# EAGLE design Tractive System Board Rev7 (EAGLE 9.6.2)

## Sheet 1 of 3
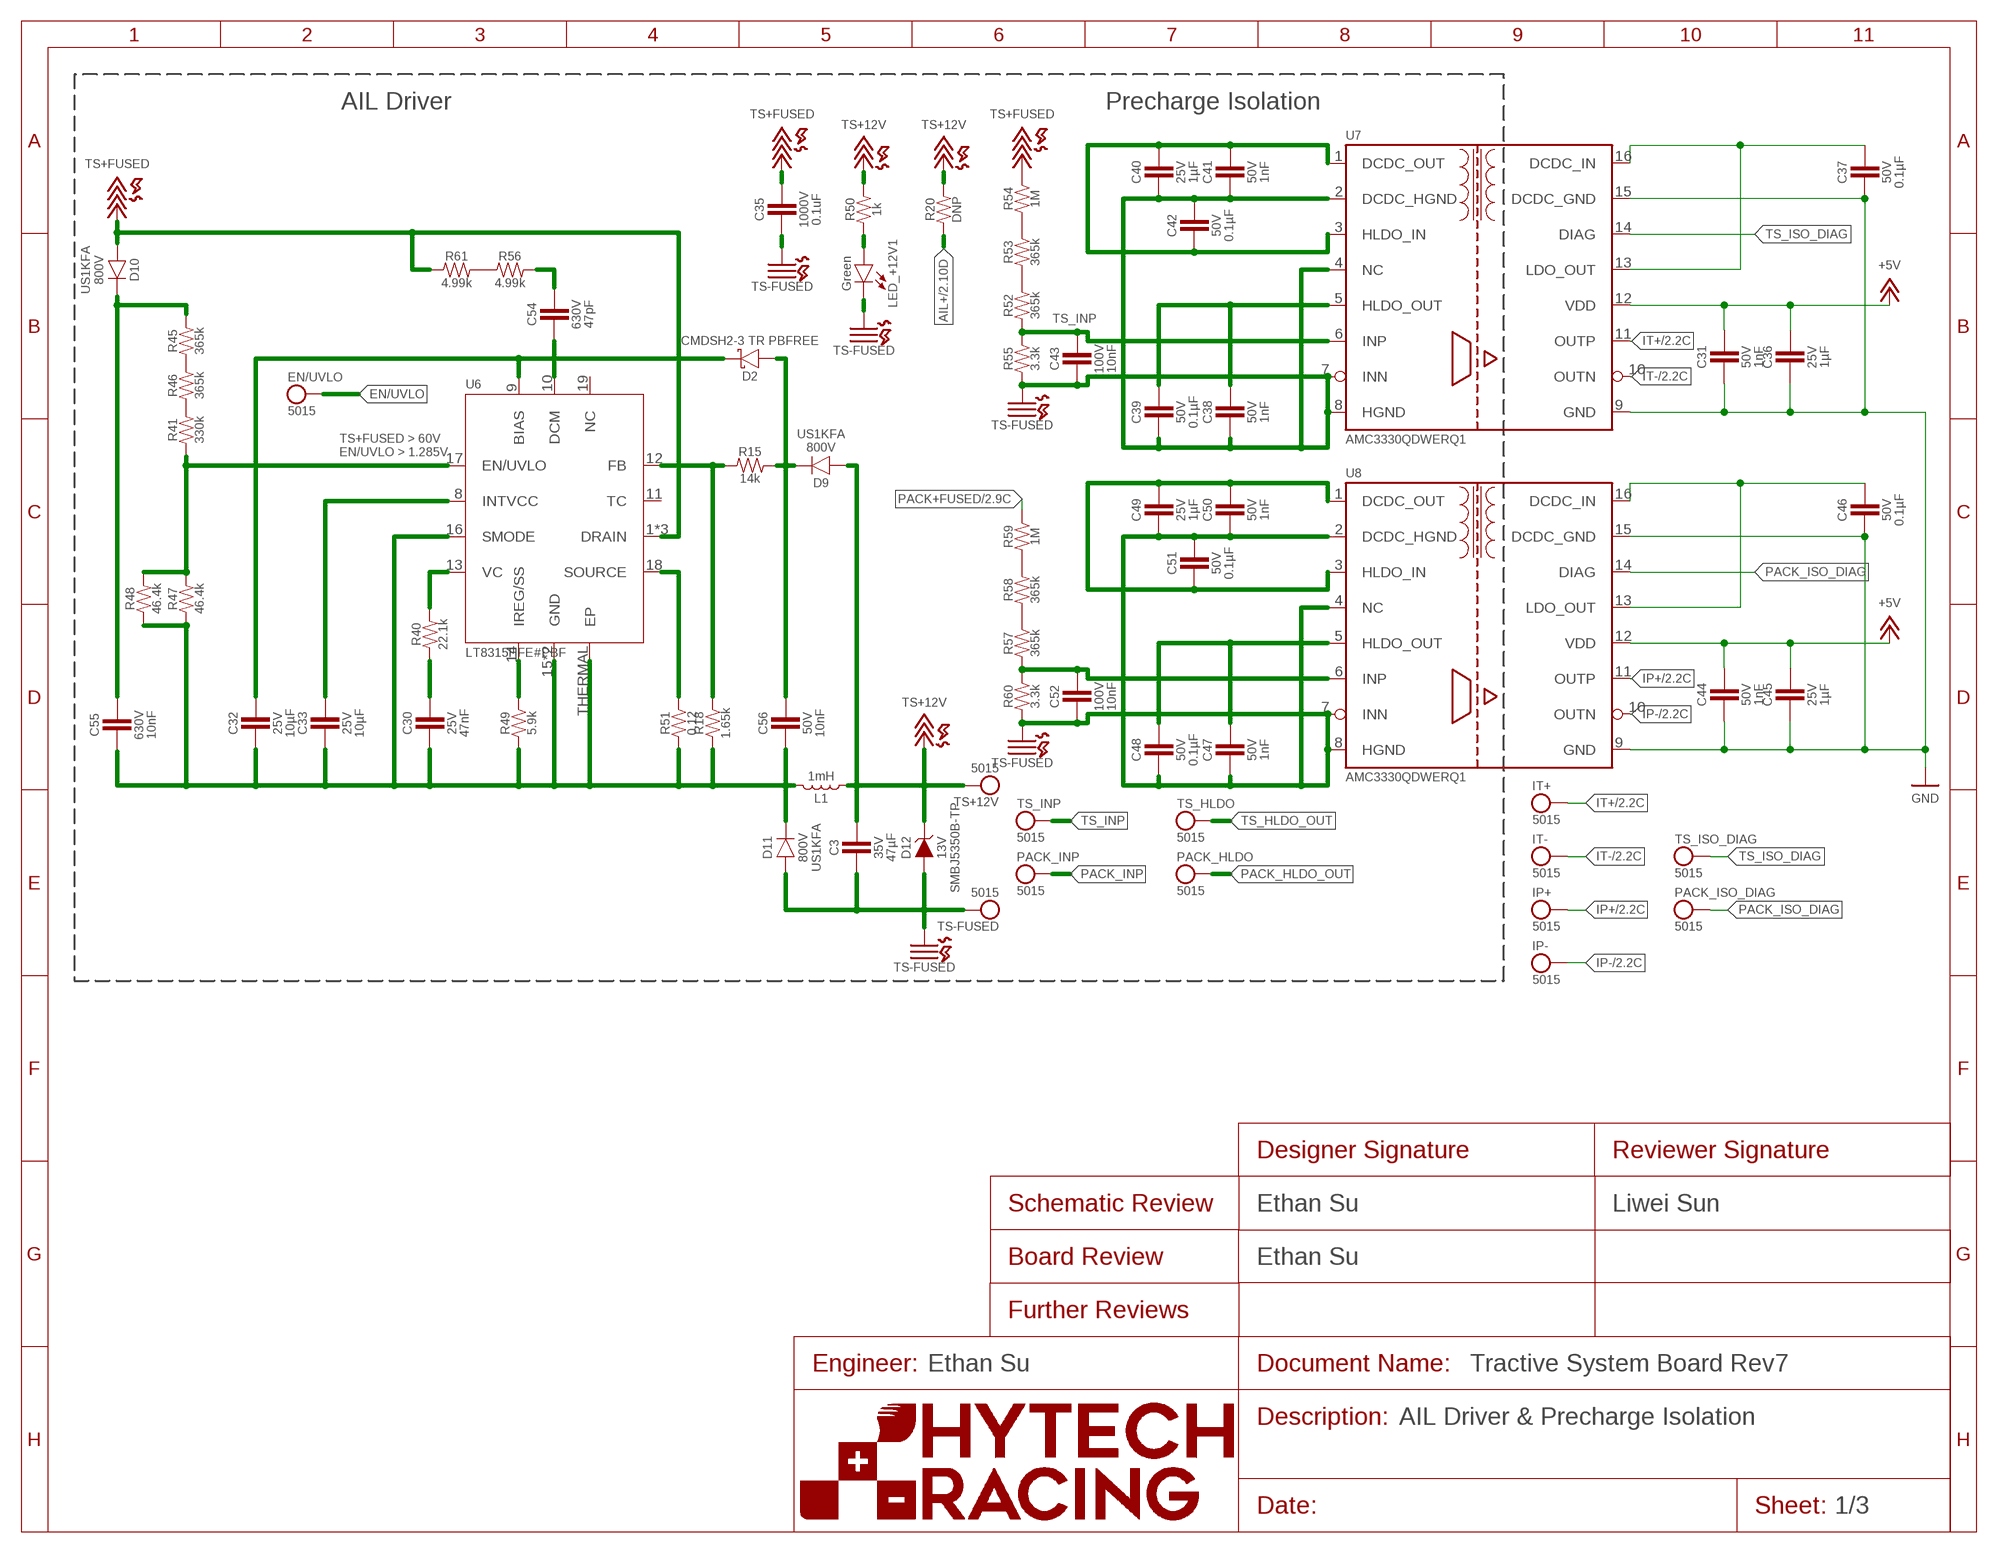
[diagram p0: schematic, sheet 1]
FRAME1 (FRAME): DESCRIPTION_1: AIL Driver & Precharge Isolation; DESIGNER_BOARD: Ethan Su; DESIGNER_SCHEMATIC: Ethan Su; ENGINEER: Ethan Su; REVIEWER_SCHEMATIC: Liwei Sun

### Parts
C3  CAPACITOR_2220_35V_47UF  [2220-CAP]
C30  CAPACITOR_0603_25V_47NF  [0603-CAP]
C31  CAPACITOR_1206_50V_1NF  [1206-CAP]
C32  CAPACITOR_0603_25V_10UF  [0603-CAP]
C33  CAPACITOR_0603_25V_10UF  [0603-CAP]
C35  CAPACITOR_1812_1000V_0.1UF  [1812-CAP]
C36  CAPACITOR_1206_25V_1UF  [1206-CAP]
C37  CAPACITOR_0603_50V_0.1UF  [0603-CAP]
C38  CAPACITOR_1206_50V_1NF  [1206-CAP]
C39  CAPACITOR_1206_50V_0.1UF  [1206-CAP]
C40  CAPACITOR_0603_25V_1UF  [0603-CAP]
C41  CAPACITOR_0603_50V_1NF  [0603-CAP]
C42  CAPACITOR_0603_50V_0.1UF  [0603-CAP]
C43  CAPACITOR_0603_100V_10NF  [0603-CAP]
C44  CAPACITOR_1206_50V_1NF  [1206-CAP]
C45  CAPACITOR_1206_25V_1UF  [1206-CAP]
C46  CAPACITOR_0603_50V_0.1UF  [0603-CAP]
C47  CAPACITOR_1206_50V_1NF  [1206-CAP]
C48  CAPACITOR_1206_50V_0.1UF  [1206-CAP]
C49  CAPACITOR_0603_25V_1UF  [0603-CAP]
C50  CAPACITOR_0603_50V_1NF  [0603-CAP]
C51  CAPACITOR_0603_50V_0.1UF  [0603-CAP]
C52  CAPACITOR_0603_100V_10NF  [0603-CAP]
C54  CAPACITOR_1206_630V_47PF  [1206-CAP]
C55  CAPACITOR_1206_630V_10NF  [1206-CAP]
C56  CAPACITOR_0603_50V_10NF  [0603-CAP]
D2  SCHOTTKY_SOD323_30VV  [SOD-323]
D9  RECTIFIER_800V_SOD-123FA  [SOD-123FA]
D10  RECTIFIER_800V_SOD-123FA  [SOD-123FA]
D11  RECTIFIER_800V_SOD-123FA  [SOD-123FA]
D12  ZENER_SMB(DO-214AA)_13V  [SMB(DO-214AA)]
EN/UVLO  TEST_POINT  [5015]
IP+  TEST_POINT  [5015]
IP-  TEST_POINT  [5015]
IT+  TEST_POINT  [5015]
IT-  TEST_POINT  [5015]
L1  INDUCTOR_SRR0745A_1MH  [SRR0745A-102M]
LED_+12V1  LED_0603_GREEN  [0603-LED]
PACK_HLDO  TEST_POINT  [5015]
PACK_INP  TEST_POINT  [5015]
PACK_ISO_DIAG  TEST_POINT  [5015]
R15  RESISTOR_0603_14K  [0603-RES]
R18  RESISTOR_0603_1.65K  [0603-RES]
R20  RESISTOR_0603_DNP  [0603-RES]
R40  RESISTOR_0603_22.1K  [0603-RES]
R41  RESISTOR_0805_HV330K  [0805-RES]
R45  RESISTOR_0805_HV365K  [0805-RES]
R46  RESISTOR_0805_HV365K  [0805-RES]
R47  RESISTOR_1206_HV46.4K  [1206-RES]
R48  RESISTOR_1206_HV46.4K  [1206-RES]
R49  RESISTOR_0603_5.9K  [0603-RES]
R50  RESISTOR_0603_1K  [0603-RES]
R51  RESISTOR_0603_0.12  [0603-RES]
R52  RESISTOR_0805_HV365K  [0805-RES]
R53  RESISTOR_0805_HV365K  [0805-RES]
R54  RESISTOR_0805_HV1M  [0805-RES]
R55  RESISTOR_0603_HV3.3K  [0603-RES]
R56  RESISTOR_1206_HV4.99K  [1206-RES]
R57  RESISTOR_0805_HV365K  [0805-RES]
R58  RESISTOR_0805_HV365K  [0805-RES]
R59  RESISTOR_0805_HV1M  [0805-RES]
R60  RESISTOR_0603_HV3.3K  [0603-RES]
R61  RESISTOR_1206_HV4.99K  [1206-RES]
TS+12V  TEST_POINT  [5015]
TS-FUSED  TEST_POINT  [5015]
TS_HLDO  TEST_POINT  [5015]
TS_INP  TEST_POINT  [5015]
TS_ISO_DIAG  TEST_POINT  [5015]
U6  LT8315  [TSSOP-20(16)]
U7  AMC3330_AIRGAP  [SOIC-16W-AIRGAP]
U8  AMC3330_AIRGAP  [SOIC-16W-AIRGAP]

### Nets
+5V: C31.1 C36.1 C44.1 C45.1 U7.12(VDD) U8.12(VDD) ; also sheet 2
AIL+: R20.1 ; also sheet 2
EN/UVLO: EN/UVLO.1 R41.1 R47.2 R48.2 U6.17(EN/UVLO)
GND: C31.2 C36.2 C37.2 C44.2 C45.2 C46.2 U7.9(GND) U7.15(DCDC_GND) U8.9(GND) U8.15(DCDC_GND) ; also sheet 2
IP+: IP+.1 U8.11(OUTP) ; also sheet 2
IP-: IP-.1 U8.10(OUTN) ; also sheet 2
IT+: IT+.1 U7.11(OUTP) ; also sheet 2
IT-: IT-.1 U7.10(OUTN) ; also sheet 2
N$33: C37.1 U7.13(LDO_OUT) U7.16(DCDC_IN)
N$34: R56.1 R61.2
N$35: C54.1 R56.2
N$36: R49.2 U6.14(IREG/SS)
N$37: R47.1 R48.1
N$38: C54.2 U6.10(DCM)
N$41: R40.2 U6.13(VC)
N$43: C30.1 R40.1
N$44: LED_+12V1.2(A) R50.1
N$45: C33.1 U6.8(INTVCC)
N$46: D10.C R45.2
N$47: R51.2 U6.18(SOURCE)
N$49: C32.1 D2.C U6.9(BIAS)
N$51: C40.1 C41.1 C42.2 U7.1(DCDC_OUT) U7.3(HLDO_IN)
N$52: C46.1 U8.13(LDO_OUT) U8.16(DCDC_IN)
N$54: R15.1 R18.2 U6.12(FB)
N$55: C56.1 D2.A D9.C R15.2
N$59: R52.2 R53.1
N$60: R53.2 R54.1
N$64: C49.1 C50.1 C51.2 U8.1(DCDC_OUT) U8.3(HLDO_IN)
N$65: R57.2 R58.1
N$66: R58.2 R59.1
PACK+FUSED: R59.2 ; also sheet 2
PACK_HLDO_OUT: C47.1 C48.1 PACK_HLDO.1 U8.5(HLDO_OUT)
PACK_INP: C52.1 PACK_INP.1 R57.1 R60.2 U8.6(INP)
PACK_ISO_DIAG: PACK_ISO_DIAG.1 U8.14(DIAG)
TS+12V: C3.1 D9.A D12.C L1.1 R20.2 R50.2 TS+12V.1
TS+FUSED: C35.1 D10.A R54.2 R61.1 U6.1(DRAIN) U6.2(DRAIN) U6.3(DRAIN) ; also sheet 2
TS-FUSED: C3.2 C35.2 C38.2 C39.2 C40.2 C41.2 C42.1 C43.2 C47.2 C48.2 C49.2 C50.2 C51.1 C52.2 D11.A D12.A LED_+12V1.1(C) R55.1 R60.1 TS-FUSED.1 U7.2(DCDC_HGND) U7.4(NC) U7.7(INN) U7.8(HGND) U8.2(DCDC_HGND) U8.4(NC) U8.7(INN) U8.8(HGND) ; also sheet 2
TS-FUSED1: C30.2 C32.2 C33.2 C55.2 C56.2 D11.C L1.2 R18.1 R49.1 R51.1 U6.15(GND) U6.16(SMODE) U6.20(GND) U6.THERMAL(EP)
TS_HLDO_OUT: C38.1 C39.1 TS_HLDO.1 U7.5(HLDO_OUT)
TS_INP: C43.1 R52.1 R55.2 TS_INP.1 U7.6(INP)
TS_ISO_DIAG: TS_ISO_DIAG.1 U7.14(DIAG)
Unconnected: C55.1 R41.2 R45.1 R46.1 R46.2 U6.11(TC) U6.19(NC)

### Notes on the sheet
- AIL Driver | Precharge Isolation
- TS+FUSED > 60V
  EN/UVLO > 1.285V

## Sheet 2 of 3
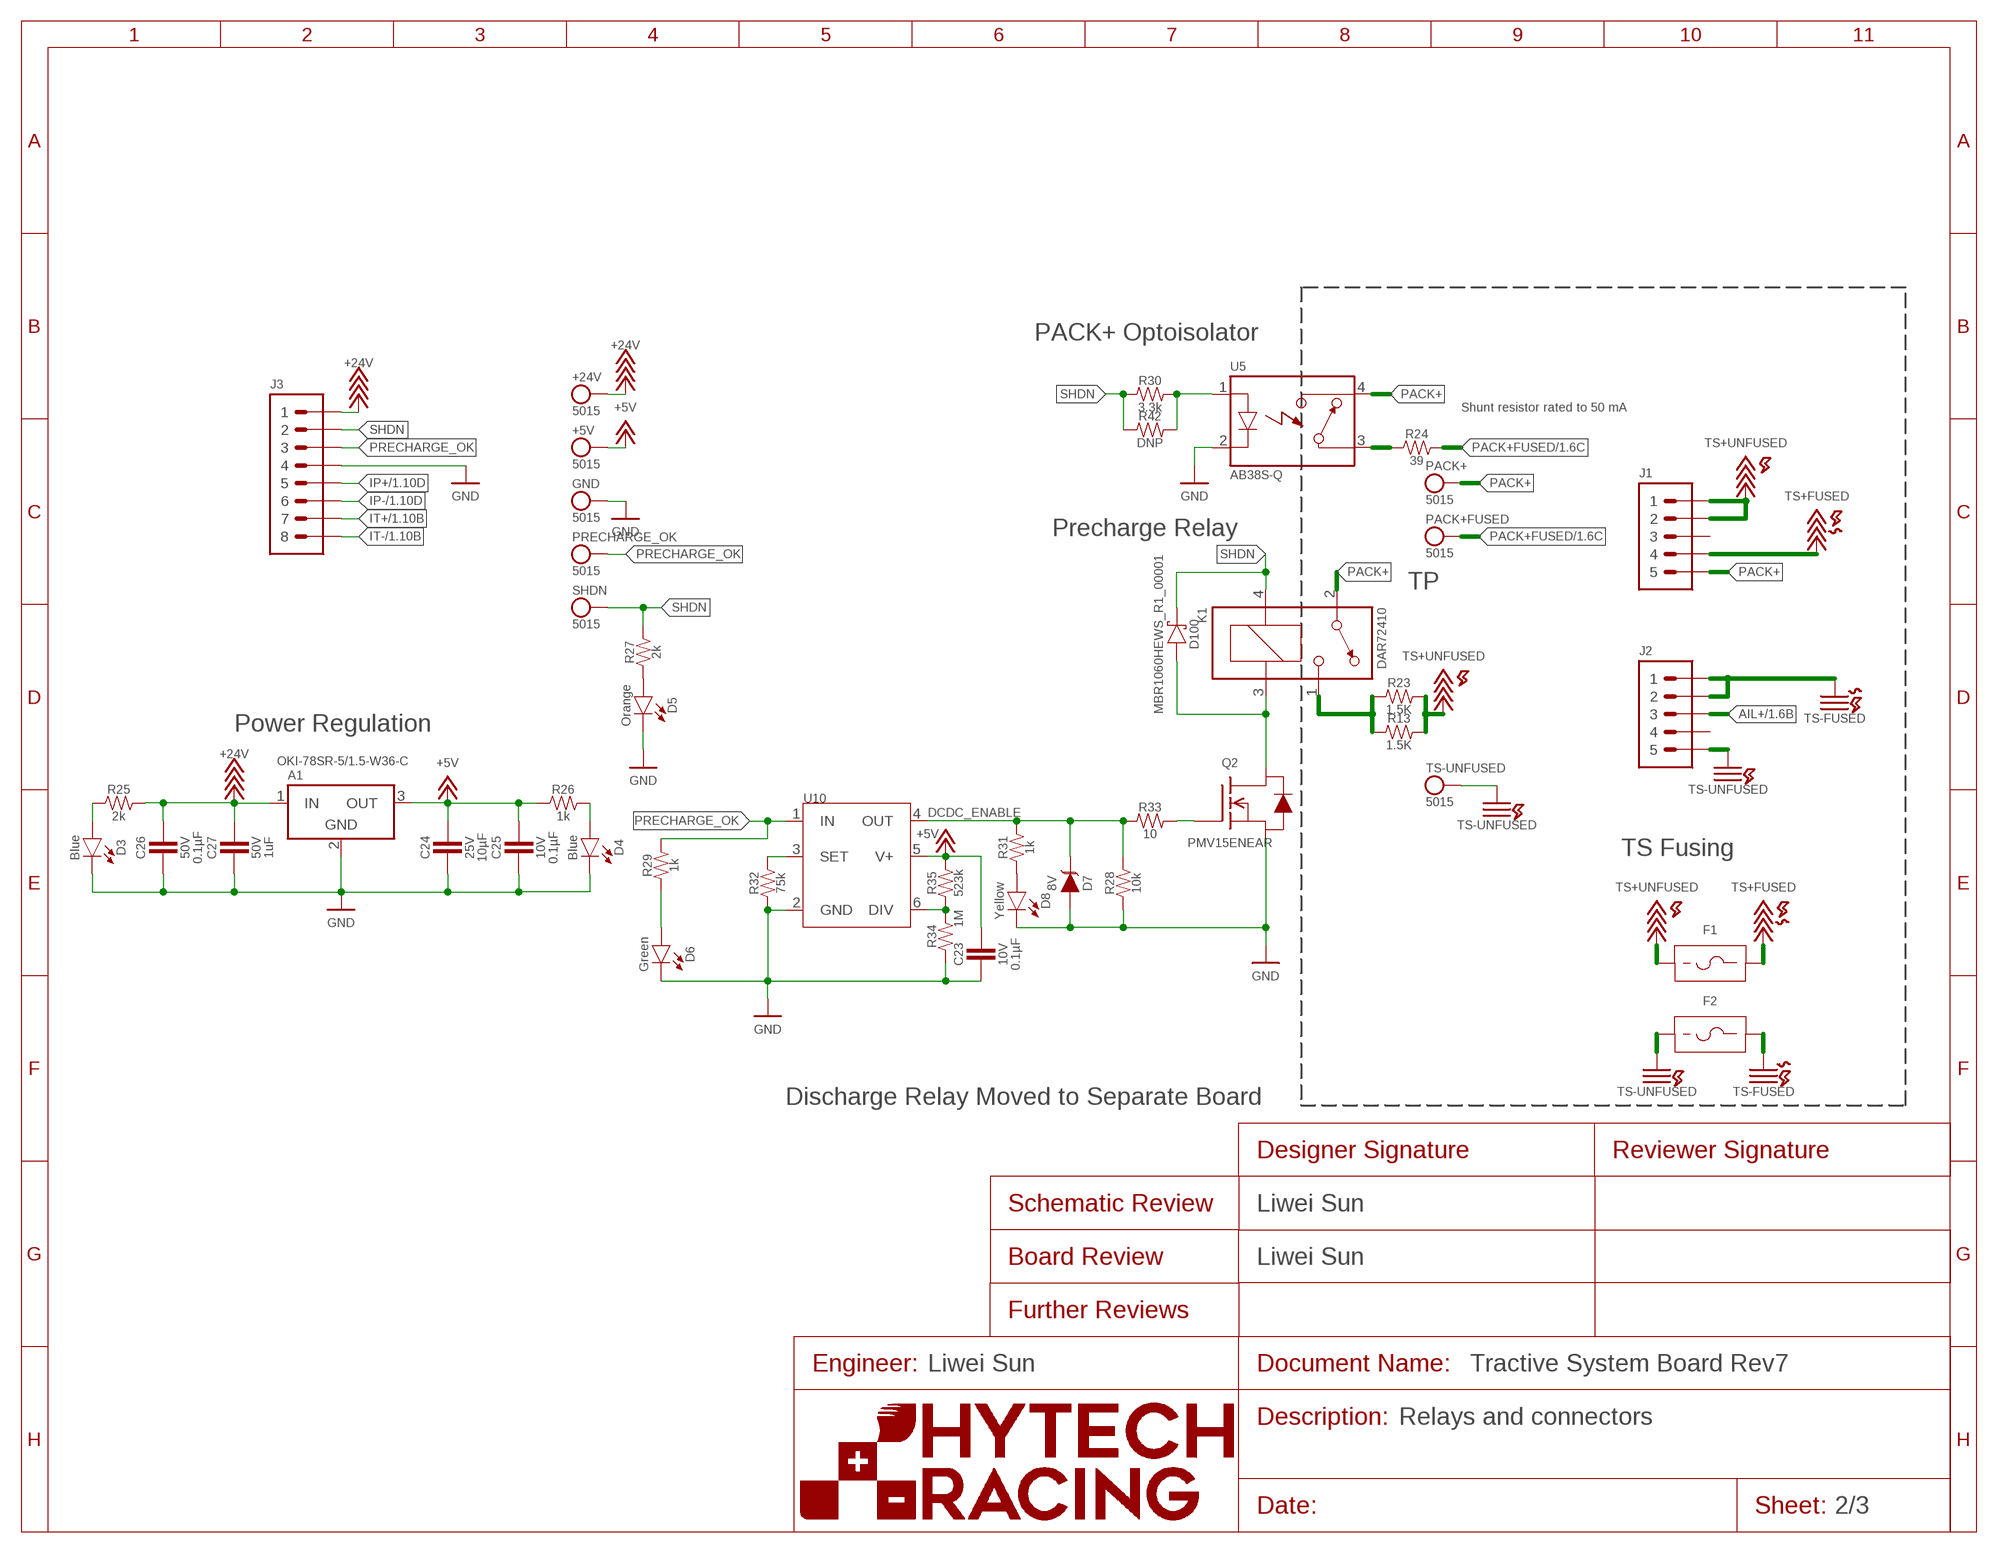
[diagram p1: schematic, sheet 2]
FRAME4 (FRAME): DESCRIPTION_1: Relays and connectors; DESIGNER_BOARD: Liwei Sun; DESIGNER_SCHEMATIC: Liwei Sun; ENGINEER: Liwei Sun

### Parts
+5V  TEST_POINT  [5015]
+24V  TEST_POINT  [5015]
A1  VOLTAGE_REGULATOR_MODULE_OKI-78SR_5V  [OKI-78SR]
C23  CAPACITOR_0603_10V_0.1UF  [0603-CAP]
C24  CAPACITOR_0603_25V_10UF  [0603-CAP]
C25  CAPACITOR_0603_10V_0.1UF  [0603-CAP]
C26  CAPACITOR_0603_50V_0.1UF  [0603-CAP]
C27  CAPACITOR_0603_50V_1UF  [0603-CAP]
D3  LED_0603_BLUE  [0603-LED]
D4  LED_0603_BLUE  [0603-LED]
D5  LED_0603_ORANGE  [0603-LED]
D6  LED_0603_GREEN  [0603-LED]
D7  TVS__8V  [SOT-23]
D8  LED_0603_YELLOW  [0603-LED]
D100  SCHOTTKY_SOD323_60V  [SOD-323]
F1  FUSE_HOLDER_122  [122]
F2  FUSE_HOLDER_122  [122]
GND  TEST_POINT  [5015]
J1  CONNECTOR-5_MICRO_V7S_  [MOLEX_MICROFIT_PTH_VERTICAL_07_SINGLE_SPACED]
J2  CONNECTOR-5_MICRO_V6S_  [MOLEX_MICROFIT_PTH_VERTICAL_06_SINGLE_SPACED]
J3  CONNECTOR-8_μF_T_V_BLACK  [MOLEX_MICROFIT_PTH_VERTICAL_08_DUAL]
K1  RELAY_SPST_NO_D_24  [D]
PACK+  TEST_POINT  [5015]
PACK+FUSED  TEST_POINT  [5015]
PRECHARGE_OK  TEST_POINT  [5015]
Q2  TRANSISTOR_N_MOS__PMV15ENEA  [SOT-23]
R13  RESISTOR_B20-SHORTENED_1.5K  [B20-SHORTENED]
R23  RESISTOR_B20-SHORTENED_1.5K  [B20-SHORTENED]
R24  RESISTOR_0603_39  [0603-RES]
R25  RESISTOR_0603_2K  [0603-RES]
R26  RESISTOR_0603_1K  [0603-RES]
R27  RESISTOR_0603_2K  [0603-RES]
R28  RESISTOR_0603_10K  [0603-RES]
R29  RESISTOR_0603_1K  [0603-RES]
R30  RESISTOR_0603_3.3K  [0603-RES]
R31  RESISTOR_0603_1K  [0603-RES]
R32  RESISTOR_0603_75K  [0603-RES]
R33  RESISTOR_0603_10  [0603-RES]
R34  RESISTOR_0805_1M  [0805-RES]
R35  RESISTOR_0805_523K  [0805-RES]
R42  RESISTOR_0603_DNP  [0603-RES]
SHDN  TEST_POINT  [5015]
TS-UNFUSED  TEST_POINT  [5015]
U5  RELAY_SOLIDSTATE_NO_AB38S-Q-AIRGAP  [SOP-04-AIRGAP]
U10  LTC6994-2  [SOT-23-6]

### Nets
+5V: +5V.1 A1.3(OUT) C23.1 C24.1 C25.1 R26.1 R35.2 U10.5(V+) ; also sheet 1
+24V: +24V.1 A1.1(IN) C26.1 C27.1 J3.1 R25.2
AIL+: J2.3 ; also sheet 1
DCDC_ENABLE: D7.3(C) R28.2 R31.2 R33.1 U10.4(OUT)
GND: A1.2(GND) C23.2 C24.2 C25.2 C26.2 C27.2 D3.1(C) D4.1(C) D5.1(C) D6.1(C) D7.1(A) D8.1(C) GND.1 J3.4 Q2.2(S) R28.1 R32.1 R34.1 U5.2(CONTROL-) U10.2(GND) ; also sheet 1
IP+: J3.5 ; also sheet 1
IP-: J3.6 ; also sheet 1
IT+: J3.7 ; also sheet 1
IT-: J3.8 ; also sheet 1
N$2: D5.2(A) R27.1
N$3: Q2.1(G) R33.2
N$10: R32.2 U10.3(SET)
N$11: R34.2 R35.1 U10.6(DIV)
N$22: D6.2(A) R29.1
N$24: D8.2(A) R31.1
N$25: D3.2(A) R25.1
N$30: D4.2(A) R26.2
N$40: D100.A K1.3(COIL-) Q2.3(D)
N$50: K1.1(CONTACT2) R13.1 R23.1
N$53: R30.2 R42.2 U5.1(CONTROL+)
N$57: R24.1 U5.3(CONTACT1)
PACK+: J1.5 K1.2(CONTACT1) PACK+.1 U5.4(CONTACT2)
PACK+FUSED: PACK+FUSED.1 R24.2 ; also sheet 1
PRECHARGE_OK: J3.3 PRECHARGE_OK.1 R29.2 U10.1(IN)
SHDN: D100.C J3.2 K1.4(COIL+) R27.2 R30.1 R42.1 SHDN.1
TS+FUSED: F1.3 F1.4 J1.4 ; also sheet 1
TS+UNFUSED: F1.1 F1.2 J1.1 J1.2 R13.2 R23.2
TS-FUSED: F2.3 F2.4 J2.1 J2.2 ; also sheet 1
TS-UNFUSED: F2.1 F2.2 J2.5 TS-UNFUSED.1
Unconnected: J1.3 J2.4

### Notes on the sheet
- PACK+ Optoisolator
- Shunt resistor rated to 50 mA
- Precharge Relay
- TP
- Power Regulation
- TS Fusing
- Discharge Relay Moved to Separate Board

## Sheet 3 of 3
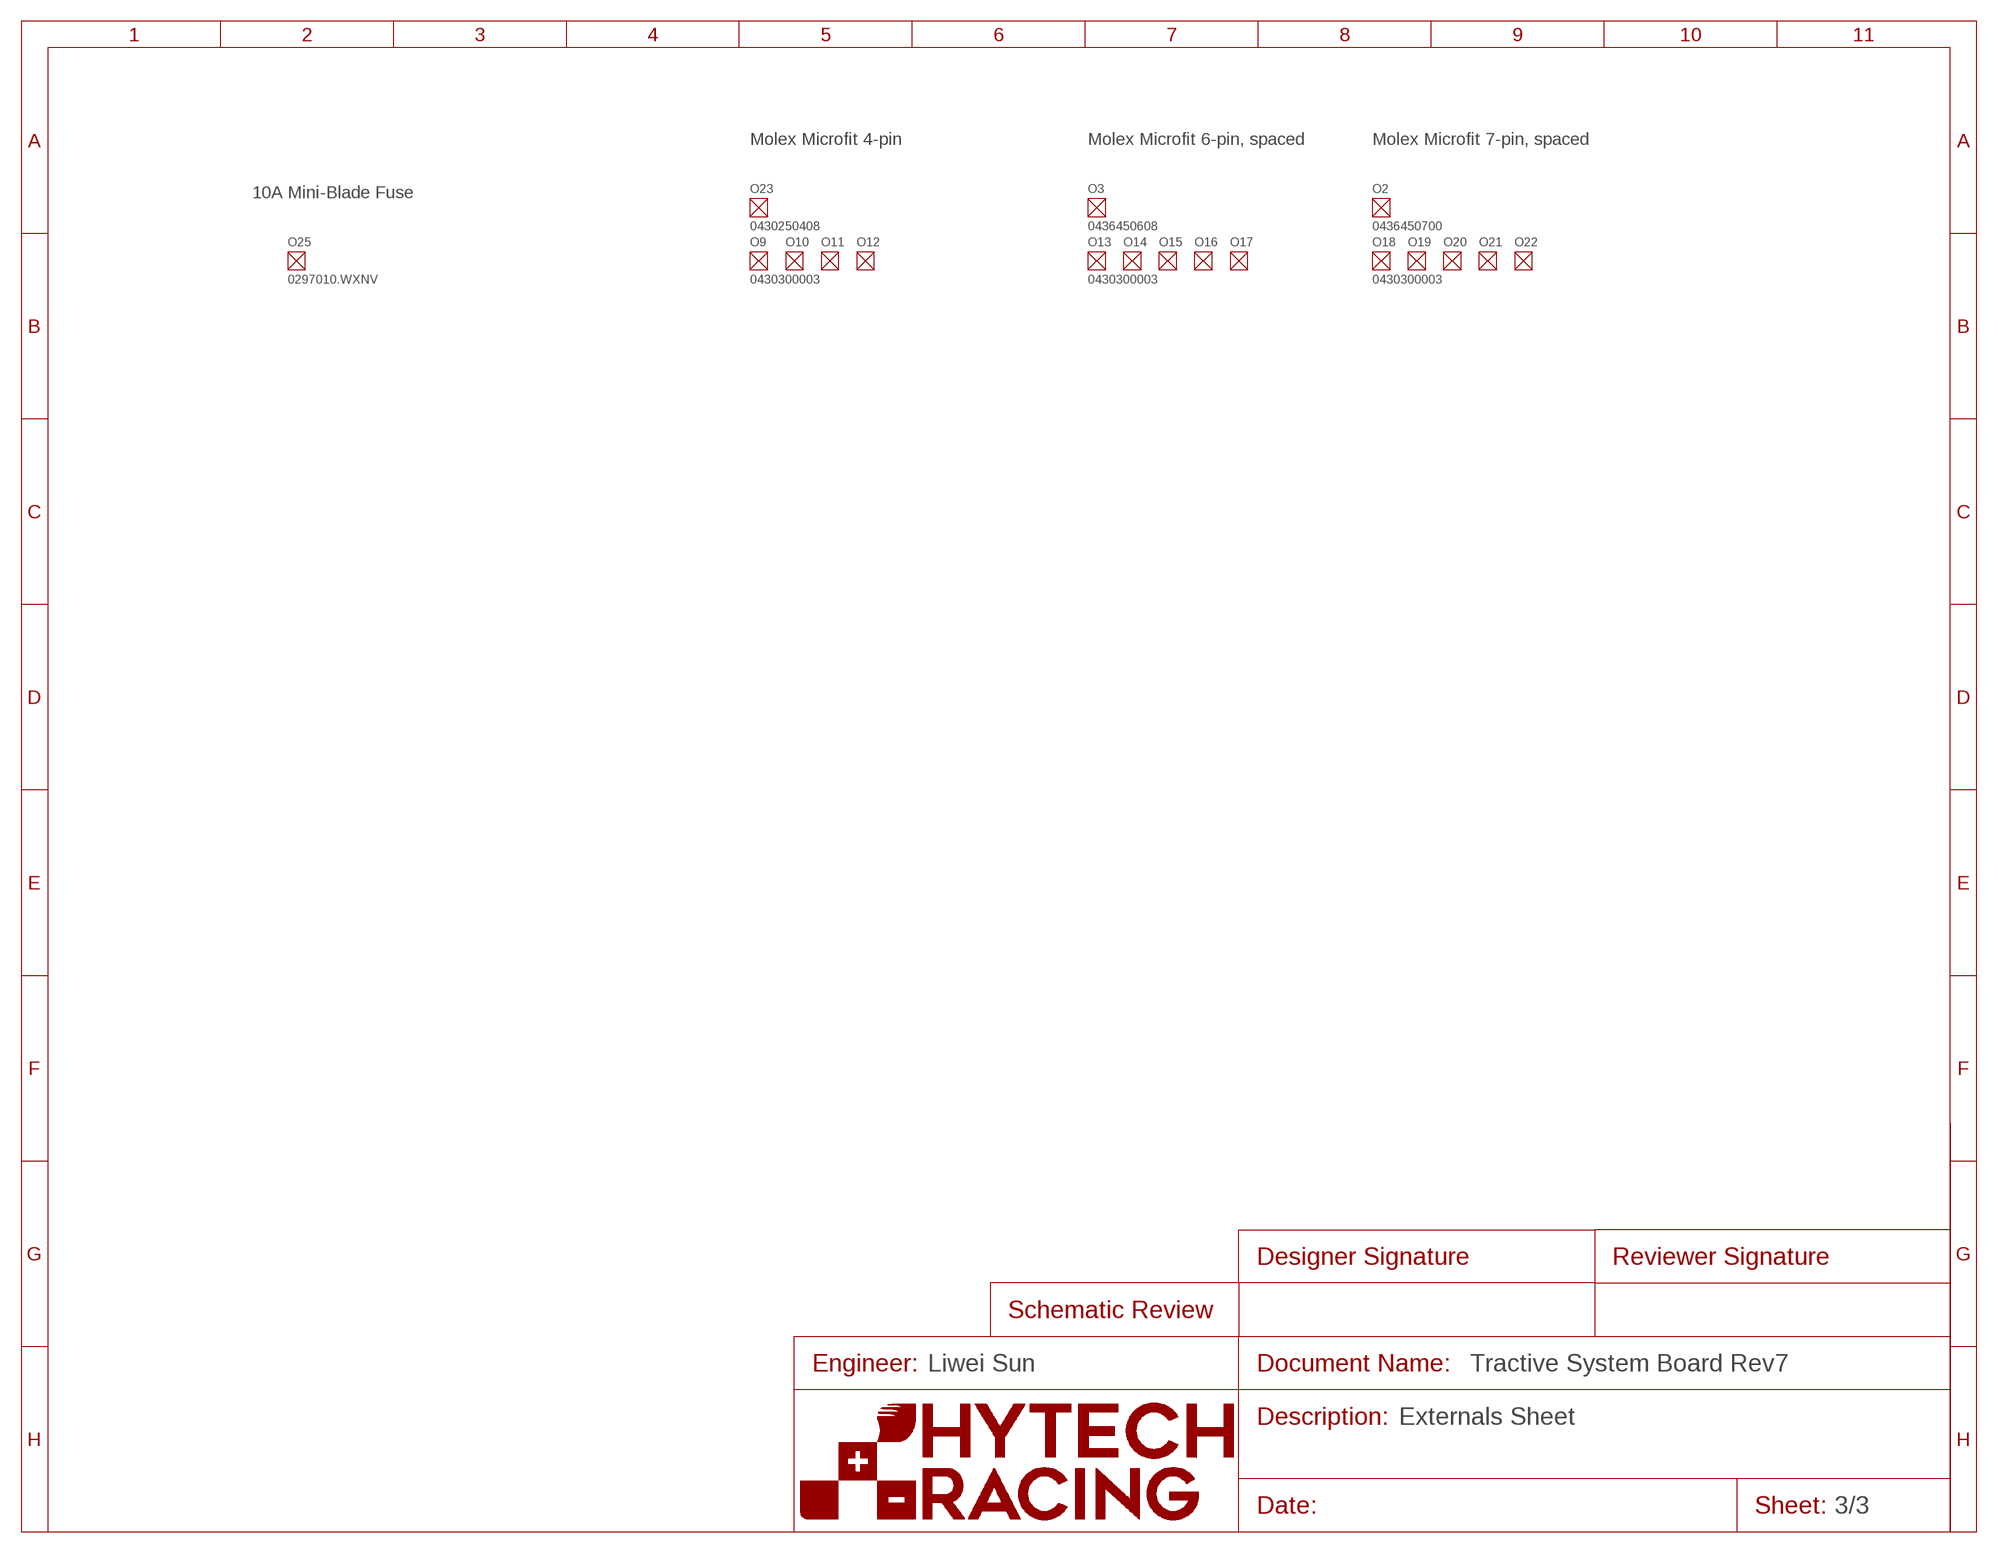
[diagram p2: schematic, sheet 3]
O2 (RECEPTACLE-7_MICROFIT): DKPN: WM2405-ND; MANUFACTURER: Molex; MOPN: 538-43645-0700; MPN: 0436450700
O3 (RECEPTACLE-6_SINGLE_MICROFIT): DKPN: WM13217-ND; MANUFACTURER: Molex; MOPN: 538-43645-0608; MPN: 0436450608
O9 (CRIMP_MICROFIT_20-24): DKPN: WM2776CT-ND; GAUGE: 20-24; MANUFACTURER: Molex; MOPN: 538-43030-0003; MPN: 0430300003
O10 (CRIMP_MICROFIT_20-24): DKPN: WM2776CT-ND; GAUGE: 20-24; MANUFACTURER: Molex; MOPN: 538-43030-0003; MPN: 0430300003
O11 (CRIMP_MICROFIT_20-24): DKPN: WM2776CT-ND; GAUGE: 20-24; MANUFACTURER: Molex; MOPN: 538-43030-0003; MPN: 0430300003
O12 (CRIMP_MICROFIT_20-24): DKPN: WM2776CT-ND; GAUGE: 20-24; MANUFACTURER: Molex; MOPN: 538-43030-0003; MPN: 0430300003
O13 (CRIMP_MICROFIT_20-24): DKPN: WM2776CT-ND; GAUGE: 20-24; MANUFACTURER: Molex; MOPN: 538-43030-0003; MPN: 0430300003
O14 (CRIMP_MICROFIT_20-24): DKPN: WM2776CT-ND; GAUGE: 20-24; MANUFACTURER: Molex; MOPN: 538-43030-0003; MPN: 0430300003
O15 (CRIMP_MICROFIT_20-24): DKPN: WM2776CT-ND; GAUGE: 20-24; MANUFACTURER: Molex; MOPN: 538-43030-0003; MPN: 0430300003
O16 (CRIMP_MICROFIT_20-24): DKPN: WM2776CT-ND; GAUGE: 20-24; MANUFACTURER: Molex; MOPN: 538-43030-0003; MPN: 0430300003
O17 (CRIMP_MICROFIT_20-24): DKPN: WM2776CT-ND; GAUGE: 20-24; MANUFACTURER: Molex; MOPN: 538-43030-0003; MPN: 0430300003
O18 (CRIMP_MICROFIT_20-24): DKPN: WM2776CT-ND; GAUGE: 20-24; MANUFACTURER: Molex; MOPN: 538-43030-0003; MPN: 0430300003
O19 (CRIMP_MICROFIT_20-24): DKPN: WM2776CT-ND; GAUGE: 20-24; MANUFACTURER: Molex; MOPN: 538-43030-0003; MPN: 0430300003
O20 (CRIMP_MICROFIT_20-24): DKPN: WM2776CT-ND; GAUGE: 20-24; MANUFACTURER: Molex; MOPN: 538-43030-0003; MPN: 0430300003
O21 (CRIMP_MICROFIT_20-24): DKPN: WM2776CT-ND; GAUGE: 20-24; MANUFACTURER: Molex; MOPN: 538-43030-0003; MPN: 0430300003
O22 (CRIMP_MICROFIT_20-24): DKPN: WM2776CT-ND; GAUGE: 20-24; MANUFACTURER: Molex; MOPN: 538-43030-0003; MPN: 0430300003
O23 (RECEPTACLE-4_MICROFIT): DKPN: WM11225-ND; MANUFACTURER: Molex; MOPN: 538-43025-0408; MPN: 0430250408
O25 (FUSE_MINI_BLADE_10): DKPN: F991-ND; MANUFACTURER: Littelfuse; MOPN: 576-0297010.WXNV; MPN: 0297010.WXNV
U$49 (FRAME_SCHEMATIC_ONLY): DESCRIPTION_1: Externals Sheet; ENGINEER: Liwei Sun

### Notes on the sheet
- Molex Microfit 4-pin | Molex Microfit 6-pin, spaced | Molex Microfit 7-pin, spaced
- 10A Mini-Blade Fuse

## Library data of the parts
+5V +24V EN/UVLO GND IP+ IP- IT+ IT- PACK+ PACK+FUSED PACK_HLDO PACK_INP PACK_ISO_DIAG PRECHARGE_OK SHDN TS+12V TS-FUSED TS-UNFUSED TS_HLDO TS_INP TS_ISO_DIAG = HyTechDevices:TEST_POINT: Test Point for Probing; DKPN: 36-5015CT-ND; MANUFACTURER: Keystone Electronics; MOPN: 534-5015; MPN: 5015
A1 = HyTechDevices:VOLTAGE_REGULATOR_MODULE_?_*: Voltage Regulator Modules OKI-78SR Datasheet <https://www.mouser.com/datasheet/2/281/oki-78sr-56393.pdf>; DKPN: 811-2196-5-ND; MANUFACTURER: Murata Power Solutions Inc.; MOPN: 580-OKI78SR5/1.5W36C; MPN: OKI-78SR-5/1.5-W36-C
C3 = HyTechDevices:CAPACITOR_?_*: Capacitor, Non-Polarized VJ...1BC Series Datasheet <https://www.mouser.com/datasheet/2/427/vjw1bcbascomseries-1762447.pdf> Samsung Datasheet <https://www.mouser.com/datasheet/2/585/MLCC-1837944.pdf> Samsung Automotive MLCC Datasheet <https://www.mouser.com/datasheet/2/585/MLCC_Automotive-1837966.pdf> Walsin Datasheet <https://www.mouser.com/datasheet/2/210/WTC_MLCC_General_Purpose-1534899.pdf> GRM188R61A226ME15D <https://www.mouser.com/datasheet/2/281/1/GRM188R61A226ME15_02A-1985787.pdf> GRM188R61E106MA73D <https://www.mouser.com/datasheet/2/281/1/GRM188R61E106MA73_01A-1985806.pdf> 885012006013 <https://www.mouser.com/datasheet/2/445/885012006013-1726946.pdf> 2220Y6300105KXTWS2 <https://www.mouser.com/datasheet/2/218/SMD_High_and_Std_StackiCap_P62-1825512.pdf> Yageo Class 2, X5R <https://www.mouser.com/datasheet/2/447/UPY_GPHC_X5R_4V_to_50V_26-1827097.pdf> TDK C Series <https://www.mouser.com/ProductDetail/TDK/C3216X5R1V226M160AC?qs=%2Fha2pyFadujbcx9jh7lYl%2F4NeMoXFhdc8AqVWNq4wW6M2y7zl6GzBuhgtI0ngznN> AVX Automotive MLCC <https://www.mouser.com/datasheet/2/40/AutoMLCC-777028.pdf> KEMET X7R Series <https://www.mouser.com/datasheet/2/212/KEM_C1002_X7R_SMD-1102033.pdf> Kyocera AVX <https://www.mouser.com/datasheet/2/40/C0GNP0_Dielectric-951274.pdf> GRM21BR61H <https://www.mouser.com/datasheet/2/281/1/GRM21BR61H106KE43_01A-1986884.pdf> C1812W104KDRACTU <https://www.mouser.com/datasheet/2/212/KEM_C1034_X7R_HV_ARC_SMD-1101730.pdf> CGA series - MLCC Automotive grade <https://product.tdk.com/system/files/dam/doc/product/capacitor/ceramic/mlcc/catalog/mlcc_automotive_general_en.pdf>; CAPACITANCE: 47µF; DKPN: 445-CGA9N1X7R1V476M230KCCT-ND; MANUFACTURER: TDK Corporation; MOPN: 810-CGA9N1X7R1V476M2; MPN: CGA9N1X7R1V476M230KC; TOLERANCE: 20%; VOLTAGE: 35V
C23 C25 = HyTechDevices:CAPACITOR_?_*: Capacitor, Non-Polarized VJ...1BC Series Datasheet <https://www.mouser.com/datasheet/2/427/vjw1bcbascomseries-1762447.pdf> Samsung Datasheet <https://www.mouser.com/datasheet/2/585/MLCC-1837944.pdf> Samsung Automotive MLCC Datasheet <https://www.mouser.com/datasheet/2/585/MLCC_Automotive-1837966.pdf> Walsin Datasheet <https://www.mouser.com/datasheet/2/210/WTC_MLCC_General_Purpose-1534899.pdf> GRM188R61A226ME15D <https://www.mouser.com/datasheet/2/281/1/GRM188R61A226ME15_02A-1985787.pdf> GRM188R61E106MA73D <https://www.mouser.com/datasheet/2/281/1/GRM188R61E106MA73_01A-1985806.pdf> 885012006013 <https://www.mouser.com/datasheet/2/445/885012006013-1726946.pdf> 2220Y6300105KXTWS2 <https://www.mouser.com/datasheet/2/218/SMD_High_and_Std_StackiCap_P62-1825512.pdf> Yageo Class 2, X5R <https://www.mouser.com/datasheet/2/447/UPY_GPHC_X5R_4V_to_50V_26-1827097.pdf> TDK C Series <https://www.mouser.com/ProductDetail/TDK/C3216X5R1V226M160AC?qs=%2Fha2pyFadujbcx9jh7lYl%2F4NeMoXFhdc8AqVWNq4wW6M2y7zl6GzBuhgtI0ngznN> AVX Automotive MLCC <https://www.mouser.com/datasheet/2/40/AutoMLCC-777028.pdf> KEMET X7R Series <https://www.mouser.com/datasheet/2/212/KEM_C1002_X7R_SMD-1102033.pdf> Kyocera AVX <https://www.mouser.com/datasheet/2/40/C0GNP0_Dielectric-951274.pdf> GRM21BR61H <https://www.mouser.com/datasheet/2/281/1/GRM21BR61H106KE43_01A-1986884.pdf> C1812W104KDRACTU <https://www.mouser.com/datasheet/2/212/KEM_C1034_X7R_HV_ARC_SMD-1101730.pdf> CGA series - MLCC Automotive grade <https://product.tdk.com/system/files/dam/doc/product/capacitor/ceramic/mlcc/catalog/mlcc_automotive_general_en.pdf>; CAPACITANCE: 0.1µF; DKPN: 720-1688-1-ND; MANUFACTURER: Vishay Vitramon; MOPN: 77-VJ0603Y104JXQPBC; MPN: VJ0603Y104JXQPW1BC; TOLERANCE: 5%; VOLTAGE: 10V
C24 C32 C33 = HyTechDevices:CAPACITOR_?_*: Capacitor, Non-Polarized VJ...1BC Series Datasheet <https://www.mouser.com/datasheet/2/427/vjw1bcbascomseries-1762447.pdf> Samsung Datasheet <https://www.mouser.com/datasheet/2/585/MLCC-1837944.pdf> Samsung Automotive MLCC Datasheet <https://www.mouser.com/datasheet/2/585/MLCC_Automotive-1837966.pdf> Walsin Datasheet <https://www.mouser.com/datasheet/2/210/WTC_MLCC_General_Purpose-1534899.pdf> GRM188R61A226ME15D <https://www.mouser.com/datasheet/2/281/1/GRM188R61A226ME15_02A-1985787.pdf> GRM188R61E106MA73D <https://www.mouser.com/datasheet/2/281/1/GRM188R61E106MA73_01A-1985806.pdf> 885012006013 <https://www.mouser.com/datasheet/2/445/885012006013-1726946.pdf> 2220Y6300105KXTWS2 <https://www.mouser.com/datasheet/2/218/SMD_High_and_Std_StackiCap_P62-1825512.pdf> Yageo Class 2, X5R <https://www.mouser.com/datasheet/2/447/UPY_GPHC_X5R_4V_to_50V_26-1827097.pdf> TDK C Series <https://www.mouser.com/ProductDetail/TDK/C3216X5R1V226M160AC?qs=%2Fha2pyFadujbcx9jh7lYl%2F4NeMoXFhdc8AqVWNq4wW6M2y7zl6GzBuhgtI0ngznN> AVX Automotive MLCC <https://www.mouser.com/datasheet/2/40/AutoMLCC-777028.pdf> KEMET X7R Series <https://www.mouser.com/datasheet/2/212/KEM_C1002_X7R_SMD-1102033.pdf> Kyocera AVX <https://www.mouser.com/datasheet/2/40/C0GNP0_Dielectric-951274.pdf> GRM21BR61H <https://www.mouser.com/datasheet/2/281/1/GRM21BR61H106KE43_01A-1986884.pdf> C1812W104KDRACTU <https://www.mouser.com/datasheet/2/212/KEM_C1034_X7R_HV_ARC_SMD-1101730.pdf> CGA series - MLCC Automotive grade <https://product.tdk.com/system/files/dam/doc/product/capacitor/ceramic/mlcc/catalog/mlcc_automotive_general_en.pdf>; CAPACITANCE: 10µF; DKPN: 490-7202-1-ND; MANUFACTURER: Murata Electronics; MOPN: 81-GRM188R61E106MA3D; MPN: GRM188R61E106MA73D; TOLERANCE: 20%; VOLTAGE: 25V
C26 C37 C42 C46 C51 = HyTechDevices:CAPACITOR_?_*: Capacitor, Non-Polarized VJ...1BC Series Datasheet <https://www.mouser.com/datasheet/2/427/vjw1bcbascomseries-1762447.pdf> Samsung Datasheet <https://www.mouser.com/datasheet/2/585/MLCC-1837944.pdf> Samsung Automotive MLCC Datasheet <https://www.mouser.com/datasheet/2/585/MLCC_Automotive-1837966.pdf> Walsin Datasheet <https://www.mouser.com/datasheet/2/210/WTC_MLCC_General_Purpose-1534899.pdf> GRM188R61A226ME15D <https://www.mouser.com/datasheet/2/281/1/GRM188R61A226ME15_02A-1985787.pdf> GRM188R61E106MA73D <https://www.mouser.com/datasheet/2/281/1/GRM188R61E106MA73_01A-1985806.pdf> 885012006013 <https://www.mouser.com/datasheet/2/445/885012006013-1726946.pdf> 2220Y6300105KXTWS2 <https://www.mouser.com/datasheet/2/218/SMD_High_and_Std_StackiCap_P62-1825512.pdf> Yageo Class 2, X5R <https://www.mouser.com/datasheet/2/447/UPY_GPHC_X5R_4V_to_50V_26-1827097.pdf> TDK C Series <https://www.mouser.com/ProductDetail/TDK/C3216X5R1V226M160AC?qs=%2Fha2pyFadujbcx9jh7lYl%2F4NeMoXFhdc8AqVWNq4wW6M2y7zl6GzBuhgtI0ngznN> AVX Automotive MLCC <https://www.mouser.com/datasheet/2/40/AutoMLCC-777028.pdf> KEMET X7R Series <https://www.mouser.com/datasheet/2/212/KEM_C1002_X7R_SMD-1102033.pdf> Kyocera AVX <https://www.mouser.com/datasheet/2/40/C0GNP0_Dielectric-951274.pdf> GRM21BR61H <https://www.mouser.com/datasheet/2/281/1/GRM21BR61H106KE43_01A-1986884.pdf> C1812W104KDRACTU <https://www.mouser.com/datasheet/2/212/KEM_C1034_X7R_HV_ARC_SMD-1101730.pdf> CGA series - MLCC Automotive grade <https://product.tdk.com/system/files/dam/doc/product/capacitor/ceramic/mlcc/catalog/mlcc_automotive_general_en.pdf>; CAPACITANCE: 0.1µF; DKPN: 311-1344-1-ND; MANUFACTURER: Yageo; MOPN: 603-CC603KRX7R9BB104; MPN: CC0603KRX7R9BB104; TOLERANCE: 10%; VOLTAGE: 50V
C27 = HyTechDevices:CAPACITOR_?_*: Capacitor, Non-Polarized VJ...1BC Series Datasheet <https://www.mouser.com/datasheet/2/427/vjw1bcbascomseries-1762447.pdf> Samsung Datasheet <https://www.mouser.com/datasheet/2/585/MLCC-1837944.pdf> Samsung Automotive MLCC Datasheet <https://www.mouser.com/datasheet/2/585/MLCC_Automotive-1837966.pdf> Walsin Datasheet <https://www.mouser.com/datasheet/2/210/WTC_MLCC_General_Purpose-1534899.pdf> GRM188R61A226ME15D <https://www.mouser.com/datasheet/2/281/1/GRM188R61A226ME15_02A-1985787.pdf> GRM188R61E106MA73D <https://www.mouser.com/datasheet/2/281/1/GRM188R61E106MA73_01A-1985806.pdf> 885012006013 <https://www.mouser.com/datasheet/2/445/885012006013-1726946.pdf> 2220Y6300105KXTWS2 <https://www.mouser.com/datasheet/2/218/SMD_High_and_Std_StackiCap_P62-1825512.pdf> Yageo Class 2, X5R <https://www.mouser.com/datasheet/2/447/UPY_GPHC_X5R_4V_to_50V_26-1827097.pdf> TDK C Series <https://www.mouser.com/ProductDetail/TDK/C3216X5R1V226M160AC?qs=%2Fha2pyFadujbcx9jh7lYl%2F4NeMoXFhdc8AqVWNq4wW6M2y7zl6GzBuhgtI0ngznN> AVX Automotive MLCC <https://www.mouser.com/datasheet/2/40/AutoMLCC-777028.pdf> KEMET X7R Series <https://www.mouser.com/datasheet/2/212/KEM_C1002_X7R_SMD-1102033.pdf> Kyocera AVX <https://www.mouser.com/datasheet/2/40/C0GNP0_Dielectric-951274.pdf> GRM21BR61H <https://www.mouser.com/datasheet/2/281/1/GRM21BR61H106KE43_01A-1986884.pdf> C1812W104KDRACTU <https://www.mouser.com/datasheet/2/212/KEM_C1034_X7R_HV_ARC_SMD-1101730.pdf> CGA series - MLCC Automotive grade <https://product.tdk.com/system/files/dam/doc/product/capacitor/ceramic/mlcc/catalog/mlcc_automotive_general_en.pdf>; CAPACITANCE: 1uF; DKPN: 587-2400-2-ND; MANUFACTURER: Taiyo Yuden; MOPN: 963-UMK107BJ105KA-T; MPN: UMK107BJ105KA-T; TOLERANCE: 10%; VOLTAGE: 50V
C30 = HyTechDevices:CAPACITOR_?_*: Capacitor, Non-Polarized VJ...1BC Series Datasheet <https://www.mouser.com/datasheet/2/427/vjw1bcbascomseries-1762447.pdf> Samsung Datasheet <https://www.mouser.com/datasheet/2/585/MLCC-1837944.pdf> Samsung Automotive MLCC Datasheet <https://www.mouser.com/datasheet/2/585/MLCC_Automotive-1837966.pdf> Walsin Datasheet <https://www.mouser.com/datasheet/2/210/WTC_MLCC_General_Purpose-1534899.pdf> GRM188R61A226ME15D <https://www.mouser.com/datasheet/2/281/1/GRM188R61A226ME15_02A-1985787.pdf> GRM188R61E106MA73D <https://www.mouser.com/datasheet/2/281/1/GRM188R61E106MA73_01A-1985806.pdf> 885012006013 <https://www.mouser.com/datasheet/2/445/885012006013-1726946.pdf> 2220Y6300105KXTWS2 <https://www.mouser.com/datasheet/2/218/SMD_High_and_Std_StackiCap_P62-1825512.pdf> Yageo Class 2, X5R <https://www.mouser.com/datasheet/2/447/UPY_GPHC_X5R_4V_to_50V_26-1827097.pdf> TDK C Series <https://www.mouser.com/ProductDetail/TDK/C3216X5R1V226M160AC?qs=%2Fha2pyFadujbcx9jh7lYl%2F4NeMoXFhdc8AqVWNq4wW6M2y7zl6GzBuhgtI0ngznN> AVX Automotive MLCC <https://www.mouser.com/datasheet/2/40/AutoMLCC-777028.pdf> KEMET X7R Series <https://www.mouser.com/datasheet/2/212/KEM_C1002_X7R_SMD-1102033.pdf> Kyocera AVX <https://www.mouser.com/datasheet/2/40/C0GNP0_Dielectric-951274.pdf> GRM21BR61H <https://www.mouser.com/datasheet/2/281/1/GRM21BR61H106KE43_01A-1986884.pdf> C1812W104KDRACTU <https://www.mouser.com/datasheet/2/212/KEM_C1034_X7R_HV_ARC_SMD-1101730.pdf> CGA series - MLCC Automotive grade <https://product.tdk.com/system/files/dam/doc/product/capacitor/ceramic/mlcc/catalog/mlcc_automotive_general_en.pdf>; CAPACITANCE: 47nF; DKPN: 478-6340-1-ND; MANUFACTURER: Kyocera AVX; MOPN: 581-06033C473K42ZA; MPN: 06033C473K4Z2A; TOLERANCE: 10%; VOLTAGE: 25V
C31 C38 C44 C47 = HyTechDevices:CAPACITOR_?_*: Capacitor, Non-Polarized VJ...1BC Series Datasheet <https://www.mouser.com/datasheet/2/427/vjw1bcbascomseries-1762447.pdf> Samsung Datasheet <https://www.mouser.com/datasheet/2/585/MLCC-1837944.pdf> Samsung Automotive MLCC Datasheet <https://www.mouser.com/datasheet/2/585/MLCC_Automotive-1837966.pdf> Walsin Datasheet <https://www.mouser.com/datasheet/2/210/WTC_MLCC_General_Purpose-1534899.pdf> GRM188R61A226ME15D <https://www.mouser.com/datasheet/2/281/1/GRM188R61A226ME15_02A-1985787.pdf> GRM188R61E106MA73D <https://www.mouser.com/datasheet/2/281/1/GRM188R61E106MA73_01A-1985806.pdf> 885012006013 <https://www.mouser.com/datasheet/2/445/885012006013-1726946.pdf> 2220Y6300105KXTWS2 <https://www.mouser.com/datasheet/2/218/SMD_High_and_Std_StackiCap_P62-1825512.pdf> Yageo Class 2, X5R <https://www.mouser.com/datasheet/2/447/UPY_GPHC_X5R_4V_to_50V_26-1827097.pdf> TDK C Series <https://www.mouser.com/ProductDetail/TDK/C3216X5R1V226M160AC?qs=%2Fha2pyFadujbcx9jh7lYl%2F4NeMoXFhdc8AqVWNq4wW6M2y7zl6GzBuhgtI0ngznN> AVX Automotive MLCC <https://www.mouser.com/datasheet/2/40/AutoMLCC-777028.pdf> KEMET X7R Series <https://www.mouser.com/datasheet/2/212/KEM_C1002_X7R_SMD-1102033.pdf> Kyocera AVX <https://www.mouser.com/datasheet/2/40/C0GNP0_Dielectric-951274.pdf> GRM21BR61H <https://www.mouser.com/datasheet/2/281/1/GRM21BR61H106KE43_01A-1986884.pdf> C1812W104KDRACTU <https://www.mouser.com/datasheet/2/212/KEM_C1034_X7R_HV_ARC_SMD-1101730.pdf> CGA series - MLCC Automotive grade <https://product.tdk.com/system/files/dam/doc/product/capacitor/ceramic/mlcc/catalog/mlcc_automotive_general_en.pdf>; CAPACITANCE: 1nF; DKPN: 478-KGM31BR71H102KTCT-ND; MANUFACTURER: KYOCERA AVX; MOPN: 581-12065C102K; MPN: KGM31BR71H102KT; TOLERANCE: 10%; VOLTAGE: 50V
C35 = HyTechDevices:CAPACITOR_?_*: Capacitor, Non-Polarized VJ...1BC Series Datasheet <https://www.mouser.com/datasheet/2/427/vjw1bcbascomseries-1762447.pdf> Samsung Datasheet <https://www.mouser.com/datasheet/2/585/MLCC-1837944.pdf> Samsung Automotive MLCC Datasheet <https://www.mouser.com/datasheet/2/585/MLCC_Automotive-1837966.pdf> Walsin Datasheet <https://www.mouser.com/datasheet/2/210/WTC_MLCC_General_Purpose-1534899.pdf> GRM188R61A226ME15D <https://www.mouser.com/datasheet/2/281/1/GRM188R61A226ME15_02A-1985787.pdf> GRM188R61E106MA73D <https://www.mouser.com/datasheet/2/281/1/GRM188R61E106MA73_01A-1985806.pdf> 885012006013 <https://www.mouser.com/datasheet/2/445/885012006013-1726946.pdf> 2220Y6300105KXTWS2 <https://www.mouser.com/datasheet/2/218/SMD_High_and_Std_StackiCap_P62-1825512.pdf> Yageo Class 2, X5R <https://www.mouser.com/datasheet/2/447/UPY_GPHC_X5R_4V_to_50V_26-1827097.pdf> TDK C Series <https://www.mouser.com/ProductDetail/TDK/C3216X5R1V226M160AC?qs=%2Fha2pyFadujbcx9jh7lYl%2F4NeMoXFhdc8AqVWNq4wW6M2y7zl6GzBuhgtI0ngznN> AVX Automotive MLCC <https://www.mouser.com/datasheet/2/40/AutoMLCC-777028.pdf> KEMET X7R Series <https://www.mouser.com/datasheet/2/212/KEM_C1002_X7R_SMD-1102033.pdf> Kyocera AVX <https://www.mouser.com/datasheet/2/40/C0GNP0_Dielectric-951274.pdf> GRM21BR61H <https://www.mouser.com/datasheet/2/281/1/GRM21BR61H106KE43_01A-1986884.pdf> C1812W104KDRACTU <https://www.mouser.com/datasheet/2/212/KEM_C1034_X7R_HV_ARC_SMD-1101730.pdf> CGA series - MLCC Automotive grade <https://product.tdk.com/system/files/dam/doc/product/capacitor/ceramic/mlcc/catalog/mlcc_automotive_general_en.pdf>; CAPACITANCE: 0.1uF; DKPN: 399-C1812W104KDRAC7800CT-ND; MANUFACTURER: KEMET; MOPN: 80-C1812W104KDR; MPN: C1812W104KDRAC7800; TOLERANCE: 10%; VOLTAGE: 1000V
C36 C45 = HyTechDevices:CAPACITOR_?_*: Capacitor, Non-Polarized VJ...1BC Series Datasheet <https://www.mouser.com/datasheet/2/427/vjw1bcbascomseries-1762447.pdf> Samsung Datasheet <https://www.mouser.com/datasheet/2/585/MLCC-1837944.pdf> Samsung Automotive MLCC Datasheet <https://www.mouser.com/datasheet/2/585/MLCC_Automotive-1837966.pdf> Walsin Datasheet <https://www.mouser.com/datasheet/2/210/WTC_MLCC_General_Purpose-1534899.pdf> GRM188R61A226ME15D <https://www.mouser.com/datasheet/2/281/1/GRM188R61A226ME15_02A-1985787.pdf> GRM188R61E106MA73D <https://www.mouser.com/datasheet/2/281/1/GRM188R61E106MA73_01A-1985806.pdf> 885012006013 <https://www.mouser.com/datasheet/2/445/885012006013-1726946.pdf> 2220Y6300105KXTWS2 <https://www.mouser.com/datasheet/2/218/SMD_High_and_Std_StackiCap_P62-1825512.pdf> Yageo Class 2, X5R <https://www.mouser.com/datasheet/2/447/UPY_GPHC_X5R_4V_to_50V_26-1827097.pdf> TDK C Series <https://www.mouser.com/ProductDetail/TDK/C3216X5R1V226M160AC?qs=%2Fha2pyFadujbcx9jh7lYl%2F4NeMoXFhdc8AqVWNq4wW6M2y7zl6GzBuhgtI0ngznN> AVX Automotive MLCC <https://www.mouser.com/datasheet/2/40/AutoMLCC-777028.pdf> KEMET X7R Series <https://www.mouser.com/datasheet/2/212/KEM_C1002_X7R_SMD-1102033.pdf> Kyocera AVX <https://www.mouser.com/datasheet/2/40/C0GNP0_Dielectric-951274.pdf> GRM21BR61H <https://www.mouser.com/datasheet/2/281/1/GRM21BR61H106KE43_01A-1986884.pdf> C1812W104KDRACTU <https://www.mouser.com/datasheet/2/212/KEM_C1034_X7R_HV_ARC_SMD-1101730.pdf> CGA series - MLCC Automotive grade <https://product.tdk.com/system/files/dam/doc/product/capacitor/ceramic/mlcc/catalog/mlcc_automotive_general_en.pdf>; CAPACITANCE: 1µF; DKPN: 478-KGM31HR71E105KUCT-ND; MANUFACTURER: KYOCERA AVX; MOPN: 581-12063C105K; MPN: KGM31HR71E105KU; TOLERANCE: 10%; VOLTAGE: 25V
C39 C48 = HyTechDevices:CAPACITOR_?_*: Capacitor, Non-Polarized VJ...1BC Series Datasheet <https://www.mouser.com/datasheet/2/427/vjw1bcbascomseries-1762447.pdf> Samsung Datasheet <https://www.mouser.com/datasheet/2/585/MLCC-1837944.pdf> Samsung Automotive MLCC Datasheet <https://www.mouser.com/datasheet/2/585/MLCC_Automotive-1837966.pdf> Walsin Datasheet <https://www.mouser.com/datasheet/2/210/WTC_MLCC_General_Purpose-1534899.pdf> GRM188R61A226ME15D <https://www.mouser.com/datasheet/2/281/1/GRM188R61A226ME15_02A-1985787.pdf> GRM188R61E106MA73D <https://www.mouser.com/datasheet/2/281/1/GRM188R61E106MA73_01A-1985806.pdf> 885012006013 <https://www.mouser.com/datasheet/2/445/885012006013-1726946.pdf> 2220Y6300105KXTWS2 <https://www.mouser.com/datasheet/2/218/SMD_High_and_Std_StackiCap_P62-1825512.pdf> Yageo Class 2, X5R <https://www.mouser.com/datasheet/2/447/UPY_GPHC_X5R_4V_to_50V_26-1827097.pdf> TDK C Series <https://www.mouser.com/ProductDetail/TDK/C3216X5R1V226M160AC?qs=%2Fha2pyFadujbcx9jh7lYl%2F4NeMoXFhdc8AqVWNq4wW6M2y7zl6GzBuhgtI0ngznN> AVX Automotive MLCC <https://www.mouser.com/datasheet/2/40/AutoMLCC-777028.pdf> KEMET X7R Series <https://www.mouser.com/datasheet/2/212/KEM_C1002_X7R_SMD-1102033.pdf> Kyocera AVX <https://www.mouser.com/datasheet/2/40/C0GNP0_Dielectric-951274.pdf> GRM21BR61H <https://www.mouser.com/datasheet/2/281/1/GRM21BR61H106KE43_01A-1986884.pdf> C1812W104KDRACTU <https://www.mouser.com/datasheet/2/212/KEM_C1034_X7R_HV_ARC_SMD-1101730.pdf> CGA series - MLCC Automotive grade <https://product.tdk.com/system/files/dam/doc/product/capacitor/ceramic/mlcc/catalog/mlcc_automotive_general_en.pdf>; CAPACITANCE: 0.1µF; DKPN: 445-14655-1-ND; MANUFACTURER: TDK Corporation; MOPN: 810-C3216NP01H104J1A; MPN: C3216NP01H104J160AA; TOLERANCE: 5%; VOLTAGE: 50V
C40 C49 = HyTechDevices:CAPACITOR_?_*: Capacitor, Non-Polarized VJ...1BC Series Datasheet <https://www.mouser.com/datasheet/2/427/vjw1bcbascomseries-1762447.pdf> Samsung Datasheet <https://www.mouser.com/datasheet/2/585/MLCC-1837944.pdf> Samsung Automotive MLCC Datasheet <https://www.mouser.com/datasheet/2/585/MLCC_Automotive-1837966.pdf> Walsin Datasheet <https://www.mouser.com/datasheet/2/210/WTC_MLCC_General_Purpose-1534899.pdf> GRM188R61A226ME15D <https://www.mouser.com/datasheet/2/281/1/GRM188R61A226ME15_02A-1985787.pdf> GRM188R61E106MA73D <https://www.mouser.com/datasheet/2/281/1/GRM188R61E106MA73_01A-1985806.pdf> 885012006013 <https://www.mouser.com/datasheet/2/445/885012006013-1726946.pdf> 2220Y6300105KXTWS2 <https://www.mouser.com/datasheet/2/218/SMD_High_and_Std_StackiCap_P62-1825512.pdf> Yageo Class 2, X5R <https://www.mouser.com/datasheet/2/447/UPY_GPHC_X5R_4V_to_50V_26-1827097.pdf> TDK C Series <https://www.mouser.com/ProductDetail/TDK/C3216X5R1V226M160AC?qs=%2Fha2pyFadujbcx9jh7lYl%2F4NeMoXFhdc8AqVWNq4wW6M2y7zl6GzBuhgtI0ngznN> AVX Automotive MLCC <https://www.mouser.com/datasheet/2/40/AutoMLCC-777028.pdf> KEMET X7R Series <https://www.mouser.com/datasheet/2/212/KEM_C1002_X7R_SMD-1102033.pdf> Kyocera AVX <https://www.mouser.com/datasheet/2/40/C0GNP0_Dielectric-951274.pdf> GRM21BR61H <https://www.mouser.com/datasheet/2/281/1/GRM21BR61H106KE43_01A-1986884.pdf> C1812W104KDRACTU <https://www.mouser.com/datasheet/2/212/KEM_C1034_X7R_HV_ARC_SMD-1101730.pdf> CGA series - MLCC Automotive grade <https://product.tdk.com/system/files/dam/doc/product/capacitor/ceramic/mlcc/catalog/mlcc_automotive_general_en.pdf>; CAPACITANCE: 1µF; DKPN: 1276-1184-1-ND; MANUFACTURER: Samsung Electro-Mechanics; MOPN: 187-CL10B105KA8NNNC; MPN: CL10B105KA8NNNC; TOLERANCE: 10%; VOLTAGE: 25V
C41 C50 = HyTechDevices:CAPACITOR_?_*: Capacitor, Non-Polarized VJ...1BC Series Datasheet <https://www.mouser.com/datasheet/2/427/vjw1bcbascomseries-1762447.pdf> Samsung Datasheet <https://www.mouser.com/datasheet/2/585/MLCC-1837944.pdf> Samsung Automotive MLCC Datasheet <https://www.mouser.com/datasheet/2/585/MLCC_Automotive-1837966.pdf> Walsin Datasheet <https://www.mouser.com/datasheet/2/210/WTC_MLCC_General_Purpose-1534899.pdf> GRM188R61A226ME15D <https://www.mouser.com/datasheet/2/281/1/GRM188R61A226ME15_02A-1985787.pdf> GRM188R61E106MA73D <https://www.mouser.com/datasheet/2/281/1/GRM188R61E106MA73_01A-1985806.pdf> 885012006013 <https://www.mouser.com/datasheet/2/445/885012006013-1726946.pdf> 2220Y6300105KXTWS2 <https://www.mouser.com/datasheet/2/218/SMD_High_and_Std_StackiCap_P62-1825512.pdf> Yageo Class 2, X5R <https://www.mouser.com/datasheet/2/447/UPY_GPHC_X5R_4V_to_50V_26-1827097.pdf> TDK C Series <https://www.mouser.com/ProductDetail/TDK/C3216X5R1V226M160AC?qs=%2Fha2pyFadujbcx9jh7lYl%2F4NeMoXFhdc8AqVWNq4wW6M2y7zl6GzBuhgtI0ngznN> AVX Automotive MLCC <https://www.mouser.com/datasheet/2/40/AutoMLCC-777028.pdf> KEMET X7R Series <https://www.mouser.com/datasheet/2/212/KEM_C1002_X7R_SMD-1102033.pdf> Kyocera AVX <https://www.mouser.com/datasheet/2/40/C0GNP0_Dielectric-951274.pdf> GRM21BR61H <https://www.mouser.com/datasheet/2/281/1/GRM21BR61H106KE43_01A-1986884.pdf> C1812W104KDRACTU <https://www.mouser.com/datasheet/2/212/KEM_C1034_X7R_HV_ARC_SMD-1101730.pdf> CGA series - MLCC Automotive grade <https://product.tdk.com/system/files/dam/doc/product/capacitor/ceramic/mlcc/catalog/mlcc_automotive_general_en.pdf>; CAPACITANCE: 1nF; DKPN: 399-C0603C102K5RAC7867CT-ND; MANUFACTURER: KEMET; MOPN: 80-C0603C102K5R; MPN: C0603C102K5RACTU; TOLERANCE: 10%; VOLTAGE: 50V
C43 C52 = HyTechDevices:CAPACITOR_?_*: Capacitor, Non-Polarized VJ...1BC Series Datasheet <https://www.mouser.com/datasheet/2/427/vjw1bcbascomseries-1762447.pdf> Samsung Datasheet <https://www.mouser.com/datasheet/2/585/MLCC-1837944.pdf> Samsung Automotive MLCC Datasheet <https://www.mouser.com/datasheet/2/585/MLCC_Automotive-1837966.pdf> Walsin Datasheet <https://www.mouser.com/datasheet/2/210/WTC_MLCC_General_Purpose-1534899.pdf> GRM188R61A226ME15D <https://www.mouser.com/datasheet/2/281/1/GRM188R61A226ME15_02A-1985787.pdf> GRM188R61E106MA73D <https://www.mouser.com/datasheet/2/281/1/GRM188R61E106MA73_01A-1985806.pdf> 885012006013 <https://www.mouser.com/datasheet/2/445/885012006013-1726946.pdf> 2220Y6300105KXTWS2 <https://www.mouser.com/datasheet/2/218/SMD_High_and_Std_StackiCap_P62-1825512.pdf> Yageo Class 2, X5R <https://www.mouser.com/datasheet/2/447/UPY_GPHC_X5R_4V_to_50V_26-1827097.pdf> TDK C Series <https://www.mouser.com/ProductDetail/TDK/C3216X5R1V226M160AC?qs=%2Fha2pyFadujbcx9jh7lYl%2F4NeMoXFhdc8AqVWNq4wW6M2y7zl6GzBuhgtI0ngznN> AVX Automotive MLCC <https://www.mouser.com/datasheet/2/40/AutoMLCC-777028.pdf> KEMET X7R Series <https://www.mouser.com/datasheet/2/212/KEM_C1002_X7R_SMD-1102033.pdf> Kyocera AVX <https://www.mouser.com/datasheet/2/40/C0GNP0_Dielectric-951274.pdf> GRM21BR61H <https://www.mouser.com/datasheet/2/281/1/GRM21BR61H106KE43_01A-1986884.pdf> C1812W104KDRACTU <https://www.mouser.com/datasheet/2/212/KEM_C1034_X7R_HV_ARC_SMD-1101730.pdf> CGA series - MLCC Automotive grade <https://product.tdk.com/system/files/dam/doc/product/capacitor/ceramic/mlcc/catalog/mlcc_automotive_general_en.pdf>; CAPACITANCE: 10nF; DKPN: 311-1788-1-ND; MANUFACTURER: Yageo; MOPN: 603-CC603KRX7R0BB103; MPN: CC0603KRX7R0BB103; TOLERANCE: 10%; VOLTAGE: 100V
C54 = HyTechDevices:CAPACITOR_?_*: Capacitor, Non-Polarized VJ...1BC Series Datasheet <https://www.mouser.com/datasheet/2/427/vjw1bcbascomseries-1762447.pdf> Samsung Datasheet <https://www.mouser.com/datasheet/2/585/MLCC-1837944.pdf> Samsung Automotive MLCC Datasheet <https://www.mouser.com/datasheet/2/585/MLCC_Automotive-1837966.pdf> Walsin Datasheet <https://www.mouser.com/datasheet/2/210/WTC_MLCC_General_Purpose-1534899.pdf> GRM188R61A226ME15D <https://www.mouser.com/datasheet/2/281/1/GRM188R61A226ME15_02A-1985787.pdf> GRM188R61E106MA73D <https://www.mouser.com/datasheet/2/281/1/GRM188R61E106MA73_01A-1985806.pdf> 885012006013 <https://www.mouser.com/datasheet/2/445/885012006013-1726946.pdf> 2220Y6300105KXTWS2 <https://www.mouser.com/datasheet/2/218/SMD_High_and_Std_StackiCap_P62-1825512.pdf> Yageo Class 2, X5R <https://www.mouser.com/datasheet/2/447/UPY_GPHC_X5R_4V_to_50V_26-1827097.pdf> TDK C Series <https://www.mouser.com/ProductDetail/TDK/C3216X5R1V226M160AC?qs=%2Fha2pyFadujbcx9jh7lYl%2F4NeMoXFhdc8AqVWNq4wW6M2y7zl6GzBuhgtI0ngznN> AVX Automotive MLCC <https://www.mouser.com/datasheet/2/40/AutoMLCC-777028.pdf> KEMET X7R Series <https://www.mouser.com/datasheet/2/212/KEM_C1002_X7R_SMD-1102033.pdf> Kyocera AVX <https://www.mouser.com/datasheet/2/40/C0GNP0_Dielectric-951274.pdf> GRM21BR61H <https://www.mouser.com/datasheet/2/281/1/GRM21BR61H106KE43_01A-1986884.pdf> C1812W104KDRACTU <https://www.mouser.com/datasheet/2/212/KEM_C1034_X7R_HV_ARC_SMD-1101730.pdf> CGA series - MLCC Automotive grade <https://product.tdk.com/system/files/dam/doc/product/capacitor/ceramic/mlcc/catalog/mlcc_automotive_general_en.pdf>; CAPACITANCE: 47pF; DKPN: 490-5041-1-ND; MANUFACTURER: Murata Electronics; MOPN: 81-GCM31A7U2J470JX1D; MPN: GCM31A7U2J470JX01D; TOLERANCE: 5%; VOLTAGE: 630V
C55 = HyTechDevices:CAPACITOR_?_*: Capacitor, Non-Polarized VJ...1BC Series Datasheet <https://www.mouser.com/datasheet/2/427/vjw1bcbascomseries-1762447.pdf> Samsung Datasheet <https://www.mouser.com/datasheet/2/585/MLCC-1837944.pdf> Samsung Automotive MLCC Datasheet <https://www.mouser.com/datasheet/2/585/MLCC_Automotive-1837966.pdf> Walsin Datasheet <https://www.mouser.com/datasheet/2/210/WTC_MLCC_General_Purpose-1534899.pdf> GRM188R61A226ME15D <https://www.mouser.com/datasheet/2/281/1/GRM188R61A226ME15_02A-1985787.pdf> GRM188R61E106MA73D <https://www.mouser.com/datasheet/2/281/1/GRM188R61E106MA73_01A-1985806.pdf> 885012006013 <https://www.mouser.com/datasheet/2/445/885012006013-1726946.pdf> 2220Y6300105KXTWS2 <https://www.mouser.com/datasheet/2/218/SMD_High_and_Std_StackiCap_P62-1825512.pdf> Yageo Class 2, X5R <https://www.mouser.com/datasheet/2/447/UPY_GPHC_X5R_4V_to_50V_26-1827097.pdf> TDK C Series <https://www.mouser.com/ProductDetail/TDK/C3216X5R1V226M160AC?qs=%2Fha2pyFadujbcx9jh7lYl%2F4NeMoXFhdc8AqVWNq4wW6M2y7zl6GzBuhgtI0ngznN> AVX Automotive MLCC <https://www.mouser.com/datasheet/2/40/AutoMLCC-777028.pdf> KEMET X7R Series <https://www.mouser.com/datasheet/2/212/KEM_C1002_X7R_SMD-1102033.pdf> Kyocera AVX <https://www.mouser.com/datasheet/2/40/C0GNP0_Dielectric-951274.pdf> GRM21BR61H <https://www.mouser.com/datasheet/2/281/1/GRM21BR61H106KE43_01A-1986884.pdf> C1812W104KDRACTU <https://www.mouser.com/datasheet/2/212/KEM_C1034_X7R_HV_ARC_SMD-1101730.pdf> CGA series - MLCC Automotive grade <https://product.tdk.com/system/files/dam/doc/product/capacitor/ceramic/mlcc/catalog/mlcc_automotive_general_en.pdf>; CAPACITANCE: 10nF; DKPN: 445-9083-1-ND; MANUFACTURER: TDK Corporation; MOPN: 810-CGA5L4C0G2J103J; MPN: CGA5L4C0G2J103J160AA; TOLERANCE: 5%; VOLTAGE: 630V
C56 = HyTechDevices:CAPACITOR_?_*: Capacitor, Non-Polarized VJ...1BC Series Datasheet <https://www.mouser.com/datasheet/2/427/vjw1bcbascomseries-1762447.pdf> Samsung Datasheet <https://www.mouser.com/datasheet/2/585/MLCC-1837944.pdf> Samsung Automotive MLCC Datasheet <https://www.mouser.com/datasheet/2/585/MLCC_Automotive-1837966.pdf> Walsin Datasheet <https://www.mouser.com/datasheet/2/210/WTC_MLCC_General_Purpose-1534899.pdf> GRM188R61A226ME15D <https://www.mouser.com/datasheet/2/281/1/GRM188R61A226ME15_02A-1985787.pdf> GRM188R61E106MA73D <https://www.mouser.com/datasheet/2/281/1/GRM188R61E106MA73_01A-1985806.pdf> 885012006013 <https://www.mouser.com/datasheet/2/445/885012006013-1726946.pdf> 2220Y6300105KXTWS2 <https://www.mouser.com/datasheet/2/218/SMD_High_and_Std_StackiCap_P62-1825512.pdf> Yageo Class 2, X5R <https://www.mouser.com/datasheet/2/447/UPY_GPHC_X5R_4V_to_50V_26-1827097.pdf> TDK C Series <https://www.mouser.com/ProductDetail/TDK/C3216X5R1V226M160AC?qs=%2Fha2pyFadujbcx9jh7lYl%2F4NeMoXFhdc8AqVWNq4wW6M2y7zl6GzBuhgtI0ngznN> AVX Automotive MLCC <https://www.mouser.com/datasheet/2/40/AutoMLCC-777028.pdf> KEMET X7R Series <https://www.mouser.com/datasheet/2/212/KEM_C1002_X7R_SMD-1102033.pdf> Kyocera AVX <https://www.mouser.com/datasheet/2/40/C0GNP0_Dielectric-951274.pdf> GRM21BR61H <https://www.mouser.com/datasheet/2/281/1/GRM21BR61H106KE43_01A-1986884.pdf> C1812W104KDRACTU <https://www.mouser.com/datasheet/2/212/KEM_C1034_X7R_HV_ARC_SMD-1101730.pdf> CGA series - MLCC Automotive grade <https://product.tdk.com/system/files/dam/doc/product/capacitor/ceramic/mlcc/catalog/mlcc_automotive_general_en.pdf>; CAPACITANCE: 10nF; DKPN: 445-7404-1-ND; MANUFACTURER: TDK Corporation; MOPN: 810-C1608C0G1H103J; MPN: C1608C0G1H103J080AA; TOLERANCE: 5%; VOLTAGE: 50V
D2 = HyTechDevices:SCHOTTKY_?_*: CUS08F30 Shottky Diode Datasheet <https://www.mouser.com/datasheet/2/408/CUS08F30_datasheet_en_20140414-1916097.pdf> CMDSH2-3 Shottky Diode Datasheet <https://www.mouser.com/datasheet/2/68/cmdsh2-3-39086.pdf>; CURRENT: 0.2A; DKPN: 1514-CMDSH2-3TRPBFREECT-ND; MANUFACTURER: Central Semiconductor Corp; MOPN: 610-CMDSH2-3; MPN: CMDSH2-3 TR PBFREE; VOLTAGE: 30V
D3 D4 = HyTechDevices:LED_?_*: LED 0603 Blue <https://www.mouser.com/datasheet/2/216/APT1608VBC_D-246010.pdf> Green <https://www.mouser.com/datasheet/2/216/APT1608ZGCK-1173388.pdf> Orange <https://www.mouser.com/datasheet/2/216/APT1608SECK-6197.pdf> Red <https://www.mouser.com/datasheet/2/216/APT1608SECK-J3-PRV-1173336.pdf> White <https://www.mouser.com/datasheet/2/50/SM0603UWC-880813.pdf> Yellow <https://www.mouser.com/datasheet/2/216/APT1608SYCK-J3-PRV-1173311.pdf> 2835 (Series not on Digikey) Lumiled LUXEON 2835 Color Line <https://www.mouser.com/datasheet/2/602/DS236_luxeon_2835_color_line_datasheet-1596094.pdf>; COLOR: Blue; DKPN: 754-1789-1-ND; MANUFACTURER: Kingbright; MOPN: 604-APT1608VBC/D; MPN: APT1608VBC/D
D5 = HyTechDevices:LED_?_*: LED 0603 Blue <https://www.mouser.com/datasheet/2/216/APT1608VBC_D-246010.pdf> Green <https://www.mouser.com/datasheet/2/216/APT1608ZGCK-1173388.pdf> Orange <https://www.mouser.com/datasheet/2/216/APT1608SECK-6197.pdf> Red <https://www.mouser.com/datasheet/2/216/APT1608SECK-J3-PRV-1173336.pdf> White <https://www.mouser.com/datasheet/2/50/SM0603UWC-880813.pdf> Yellow <https://www.mouser.com/datasheet/2/216/APT1608SYCK-J3-PRV-1173311.pdf> 2835 (Series not on Digikey) Lumiled LUXEON 2835 Color Line <https://www.mouser.com/datasheet/2/602/DS236_luxeon_2835_color_line_datasheet-1596094.pdf>; COLOR: Orange; DKPN: 754-1120-1-ND; MANUFACTURER: Kingbright; MOPN: 604-APT1608SECK; MPN: APT1608SECK
D6 LED_+12V1 = HyTechDevices:LED_?_*: LED 0603 Blue <https://www.mouser.com/datasheet/2/216/APT1608VBC_D-246010.pdf> Green <https://www.mouser.com/datasheet/2/216/APT1608ZGCK-1173388.pdf> Orange <https://www.mouser.com/datasheet/2/216/APT1608SECK-6197.pdf> Red <https://www.mouser.com/datasheet/2/216/APT1608SECK-J3-PRV-1173336.pdf> White <https://www.mouser.com/datasheet/2/50/SM0603UWC-880813.pdf> Yellow <https://www.mouser.com/datasheet/2/216/APT1608SYCK-J3-PRV-1173311.pdf> 2835 (Series not on Digikey) Lumiled LUXEON 2835 Color Line <https://www.mouser.com/datasheet/2/602/DS236_luxeon_2835_color_line_datasheet-1596094.pdf>; COLOR: Green; DKPN: 754-1790-1-ND; MANUFACTURER: Kingbright; MOPN: 604-APT1608ZGCK; MPN: APT1608ZGCK
D7 = HyTechDevices:TVS_?_*: TVS Diode GSOT Datasheet <https://www.mouser.com/datasheet/2/427/gsot03-1767593.pdf>; DKPN: GSOT08-E3-08TR-ND; MANUFACTURER: Vishay General Semiconductor - Diodes Division; MOPN: 78-GSOT08-E3-08; MPN: GSOT08-E3-08; VOLTAGE: 8V
D8 = HyTechDevices:LED_?_*: LED 0603 Blue <https://www.mouser.com/datasheet/2/216/APT1608VBC_D-246010.pdf> Green <https://www.mouser.com/datasheet/2/216/APT1608ZGCK-1173388.pdf> Orange <https://www.mouser.com/datasheet/2/216/APT1608SECK-6197.pdf> Red <https://www.mouser.com/datasheet/2/216/APT1608SECK-J3-PRV-1173336.pdf> White <https://www.mouser.com/datasheet/2/50/SM0603UWC-880813.pdf> Yellow <https://www.mouser.com/datasheet/2/216/APT1608SYCK-J3-PRV-1173311.pdf> 2835 (Series not on Digikey) Lumiled LUXEON 2835 Color Line <https://www.mouser.com/datasheet/2/602/DS236_luxeon_2835_color_line_datasheet-1596094.pdf>; COLOR: Yellow; DKPN: 754-1788-1-ND; MANUFACTURER: Kingbright; MOPN: 604-APT1608SYCK/J3-PRV; MPN: APT1608SYCK/J3-PRV
D9-D11 = HyTechDevices:RECTIFIER_*_?: Diodes Incorporated US1GWF Datasheet <https://www.mouser.com/datasheet/2/115/DIOD_S_A0003383552_1-2542294.pdf> Diodes Incorporated US1M Datasheet <https://www.diodes.com/assets/Datasheets/ds16008.pdf> onsemi US1KFA Datasheet <https://www.onsemi.com/pdf/datasheet/us1mfa-d.pdf>; CURRENT: 1A; DKPN: US1KFACT-ND; MANUFACTURER: onsemi; MOPN: 512-US1KFA; MPN: US1KFA; VOLTAGE: 800V
D12 = HyTechDevices:ZENER_?_*: Zener Diode 1SMB5949B-13 <https://www.diodes.com/assets/Datasheets/ds32125.pdf> SMBJ5350B-TP <https://www.mccsemi.com/pdf/Products/SMBJ5338B-SMBJ5388B(SMB).pdf>; CURRENT: 0.385A; DKPN: SMBJ5350B-TPMSCT-ND; MANUFACTURER: Micro Commercial Co; MOPN: 833-SMBJ5350B-TP; MPN: SMBJ5350B-TP; VOLTAGE: 13V
D100 = HyTechDevices:SCHOTTKY_?_*: CUS08F30 Shottky Diode Datasheet <https://www.mouser.com/datasheet/2/408/CUS08F30_datasheet_en_20140414-1916097.pdf> CMDSH2-3 Shottky Diode Datasheet <https://www.mouser.com/datasheet/2/68/cmdsh2-3-39086.pdf>; CURRENT: 1A; DKPN: 3757-MBR1060HEWS_R1_00001TR-ND; MANUFACTURER: Panjit International Inc.; MOPN: 241-MBR1060HEWSR1000; MPN: MBR1060HEWS_R1_00001; VOLTAGE: 60V
F1 F2 = HyTechDevices:FUSE_HOLDER_*: Fuse Holder All PNs for the holder; if Miniblade Fuses <https://www.littelfuse.com/media?resourcetype=datasheets&itemid=0f5f58cb-559e-494b-8d53-723f30445ae5&filename=littelfuse-mini-datasheet> needed, order separately. Mini-Blade PTH <https://www.mouser.com/datasheet/2/215/3568-742601.pdf> Mini-Blade SMD <https://www.mouser.com/datasheet/2/215/588-744913.pdf> Littelfuse 122 Fuse Holder and Fuse Fuse <https://www.littelfuse.com/~/media/electronics/datasheets/fuses/littelfuse_fuse_508_datasheet.pdf.pdf> Fuse Holder <https://www.littelfuse.com/~/media/electronics/datasheets/fuse_clips/littelfuse_fuse_clip_102_122_datasheet.pdf.pdf>; DKPN: F3783-ND; FUSE_TYPE: 1 1/4" Cartridge; MANUFACTURER: Littelfuse; MOPN: 576-01220088Z; MPN: 01220088Z
J1 = HyTechDevices:CONNECTOR-5_?_*; MANUFACTURER: Molex; MPN: 43650-0717
J2 = HyTechDevices:CONNECTOR-5_?_*; MANUFACTURER: Molex; MPN: 43650-0617
J3 = HyTechDevices:CONNECTOR-8_?_*: 8 Pin Connector; DKPN: WM1798-ND; MANUFACTURER: Molex; MOPN: 538-43045-0814; MPN: 430450814
K1 = HyTechDevices:RELAY_SPST_NO_?*: Single Pole, Single Throw Relay Normally Open 355x Series <https://www.comus-intl.com/wp-content/uploads/2017/01/High-Voltage-Reed-Relays.pdf> D Series <https://www.mouser.com/datasheet/2/657/cynergy3_d_pcb_v2-1892244.pdf>; DKPN: 725-1048-ND; MANUFACTURER: Sensata-Cynergy3; MOPN: 285-DAR72410; MPN: DAR72410
L1 = HyTechDevices:INDUCTOR_?_*: Inductor LQM18DH100M70 Datasheet <https://search.murata.co.jp/Ceramy/image/img/P02/JELF243B-9127.pdf> 74451133 Datasheet <https://www.we-online.com/catalog/datasheet/74451133.pdf> SRU1408 Datasheet <https://www.mouser.com/datasheet/2/54/SRU1048-1391431.pdf> PA4334 Datasheet <https://www.mouser.com/datasheet/2/336/plei_s_a0002827602_1-2281222.pdf> WE-LMHI Datasheet <https://www.mouser.com/datasheet/2/445/74437349560-1721693.pdf> SRR0745A Datasheet <https://www.bourns.com/docs/Product-Datasheets/SRR0745A.pdf>; CURRENT_RATED: 200mA; CURRENT_SATURATION: 240mA; DCR: 4.1Ω; DKPN: SRR0745A-102MCT-ND; INDUCTANCE: 1mH; MANUFACTURER: Bourns Inc.; MOPN: 652-SRR0745A-102M; MPN: SRR0745A-102M; TOLERANCE: 20%
Q2 = HyTechDevices:TRANSISTOR_N_MOS_?_*: N-MOSFET PMV15ENEA Datasheet <https://www.mouser.com/datasheet/2/916/PMV15ENEA-1604828.pdf> TK6P65W Datasheet <https://www.mouser.com/datasheet/2/408/TK6P65W_datasheet_en_20151225-1916290.pdf> SIR638ADP Datasheet <https://www.mouser.com/datasheet/2/427/sir638adp-1766131.pdf> DMG3406L Datasheet <https://www.diodes.com/assets/Datasheets/DMG3406L.pdf> STL2N80K5 <https://www.mouser.com/datasheet/2/389/dm00092662-1798082.pdf>; DKPN: 1727-8588-1-ND; MANUFACTURER: Nexperia USA Inc.; MOPN: 771-PMV15ENEAR; MPN: PMV15ENEAR
R13 R23 = HyTechDevices:RESISTOR_?_*: Resistor PWR163 Series <https://www.mouser.com/datasheet/2/54/pwr163-777985.pdf> AC Series <https://www.mouser.com/datasheet/2/447/Yageo_PYu_AC_51_RoHS_L_7_1714230-1874691.pdf> PU Series <https://www.mouser.com/datasheet/2/447/PYu-PU_51_RoHS_L_6-1504619.pdf> UCR Series <https://fscdn.rohm.com/en/products/databook/datasheet/passive/resistor/chip_resistor/ucr-e.pdf> ERA Series <https://www.mouser.com/datasheet/2/315/AOA0000C307-1149632.pdf> PWR263 Series <https://www.mouser.com/datasheet/2/54/pwr263s_35-778069.pdf> KTR Series <https://www.mouser.com/datasheet/2/348/ROHM_S_A0011075115_1-2563276.pdf> RC Series <https://www.mouser.com/datasheet/2/447/Yageo_03_18_2021_PYu_RC_Group_51_RoHS_L_11-2199992.pdf> ERJ Low Resistance Series <https://www.mouser.com/datasheet/2/315/AOA0000C313-1141758.pdf> ERJ PB3, PB6 Series <https://www.mouser.com/datasheet/2/315/AOA0000C328-1530132.pdf> ERJ PA2, P03, PA3, P06, P08, P14 Series <https://www.mouser.com/datasheet/2/315/AOA0000C331-1141874.pdf> B20 Series <https://www.ohmite.com/assets/docs/res_200.pdf?r=false> TE Connectivity/Holsworthy RN73 Series <https://www.mouser.com/datasheet/2/418/4/NG_DS_1773270_M-604713.pdf> Vishay Dale D/CRCW e3 <https://www.mouser.com/datasheet/2/427/dcrcwe3-1762152.pdf> Ohmite B20 <https://www.ohmite.com/assets/docs/res_200.pdf?r=false>; DKPN: B20J1K5E-ND; MANUFACTURER: Ohmite; MOPN: 588-B20J1K5E; MPN: B20J1K5E; POWER: 20W; RESISTANCE: 1.5K; TOLERANCE: 5%; VOLTAGE_CONTINUOUS: 173V; VOLTAGE_MAX: 750V
R15 = HyTechDevices:RESISTOR_?_*: Resistor PWR163 Series <https://www.mouser.com/datasheet/2/54/pwr163-777985.pdf> AC Series <https://www.mouser.com/datasheet/2/447/Yageo_PYu_AC_51_RoHS_L_7_1714230-1874691.pdf> PU Series <https://www.mouser.com/datasheet/2/447/PYu-PU_51_RoHS_L_6-1504619.pdf> UCR Series <https://fscdn.rohm.com/en/products/databook/datasheet/passive/resistor/chip_resistor/ucr-e.pdf> ERA Series <https://www.mouser.com/datasheet/2/315/AOA0000C307-1149632.pdf> PWR263 Series <https://www.mouser.com/datasheet/2/54/pwr263s_35-778069.pdf> KTR Series <https://www.mouser.com/datasheet/2/348/ROHM_S_A0011075115_1-2563276.pdf> RC Series <https://www.mouser.com/datasheet/2/447/Yageo_03_18_2021_PYu_RC_Group_51_RoHS_L_11-2199992.pdf> ERJ Low Resistance Series <https://www.mouser.com/datasheet/2/315/AOA0000C313-1141758.pdf> ERJ PB3, PB6 Series <https://www.mouser.com/datasheet/2/315/AOA0000C328-1530132.pdf> ERJ PA2, P03, PA3, P06, P08, P14 Series <https://www.mouser.com/datasheet/2/315/AOA0000C331-1141874.pdf> B20 Series <https://www.ohmite.com/assets/docs/res_200.pdf?r=false> TE Connectivity/Holsworthy RN73 Series <https://www.mouser.com/datasheet/2/418/4/NG_DS_1773270_M-604713.pdf> Vishay Dale D/CRCW e3 <https://www.mouser.com/datasheet/2/427/dcrcwe3-1762152.pdf> Ohmite B20 <https://www.ohmite.com/assets/docs/res_200.pdf?r=false>; DKPN: RT0603BRB0714KL-ND; MANUFACTURER: YAGEO; MOPN: 603-RT0603BRB0714KL; MPN: RT0603BRB0714KL; POWER: 0.1W; RESISTANCE: 14k; TOLERANCE: 0.1%; VOLTAGE_CONTINUOUS: 37.4V; VOLTAGE_MAX: 75V
R18 = HyTechDevices:RESISTOR_?_*: Resistor PWR163 Series <https://www.mouser.com/datasheet/2/54/pwr163-777985.pdf> AC Series <https://www.mouser.com/datasheet/2/447/Yageo_PYu_AC_51_RoHS_L_7_1714230-1874691.pdf> PU Series <https://www.mouser.com/datasheet/2/447/PYu-PU_51_RoHS_L_6-1504619.pdf> UCR Series <https://fscdn.rohm.com/en/products/databook/datasheet/passive/resistor/chip_resistor/ucr-e.pdf> ERA Series <https://www.mouser.com/datasheet/2/315/AOA0000C307-1149632.pdf> PWR263 Series <https://www.mouser.com/datasheet/2/54/pwr263s_35-778069.pdf> KTR Series <https://www.mouser.com/datasheet/2/348/ROHM_S_A0011075115_1-2563276.pdf> RC Series <https://www.mouser.com/datasheet/2/447/Yageo_03_18_2021_PYu_RC_Group_51_RoHS_L_11-2199992.pdf> ERJ Low Resistance Series <https://www.mouser.com/datasheet/2/315/AOA0000C313-1141758.pdf> ERJ PB3, PB6 Series <https://www.mouser.com/datasheet/2/315/AOA0000C328-1530132.pdf> ERJ PA2, P03, PA3, P06, P08, P14 Series <https://www.mouser.com/datasheet/2/315/AOA0000C331-1141874.pdf> B20 Series <https://www.ohmite.com/assets/docs/res_200.pdf?r=false> TE Connectivity/Holsworthy RN73 Series <https://www.mouser.com/datasheet/2/418/4/NG_DS_1773270_M-604713.pdf> Vishay Dale D/CRCW e3 <https://www.mouser.com/datasheet/2/427/dcrcwe3-1762152.pdf> Ohmite B20 <https://www.ohmite.com/assets/docs/res_200.pdf?r=false>; DKPN: 311-1.65KHRCT-ND; MANUFACTURER: Yageo; MOPN: 603-RC0603FR-071K65L; MPN: RC0603FR-071K65L; POWER: 0.1W; RESISTANCE: 1.65k; TOLERANCE: 1%; VOLTAGE_CONTINUOUS: 12.85V; VOLTAGE_MAX: 75V
R20 R42 = HyTechDevices:RESISTOR_?_*: Resistor PWR163 Series <https://www.mouser.com/datasheet/2/54/pwr163-777985.pdf> AC Series <https://www.mouser.com/datasheet/2/447/Yageo_PYu_AC_51_RoHS_L_7_1714230-1874691.pdf> PU Series <https://www.mouser.com/datasheet/2/447/PYu-PU_51_RoHS_L_6-1504619.pdf> UCR Series <https://fscdn.rohm.com/en/products/databook/datasheet/passive/resistor/chip_resistor/ucr-e.pdf> ERA Series <https://www.mouser.com/datasheet/2/315/AOA0000C307-1149632.pdf> PWR263 Series <https://www.mouser.com/datasheet/2/54/pwr263s_35-778069.pdf> KTR Series <https://www.mouser.com/datasheet/2/348/ROHM_S_A0011075115_1-2563276.pdf> RC Series <https://www.mouser.com/datasheet/2/447/Yageo_03_18_2021_PYu_RC_Group_51_RoHS_L_11-2199992.pdf> ERJ Low Resistance Series <https://www.mouser.com/datasheet/2/315/AOA0000C313-1141758.pdf> ERJ PB3, PB6 Series <https://www.mouser.com/datasheet/2/315/AOA0000C328-1530132.pdf> ERJ PA2, P03, PA3, P06, P08, P14 Series <https://www.mouser.com/datasheet/2/315/AOA0000C331-1141874.pdf> B20 Series <https://www.ohmite.com/assets/docs/res_200.pdf?r=false> TE Connectivity/Holsworthy RN73 Series <https://www.mouser.com/datasheet/2/418/4/NG_DS_1773270_M-604713.pdf> Vishay Dale D/CRCW e3 <https://www.mouser.com/datasheet/2/427/dcrcwe3-1762152.pdf> Ohmite B20 <https://www.ohmite.com/assets/docs/res_200.pdf?r=false>; RESISTANCE: DNP
R24 = HyTechDevices:RESISTOR_?_*: Resistor PWR163 Series <https://www.mouser.com/datasheet/2/54/pwr163-777985.pdf> AC Series <https://www.mouser.com/datasheet/2/447/Yageo_PYu_AC_51_RoHS_L_7_1714230-1874691.pdf> PU Series <https://www.mouser.com/datasheet/2/447/PYu-PU_51_RoHS_L_6-1504619.pdf> UCR Series <https://fscdn.rohm.com/en/products/databook/datasheet/passive/resistor/chip_resistor/ucr-e.pdf> ERA Series <https://www.mouser.com/datasheet/2/315/AOA0000C307-1149632.pdf> PWR263 Series <https://www.mouser.com/datasheet/2/54/pwr263s_35-778069.pdf> KTR Series <https://www.mouser.com/datasheet/2/348/ROHM_S_A0011075115_1-2563276.pdf> RC Series <https://www.mouser.com/datasheet/2/447/Yageo_03_18_2021_PYu_RC_Group_51_RoHS_L_11-2199992.pdf> ERJ Low Resistance Series <https://www.mouser.com/datasheet/2/315/AOA0000C313-1141758.pdf> ERJ PB3, PB6 Series <https://www.mouser.com/datasheet/2/315/AOA0000C328-1530132.pdf> ERJ PA2, P03, PA3, P06, P08, P14 Series <https://www.mouser.com/datasheet/2/315/AOA0000C331-1141874.pdf> B20 Series <https://www.ohmite.com/assets/docs/res_200.pdf?r=false> TE Connectivity/Holsworthy RN73 Series <https://www.mouser.com/datasheet/2/418/4/NG_DS_1773270_M-604713.pdf> Vishay Dale D/CRCW e3 <https://www.mouser.com/datasheet/2/427/dcrcwe3-1762152.pdf> Ohmite B20 <https://www.ohmite.com/assets/docs/res_200.pdf?r=false>; DKPN: 13-RT0603BRD0739RLTR-ND; MANUFACTURER: Yageo; MOPN: 603-RT0603BRD0739RL; MPN: RT0603BRD0739RL; POWER: 0.1W; RESISTANCE: 39; TOLERANCE: 1%; VOLTAGE_CONTINUOUS: 1.97V; VOLTAGE_MAX: 75V
R25 R27 = HyTechDevices:RESISTOR_?_*: Resistor PWR163 Series <https://www.mouser.com/datasheet/2/54/pwr163-777985.pdf> AC Series <https://www.mouser.com/datasheet/2/447/Yageo_PYu_AC_51_RoHS_L_7_1714230-1874691.pdf> PU Series <https://www.mouser.com/datasheet/2/447/PYu-PU_51_RoHS_L_6-1504619.pdf> UCR Series <https://fscdn.rohm.com/en/products/databook/datasheet/passive/resistor/chip_resistor/ucr-e.pdf> ERA Series <https://www.mouser.com/datasheet/2/315/AOA0000C307-1149632.pdf> PWR263 Series <https://www.mouser.com/datasheet/2/54/pwr263s_35-778069.pdf> KTR Series <https://www.mouser.com/datasheet/2/348/ROHM_S_A0011075115_1-2563276.pdf> RC Series <https://www.mouser.com/datasheet/2/447/Yageo_03_18_2021_PYu_RC_Group_51_RoHS_L_11-2199992.pdf> ERJ Low Resistance Series <https://www.mouser.com/datasheet/2/315/AOA0000C313-1141758.pdf> ERJ PB3, PB6 Series <https://www.mouser.com/datasheet/2/315/AOA0000C328-1530132.pdf> ERJ PA2, P03, PA3, P06, P08, P14 Series <https://www.mouser.com/datasheet/2/315/AOA0000C331-1141874.pdf> B20 Series <https://www.ohmite.com/assets/docs/res_200.pdf?r=false> TE Connectivity/Holsworthy RN73 Series <https://www.mouser.com/datasheet/2/418/4/NG_DS_1773270_M-604713.pdf> Vishay Dale D/CRCW e3 <https://www.mouser.com/datasheet/2/427/dcrcwe3-1762152.pdf> Ohmite B20 <https://www.ohmite.com/assets/docs/res_200.pdf?r=false>; DKPN: 10-ERJ-UP3F2001VTR-ND; MANUFACTURER: Panasonic Electronic Components; MOPN: 667-ERJ-UP3F2001V; MPN: ERJ-UP3F2001V; POWER: 0.25W; RESISTANCE: 2k; TOLERANCE: 1%; VOLTAGE_CONTINUOUS: 22.36V; VOLTAGE_MAX: 150V
R26 R29 R31 R50 = HyTechDevices:RESISTOR_?_*: Resistor PWR163 Series <https://www.mouser.com/datasheet/2/54/pwr163-777985.pdf> AC Series <https://www.mouser.com/datasheet/2/447/Yageo_PYu_AC_51_RoHS_L_7_1714230-1874691.pdf> PU Series <https://www.mouser.com/datasheet/2/447/PYu-PU_51_RoHS_L_6-1504619.pdf> UCR Series <https://fscdn.rohm.com/en/products/databook/datasheet/passive/resistor/chip_resistor/ucr-e.pdf> ERA Series <https://www.mouser.com/datasheet/2/315/AOA0000C307-1149632.pdf> PWR263 Series <https://www.mouser.com/datasheet/2/54/pwr263s_35-778069.pdf> KTR Series <https://www.mouser.com/datasheet/2/348/ROHM_S_A0011075115_1-2563276.pdf> RC Series <https://www.mouser.com/datasheet/2/447/Yageo_03_18_2021_PYu_RC_Group_51_RoHS_L_11-2199992.pdf> ERJ Low Resistance Series <https://www.mouser.com/datasheet/2/315/AOA0000C313-1141758.pdf> ERJ PB3, PB6 Series <https://www.mouser.com/datasheet/2/315/AOA0000C328-1530132.pdf> ERJ PA2, P03, PA3, P06, P08, P14 Series <https://www.mouser.com/datasheet/2/315/AOA0000C331-1141874.pdf> B20 Series <https://www.ohmite.com/assets/docs/res_200.pdf?r=false> TE Connectivity/Holsworthy RN73 Series <https://www.mouser.com/datasheet/2/418/4/NG_DS_1773270_M-604713.pdf> Vishay Dale D/CRCW e3 <https://www.mouser.com/datasheet/2/427/dcrcwe3-1762152.pdf> Ohmite B20 <https://www.ohmite.com/assets/docs/res_200.pdf?r=false>; DKPN: 1712-CPF-A-0603B1K0ETR-ND; MANUFACTURER: TE Connectivity Passive Product; MOPN: 279-CPF-A-0603B1K0E; MPN: CPF-A-0603B1K0E; POWER: 0.0625W; RESISTANCE: 1k; TOLERANCE: 0.1%; VOLTAGE_CONTINUOUS: 7.9V; VOLTAGE_MAX: 50V
R28 = HyTechDevices:RESISTOR_?_*: Resistor PWR163 Series <https://www.mouser.com/datasheet/2/54/pwr163-777985.pdf> AC Series <https://www.mouser.com/datasheet/2/447/Yageo_PYu_AC_51_RoHS_L_7_1714230-1874691.pdf> PU Series <https://www.mouser.com/datasheet/2/447/PYu-PU_51_RoHS_L_6-1504619.pdf> UCR Series <https://fscdn.rohm.com/en/products/databook/datasheet/passive/resistor/chip_resistor/ucr-e.pdf> ERA Series <https://www.mouser.com/datasheet/2/315/AOA0000C307-1149632.pdf> PWR263 Series <https://www.mouser.com/datasheet/2/54/pwr263s_35-778069.pdf> KTR Series <https://www.mouser.com/datasheet/2/348/ROHM_S_A0011075115_1-2563276.pdf> RC Series <https://www.mouser.com/datasheet/2/447/Yageo_03_18_2021_PYu_RC_Group_51_RoHS_L_11-2199992.pdf> ERJ Low Resistance Series <https://www.mouser.com/datasheet/2/315/AOA0000C313-1141758.pdf> ERJ PB3, PB6 Series <https://www.mouser.com/datasheet/2/315/AOA0000C328-1530132.pdf> ERJ PA2, P03, PA3, P06, P08, P14 Series <https://www.mouser.com/datasheet/2/315/AOA0000C331-1141874.pdf> B20 Series <https://www.ohmite.com/assets/docs/res_200.pdf?r=false> TE Connectivity/Holsworthy RN73 Series <https://www.mouser.com/datasheet/2/418/4/NG_DS_1773270_M-604713.pdf> Vishay Dale D/CRCW e3 <https://www.mouser.com/datasheet/2/427/dcrcwe3-1762152.pdf> Ohmite B20 <https://www.ohmite.com/assets/docs/res_200.pdf?r=false>; DKPN: P10KBDCT-ND; MANUFACTURER: Panasonic Electronic Components; MOPN: 667-ERA-3ARB103V; MPN: ERA-3ARB103V; POWER: 0.1W; RESISTANCE: 10k; TOLERANCE: 0.1%; VOLTAGE_CONTINUOUS: 31.62V; VOLTAGE_MAX: 75V
R30 = HyTechDevices:RESISTOR_?_*: Resistor PWR163 Series <https://www.mouser.com/datasheet/2/54/pwr163-777985.pdf> AC Series <https://www.mouser.com/datasheet/2/447/Yageo_PYu_AC_51_RoHS_L_7_1714230-1874691.pdf> PU Series <https://www.mouser.com/datasheet/2/447/PYu-PU_51_RoHS_L_6-1504619.pdf> UCR Series <https://fscdn.rohm.com/en/products/databook/datasheet/passive/resistor/chip_resistor/ucr-e.pdf> ERA Series <https://www.mouser.com/datasheet/2/315/AOA0000C307-1149632.pdf> PWR263 Series <https://www.mouser.com/datasheet/2/54/pwr263s_35-778069.pdf> KTR Series <https://www.mouser.com/datasheet/2/348/ROHM_S_A0011075115_1-2563276.pdf> RC Series <https://www.mouser.com/datasheet/2/447/Yageo_03_18_2021_PYu_RC_Group_51_RoHS_L_11-2199992.pdf> ERJ Low Resistance Series <https://www.mouser.com/datasheet/2/315/AOA0000C313-1141758.pdf> ERJ PB3, PB6 Series <https://www.mouser.com/datasheet/2/315/AOA0000C328-1530132.pdf> ERJ PA2, P03, PA3, P06, P08, P14 Series <https://www.mouser.com/datasheet/2/315/AOA0000C331-1141874.pdf> B20 Series <https://www.ohmite.com/assets/docs/res_200.pdf?r=false> TE Connectivity/Holsworthy RN73 Series <https://www.mouser.com/datasheet/2/418/4/NG_DS_1773270_M-604713.pdf> Vishay Dale D/CRCW e3 <https://www.mouser.com/datasheet/2/427/dcrcwe3-1762152.pdf> Ohmite B20 <https://www.ohmite.com/assets/docs/res_200.pdf?r=false>; DKPN: P20340TR-ND; MANUFACTURER: Panasonic Electronic Components; MOPN: 667-ERJ-PB3D3301V; MPN: ERJ-PB3D3301V; POWER: 0.3W; RESISTANCE: 3.3k; TOLERANCE: 0.5%; VOLTAGE_CONTINUOUS: 25.69V; VOLTAGE_MAX: 150
R32 = HyTechDevices:RESISTOR_?_*: Resistor PWR163 Series <https://www.mouser.com/datasheet/2/54/pwr163-777985.pdf> AC Series <https://www.mouser.com/datasheet/2/447/Yageo_PYu_AC_51_RoHS_L_7_1714230-1874691.pdf> PU Series <https://www.mouser.com/datasheet/2/447/PYu-PU_51_RoHS_L_6-1504619.pdf> UCR Series <https://fscdn.rohm.com/en/products/databook/datasheet/passive/resistor/chip_resistor/ucr-e.pdf> ERA Series <https://www.mouser.com/datasheet/2/315/AOA0000C307-1149632.pdf> PWR263 Series <https://www.mouser.com/datasheet/2/54/pwr263s_35-778069.pdf> KTR Series <https://www.mouser.com/datasheet/2/348/ROHM_S_A0011075115_1-2563276.pdf> RC Series <https://www.mouser.com/datasheet/2/447/Yageo_03_18_2021_PYu_RC_Group_51_RoHS_L_11-2199992.pdf> ERJ Low Resistance Series <https://www.mouser.com/datasheet/2/315/AOA0000C313-1141758.pdf> ERJ PB3, PB6 Series <https://www.mouser.com/datasheet/2/315/AOA0000C328-1530132.pdf> ERJ PA2, P03, PA3, P06, P08, P14 Series <https://www.mouser.com/datasheet/2/315/AOA0000C331-1141874.pdf> B20 Series <https://www.ohmite.com/assets/docs/res_200.pdf?r=false> TE Connectivity/Holsworthy RN73 Series <https://www.mouser.com/datasheet/2/418/4/NG_DS_1773270_M-604713.pdf> Vishay Dale D/CRCW e3 <https://www.mouser.com/datasheet/2/427/dcrcwe3-1762152.pdf> Ohmite B20 <https://www.ohmite.com/assets/docs/res_200.pdf?r=false>; DKPN: RT0603BRE0775KL-ND; MANUFACTURER: Yageo; MOPN: 603-RT0603BRE0775KL; MPN: RT0603BRE0775KL; POWER: 0.1W; RESISTANCE: 75k; TOLERANCE: 0.1%; VOLTAGE_CONTINUOUS: 75V; VOLTAGE_MAX: 75V
R33 = HyTechDevices:RESISTOR_?_*: Resistor PWR163 Series <https://www.mouser.com/datasheet/2/54/pwr163-777985.pdf> AC Series <https://www.mouser.com/datasheet/2/447/Yageo_PYu_AC_51_RoHS_L_7_1714230-1874691.pdf> PU Series <https://www.mouser.com/datasheet/2/447/PYu-PU_51_RoHS_L_6-1504619.pdf> UCR Series <https://fscdn.rohm.com/en/products/databook/datasheet/passive/resistor/chip_resistor/ucr-e.pdf> ERA Series <https://www.mouser.com/datasheet/2/315/AOA0000C307-1149632.pdf> PWR263 Series <https://www.mouser.com/datasheet/2/54/pwr263s_35-778069.pdf> KTR Series <https://www.mouser.com/datasheet/2/348/ROHM_S_A0011075115_1-2563276.pdf> RC Series <https://www.mouser.com/datasheet/2/447/Yageo_03_18_2021_PYu_RC_Group_51_RoHS_L_11-2199992.pdf> ERJ Low Resistance Series <https://www.mouser.com/datasheet/2/315/AOA0000C313-1141758.pdf> ERJ PB3, PB6 Series <https://www.mouser.com/datasheet/2/315/AOA0000C328-1530132.pdf> ERJ PA2, P03, PA3, P06, P08, P14 Series <https://www.mouser.com/datasheet/2/315/AOA0000C331-1141874.pdf> B20 Series <https://www.ohmite.com/assets/docs/res_200.pdf?r=false> TE Connectivity/Holsworthy RN73 Series <https://www.mouser.com/datasheet/2/418/4/NG_DS_1773270_M-604713.pdf> Vishay Dale D/CRCW e3 <https://www.mouser.com/datasheet/2/427/dcrcwe3-1762152.pdf> Ohmite B20 <https://www.ohmite.com/assets/docs/res_200.pdf?r=false>; DKPN: 311-10.0HRCT-ND; MANUFACTURER: Yageo; MOPN: 603-RC0603FR-0710RL; MPN: RC0603FR-0710RL; POWER: 0.1W; RESISTANCE: 10; TOLERANCE: 1%; VOLTAGE_CONTINUOUS: 1.00V; VOLTAGE_MAX: 75V
R34 = HyTechDevices:RESISTOR_?_*: Resistor PWR163 Series <https://www.mouser.com/datasheet/2/54/pwr163-777985.pdf> AC Series <https://www.mouser.com/datasheet/2/447/Yageo_PYu_AC_51_RoHS_L_7_1714230-1874691.pdf> PU Series <https://www.mouser.com/datasheet/2/447/PYu-PU_51_RoHS_L_6-1504619.pdf> UCR Series <https://fscdn.rohm.com/en/products/databook/datasheet/passive/resistor/chip_resistor/ucr-e.pdf> ERA Series <https://www.mouser.com/datasheet/2/315/AOA0000C307-1149632.pdf> PWR263 Series <https://www.mouser.com/datasheet/2/54/pwr263s_35-778069.pdf> KTR Series <https://www.mouser.com/datasheet/2/348/ROHM_S_A0011075115_1-2563276.pdf> RC Series <https://www.mouser.com/datasheet/2/447/Yageo_03_18_2021_PYu_RC_Group_51_RoHS_L_11-2199992.pdf> ERJ Low Resistance Series <https://www.mouser.com/datasheet/2/315/AOA0000C313-1141758.pdf> ERJ PB3, PB6 Series <https://www.mouser.com/datasheet/2/315/AOA0000C328-1530132.pdf> ERJ PA2, P03, PA3, P06, P08, P14 Series <https://www.mouser.com/datasheet/2/315/AOA0000C331-1141874.pdf> B20 Series <https://www.ohmite.com/assets/docs/res_200.pdf?r=false> TE Connectivity/Holsworthy RN73 Series <https://www.mouser.com/datasheet/2/418/4/NG_DS_1773270_M-604713.pdf> Vishay Dale D/CRCW e3 <https://www.mouser.com/datasheet/2/427/dcrcwe3-1762152.pdf> Ohmite B20 <https://www.ohmite.com/assets/docs/res_200.pdf?r=false>; DKPN: P20936TR-ND; MANUFACTURER: Panasonic Electronic Components; MOPN: 667-ERJ-PB6B1004V; MPN: ERJ-PB6B1004V; POWER: 0.25W; RESISTANCE: 1M; TOLERANCE: 0.1%; VOLTAGE_CONTINUOUS: 150V; VOLTAGE_MAX: 150V
R35 = HyTechDevices:RESISTOR_?_*: Resistor PWR163 Series <https://www.mouser.com/datasheet/2/54/pwr163-777985.pdf> AC Series <https://www.mouser.com/datasheet/2/447/Yageo_PYu_AC_51_RoHS_L_7_1714230-1874691.pdf> PU Series <https://www.mouser.com/datasheet/2/447/PYu-PU_51_RoHS_L_6-1504619.pdf> UCR Series <https://fscdn.rohm.com/en/products/databook/datasheet/passive/resistor/chip_resistor/ucr-e.pdf> ERA Series <https://www.mouser.com/datasheet/2/315/AOA0000C307-1149632.pdf> PWR263 Series <https://www.mouser.com/datasheet/2/54/pwr263s_35-778069.pdf> KTR Series <https://www.mouser.com/datasheet/2/348/ROHM_S_A0011075115_1-2563276.pdf> RC Series <https://www.mouser.com/datasheet/2/447/Yageo_03_18_2021_PYu_RC_Group_51_RoHS_L_11-2199992.pdf> ERJ Low Resistance Series <https://www.mouser.com/datasheet/2/315/AOA0000C313-1141758.pdf> ERJ PB3, PB6 Series <https://www.mouser.com/datasheet/2/315/AOA0000C328-1530132.pdf> ERJ PA2, P03, PA3, P06, P08, P14 Series <https://www.mouser.com/datasheet/2/315/AOA0000C331-1141874.pdf> B20 Series <https://www.ohmite.com/assets/docs/res_200.pdf?r=false> TE Connectivity/Holsworthy RN73 Series <https://www.mouser.com/datasheet/2/418/4/NG_DS_1773270_M-604713.pdf> Vishay Dale D/CRCW e3 <https://www.mouser.com/datasheet/2/427/dcrcwe3-1762152.pdf> Ohmite B20 <https://www.ohmite.com/assets/docs/res_200.pdf?r=false>; DKPN: P20904TR-ND; MANUFACTURER: Panasonic Electronic Components; MOPN: 667-ERJ-PB6B5233V; MPN: ERJ-PB6B5233V; POWER: 0.25W; RESISTANCE: 523k; TOLERANCE: 0.1%; VOLTAGE_CONTINUOUS: 150V; VOLTAGE_MAX: 150V
R40 = HyTechDevices:RESISTOR_?_*: Resistor PWR163 Series <https://www.mouser.com/datasheet/2/54/pwr163-777985.pdf> AC Series <https://www.mouser.com/datasheet/2/447/Yageo_PYu_AC_51_RoHS_L_7_1714230-1874691.pdf> PU Series <https://www.mouser.com/datasheet/2/447/PYu-PU_51_RoHS_L_6-1504619.pdf> UCR Series <https://fscdn.rohm.com/en/products/databook/datasheet/passive/resistor/chip_resistor/ucr-e.pdf> ERA Series <https://www.mouser.com/datasheet/2/315/AOA0000C307-1149632.pdf> PWR263 Series <https://www.mouser.com/datasheet/2/54/pwr263s_35-778069.pdf> KTR Series <https://www.mouser.com/datasheet/2/348/ROHM_S_A0011075115_1-2563276.pdf> RC Series <https://www.mouser.com/datasheet/2/447/Yageo_03_18_2021_PYu_RC_Group_51_RoHS_L_11-2199992.pdf> ERJ Low Resistance Series <https://www.mouser.com/datasheet/2/315/AOA0000C313-1141758.pdf> ERJ PB3, PB6 Series <https://www.mouser.com/datasheet/2/315/AOA0000C328-1530132.pdf> ERJ PA2, P03, PA3, P06, P08, P14 Series <https://www.mouser.com/datasheet/2/315/AOA0000C331-1141874.pdf> B20 Series <https://www.ohmite.com/assets/docs/res_200.pdf?r=false> TE Connectivity/Holsworthy RN73 Series <https://www.mouser.com/datasheet/2/418/4/NG_DS_1773270_M-604713.pdf> Vishay Dale D/CRCW e3 <https://www.mouser.com/datasheet/2/427/dcrcwe3-1762152.pdf> Ohmite B20 <https://www.ohmite.com/assets/docs/res_200.pdf?r=false>; DKPN: P22.1KDBCT-ND; MANUFACTURER: Panasonic Electronic Components; MOPN: 667-ERA-3AEB2212V; MPN: ERA-3AEB2212V; POWER: 0.1W; RESISTANCE: 22.1k; TOLERANCE: 0.1%; VOLTAGE_CONTINUOUS: 47.01V; VOLTAGE_MAX: 75V
R41 = HyTechDevices:RESISTOR_?_*: Resistor PWR163 Series <https://www.mouser.com/datasheet/2/54/pwr163-777985.pdf> AC Series <https://www.mouser.com/datasheet/2/447/Yageo_PYu_AC_51_RoHS_L_7_1714230-1874691.pdf> PU Series <https://www.mouser.com/datasheet/2/447/PYu-PU_51_RoHS_L_6-1504619.pdf> UCR Series <https://fscdn.rohm.com/en/products/databook/datasheet/passive/resistor/chip_resistor/ucr-e.pdf> ERA Series <https://www.mouser.com/datasheet/2/315/AOA0000C307-1149632.pdf> PWR263 Series <https://www.mouser.com/datasheet/2/54/pwr263s_35-778069.pdf> KTR Series <https://www.mouser.com/datasheet/2/348/ROHM_S_A0011075115_1-2563276.pdf> RC Series <https://www.mouser.com/datasheet/2/447/Yageo_03_18_2021_PYu_RC_Group_51_RoHS_L_11-2199992.pdf> ERJ Low Resistance Series <https://www.mouser.com/datasheet/2/315/AOA0000C313-1141758.pdf> ERJ PB3, PB6 Series <https://www.mouser.com/datasheet/2/315/AOA0000C328-1530132.pdf> ERJ PA2, P03, PA3, P06, P08, P14 Series <https://www.mouser.com/datasheet/2/315/AOA0000C331-1141874.pdf> B20 Series <https://www.ohmite.com/assets/docs/res_200.pdf?r=false> TE Connectivity/Holsworthy RN73 Series <https://www.mouser.com/datasheet/2/418/4/NG_DS_1773270_M-604713.pdf> Vishay Dale D/CRCW e3 <https://www.mouser.com/datasheet/2/427/dcrcwe3-1762152.pdf> Ohmite B20 <https://www.ohmite.com/assets/docs/res_200.pdf?r=false>; DKPN: RHM330KAHTR-ND; MANUFACTURER: Rohm Semiconductor; MOPN: 755-KTR10EZPF3303; MPN: KTR10EZPF3303; POWER: 0.125W; RESISTANCE: 330k; TOLERANCE: 1%; VOLTAGE_CONTINUOUS: 203.1V; VOLTAGE_MAX: 400V
R45 R46 R52 R53 R57 R58 = HyTechDevices:RESISTOR_?_*: Resistor PWR163 Series <https://www.mouser.com/datasheet/2/54/pwr163-777985.pdf> AC Series <https://www.mouser.com/datasheet/2/447/Yageo_PYu_AC_51_RoHS_L_7_1714230-1874691.pdf> PU Series <https://www.mouser.com/datasheet/2/447/PYu-PU_51_RoHS_L_6-1504619.pdf> UCR Series <https://fscdn.rohm.com/en/products/databook/datasheet/passive/resistor/chip_resistor/ucr-e.pdf> ERA Series <https://www.mouser.com/datasheet/2/315/AOA0000C307-1149632.pdf> PWR263 Series <https://www.mouser.com/datasheet/2/54/pwr263s_35-778069.pdf> KTR Series <https://www.mouser.com/datasheet/2/348/ROHM_S_A0011075115_1-2563276.pdf> RC Series <https://www.mouser.com/datasheet/2/447/Yageo_03_18_2021_PYu_RC_Group_51_RoHS_L_11-2199992.pdf> ERJ Low Resistance Series <https://www.mouser.com/datasheet/2/315/AOA0000C313-1141758.pdf> ERJ PB3, PB6 Series <https://www.mouser.com/datasheet/2/315/AOA0000C328-1530132.pdf> ERJ PA2, P03, PA3, P06, P08, P14 Series <https://www.mouser.com/datasheet/2/315/AOA0000C331-1141874.pdf> B20 Series <https://www.ohmite.com/assets/docs/res_200.pdf?r=false> TE Connectivity/Holsworthy RN73 Series <https://www.mouser.com/datasheet/2/418/4/NG_DS_1773270_M-604713.pdf> Vishay Dale D/CRCW e3 <https://www.mouser.com/datasheet/2/427/dcrcwe3-1762152.pdf> Ohmite B20 <https://www.ohmite.com/assets/docs/res_200.pdf?r=false>; DKPN: RHM365KAHTR-ND; MANUFACTURER: Rohm; MOPN: 755-KTR10EZPF3653; MPN: KTR10EZPF3653; POWER: 0.125W; RESISTANCE: 365k; TOLERANCE: 1%; VOLTAGE_CONTINUOUS: 213V; VOLTAGE_MAX: 350V
R47 R48 = HyTechDevices:RESISTOR_?_*: Resistor PWR163 Series <https://www.mouser.com/datasheet/2/54/pwr163-777985.pdf> AC Series <https://www.mouser.com/datasheet/2/447/Yageo_PYu_AC_51_RoHS_L_7_1714230-1874691.pdf> PU Series <https://www.mouser.com/datasheet/2/447/PYu-PU_51_RoHS_L_6-1504619.pdf> UCR Series <https://fscdn.rohm.com/en/products/databook/datasheet/passive/resistor/chip_resistor/ucr-e.pdf> ERA Series <https://www.mouser.com/datasheet/2/315/AOA0000C307-1149632.pdf> PWR263 Series <https://www.mouser.com/datasheet/2/54/pwr263s_35-778069.pdf> KTR Series <https://www.mouser.com/datasheet/2/348/ROHM_S_A0011075115_1-2563276.pdf> RC Series <https://www.mouser.com/datasheet/2/447/Yageo_03_18_2021_PYu_RC_Group_51_RoHS_L_11-2199992.pdf> ERJ Low Resistance Series <https://www.mouser.com/datasheet/2/315/AOA0000C313-1141758.pdf> ERJ PB3, PB6 Series <https://www.mouser.com/datasheet/2/315/AOA0000C328-1530132.pdf> ERJ PA2, P03, PA3, P06, P08, P14 Series <https://www.mouser.com/datasheet/2/315/AOA0000C331-1141874.pdf> B20 Series <https://www.ohmite.com/assets/docs/res_200.pdf?r=false> TE Connectivity/Holsworthy RN73 Series <https://www.mouser.com/datasheet/2/418/4/NG_DS_1773270_M-604713.pdf> Vishay Dale D/CRCW e3 <https://www.mouser.com/datasheet/2/427/dcrcwe3-1762152.pdf> Ohmite B20 <https://www.ohmite.com/assets/docs/res_200.pdf?r=false>; DKPN: RHM46.4KAICT-ND; MANUFACTURER: Rohm Semiconductor; MOPN: 755-KTR18EZPF4642; MPN: KTR18EZPF4642; POWER: 0.25W; RESISTANCE: 46.4k; TOLERANCE: 1%; VOLTAGE_CONTINUOUS: 107.7V; VOLTAGE_MAX: 500V
R49 = HyTechDevices:RESISTOR_?_*: Resistor PWR163 Series <https://www.mouser.com/datasheet/2/54/pwr163-777985.pdf> AC Series <https://www.mouser.com/datasheet/2/447/Yageo_PYu_AC_51_RoHS_L_7_1714230-1874691.pdf> PU Series <https://www.mouser.com/datasheet/2/447/PYu-PU_51_RoHS_L_6-1504619.pdf> UCR Series <https://fscdn.rohm.com/en/products/databook/datasheet/passive/resistor/chip_resistor/ucr-e.pdf> ERA Series <https://www.mouser.com/datasheet/2/315/AOA0000C307-1149632.pdf> PWR263 Series <https://www.mouser.com/datasheet/2/54/pwr263s_35-778069.pdf> KTR Series <https://www.mouser.com/datasheet/2/348/ROHM_S_A0011075115_1-2563276.pdf> RC Series <https://www.mouser.com/datasheet/2/447/Yageo_03_18_2021_PYu_RC_Group_51_RoHS_L_11-2199992.pdf> ERJ Low Resistance Series <https://www.mouser.com/datasheet/2/315/AOA0000C313-1141758.pdf> ERJ PB3, PB6 Series <https://www.mouser.com/datasheet/2/315/AOA0000C328-1530132.pdf> ERJ PA2, P03, PA3, P06, P08, P14 Series <https://www.mouser.com/datasheet/2/315/AOA0000C331-1141874.pdf> B20 Series <https://www.ohmite.com/assets/docs/res_200.pdf?r=false> TE Connectivity/Holsworthy RN73 Series <https://www.mouser.com/datasheet/2/418/4/NG_DS_1773270_M-604713.pdf> Vishay Dale D/CRCW e3 <https://www.mouser.com/datasheet/2/427/dcrcwe3-1762152.pdf> Ohmite B20 <https://www.ohmite.com/assets/docs/res_200.pdf?r=false>; DKPN: P5.9KDBCT-ND; MANUFACTURER: Panasonic Electronic Components; MOPN: 667-ERA-3AEB5901V; MPN: ERA-3AEB5901V; POWER: 0.1W; RESISTANCE: 5.9k; TOLERANCE: 0.1%; VOLTAGE_CONTINUOUS: 24.29V; VOLTAGE_MAX: 75V
R51 = HyTechDevices:RESISTOR_?_*: Resistor PWR163 Series <https://www.mouser.com/datasheet/2/54/pwr163-777985.pdf> AC Series <https://www.mouser.com/datasheet/2/447/Yageo_PYu_AC_51_RoHS_L_7_1714230-1874691.pdf> PU Series <https://www.mouser.com/datasheet/2/447/PYu-PU_51_RoHS_L_6-1504619.pdf> UCR Series <https://fscdn.rohm.com/en/products/databook/datasheet/passive/resistor/chip_resistor/ucr-e.pdf> ERA Series <https://www.mouser.com/datasheet/2/315/AOA0000C307-1149632.pdf> PWR263 Series <https://www.mouser.com/datasheet/2/54/pwr263s_35-778069.pdf> KTR Series <https://www.mouser.com/datasheet/2/348/ROHM_S_A0011075115_1-2563276.pdf> RC Series <https://www.mouser.com/datasheet/2/447/Yageo_03_18_2021_PYu_RC_Group_51_RoHS_L_11-2199992.pdf> ERJ Low Resistance Series <https://www.mouser.com/datasheet/2/315/AOA0000C313-1141758.pdf> ERJ PB3, PB6 Series <https://www.mouser.com/datasheet/2/315/AOA0000C328-1530132.pdf> ERJ PA2, P03, PA3, P06, P08, P14 Series <https://www.mouser.com/datasheet/2/315/AOA0000C331-1141874.pdf> B20 Series <https://www.ohmite.com/assets/docs/res_200.pdf?r=false> TE Connectivity/Holsworthy RN73 Series <https://www.mouser.com/datasheet/2/418/4/NG_DS_1773270_M-604713.pdf> Vishay Dale D/CRCW e3 <https://www.mouser.com/datasheet/2/427/dcrcwe3-1762152.pdf> Ohmite B20 <https://www.ohmite.com/assets/docs/res_200.pdf?r=false>; DKPN: RHM1241CT-ND; MANUFACTURER: Rohm Semiconductor; MOPN: 755-UCR03EVPFLR120; MPN: UCR03EVPFLR120; POWER: 0.25W; RESISTANCE: 0.12; TOLERANCE: 1%; VOLTAGE_CONTINUOUS: 0.173V
R54 R59 = HyTechDevices:RESISTOR_?_*: Resistor PWR163 Series <https://www.mouser.com/datasheet/2/54/pwr163-777985.pdf> AC Series <https://www.mouser.com/datasheet/2/447/Yageo_PYu_AC_51_RoHS_L_7_1714230-1874691.pdf> PU Series <https://www.mouser.com/datasheet/2/447/PYu-PU_51_RoHS_L_6-1504619.pdf> UCR Series <https://fscdn.rohm.com/en/products/databook/datasheet/passive/resistor/chip_resistor/ucr-e.pdf> ERA Series <https://www.mouser.com/datasheet/2/315/AOA0000C307-1149632.pdf> PWR263 Series <https://www.mouser.com/datasheet/2/54/pwr263s_35-778069.pdf> KTR Series <https://www.mouser.com/datasheet/2/348/ROHM_S_A0011075115_1-2563276.pdf> RC Series <https://www.mouser.com/datasheet/2/447/Yageo_03_18_2021_PYu_RC_Group_51_RoHS_L_11-2199992.pdf> ERJ Low Resistance Series <https://www.mouser.com/datasheet/2/315/AOA0000C313-1141758.pdf> ERJ PB3, PB6 Series <https://www.mouser.com/datasheet/2/315/AOA0000C328-1530132.pdf> ERJ PA2, P03, PA3, P06, P08, P14 Series <https://www.mouser.com/datasheet/2/315/AOA0000C331-1141874.pdf> B20 Series <https://www.ohmite.com/assets/docs/res_200.pdf?r=false> TE Connectivity/Holsworthy RN73 Series <https://www.mouser.com/datasheet/2/418/4/NG_DS_1773270_M-604713.pdf> Vishay Dale D/CRCW e3 <https://www.mouser.com/datasheet/2/427/dcrcwe3-1762152.pdf> Ohmite B20 <https://www.ohmite.com/assets/docs/res_200.pdf?r=false>; DKPN: RHM1.00MAHTR-ND; MANUFACTURER: Rohm Semiconductor; MOPN: 755-KTR10EZPF1004; MPN: KTR10EZPF1004; POWER: 0.125W; RESISTANCE: 1M; TOLERANCE: 1%; VOLTAGE_CONTINUOUS: 353.5V; VOLTAGE_MAX: 400V
R55 R60 = HyTechDevices:RESISTOR_?_*: Resistor PWR163 Series <https://www.mouser.com/datasheet/2/54/pwr163-777985.pdf> AC Series <https://www.mouser.com/datasheet/2/447/Yageo_PYu_AC_51_RoHS_L_7_1714230-1874691.pdf> PU Series <https://www.mouser.com/datasheet/2/447/PYu-PU_51_RoHS_L_6-1504619.pdf> UCR Series <https://fscdn.rohm.com/en/products/databook/datasheet/passive/resistor/chip_resistor/ucr-e.pdf> ERA Series <https://www.mouser.com/datasheet/2/315/AOA0000C307-1149632.pdf> PWR263 Series <https://www.mouser.com/datasheet/2/54/pwr263s_35-778069.pdf> KTR Series <https://www.mouser.com/datasheet/2/348/ROHM_S_A0011075115_1-2563276.pdf> RC Series <https://www.mouser.com/datasheet/2/447/Yageo_03_18_2021_PYu_RC_Group_51_RoHS_L_11-2199992.pdf> ERJ Low Resistance Series <https://www.mouser.com/datasheet/2/315/AOA0000C313-1141758.pdf> ERJ PB3, PB6 Series <https://www.mouser.com/datasheet/2/315/AOA0000C328-1530132.pdf> ERJ PA2, P03, PA3, P06, P08, P14 Series <https://www.mouser.com/datasheet/2/315/AOA0000C331-1141874.pdf> B20 Series <https://www.ohmite.com/assets/docs/res_200.pdf?r=false> TE Connectivity/Holsworthy RN73 Series <https://www.mouser.com/datasheet/2/418/4/NG_DS_1773270_M-604713.pdf> Vishay Dale D/CRCW e3 <https://www.mouser.com/datasheet/2/427/dcrcwe3-1762152.pdf> Ohmite B20 <https://www.ohmite.com/assets/docs/res_200.pdf?r=false>; DKPN: RHM3.3KAYTR-ND; MANUFACTURER: Rohm; MOPN: 755-KTR03EZPF3301; MPN: KTR03EZPF3301; POWER: 0.1W; RESISTANCE: 3.3k; TOLERANCE: 1%; VOLTAGE_CONTINUOUS: 18.17V; VOLTAGE_MAX: 350V
R56 R61 = HyTechDevices:RESISTOR_?_*: Resistor PWR163 Series <https://www.mouser.com/datasheet/2/54/pwr163-777985.pdf> AC Series <https://www.mouser.com/datasheet/2/447/Yageo_PYu_AC_51_RoHS_L_7_1714230-1874691.pdf> PU Series <https://www.mouser.com/datasheet/2/447/PYu-PU_51_RoHS_L_6-1504619.pdf> UCR Series <https://fscdn.rohm.com/en/products/databook/datasheet/passive/resistor/chip_resistor/ucr-e.pdf> ERA Series <https://www.mouser.com/datasheet/2/315/AOA0000C307-1149632.pdf> PWR263 Series <https://www.mouser.com/datasheet/2/54/pwr263s_35-778069.pdf> KTR Series <https://www.mouser.com/datasheet/2/348/ROHM_S_A0011075115_1-2563276.pdf> RC Series <https://www.mouser.com/datasheet/2/447/Yageo_03_18_2021_PYu_RC_Group_51_RoHS_L_11-2199992.pdf> ERJ Low Resistance Series <https://www.mouser.com/datasheet/2/315/AOA0000C313-1141758.pdf> ERJ PB3, PB6 Series <https://www.mouser.com/datasheet/2/315/AOA0000C328-1530132.pdf> ERJ PA2, P03, PA3, P06, P08, P14 Series <https://www.mouser.com/datasheet/2/315/AOA0000C331-1141874.pdf> B20 Series <https://www.ohmite.com/assets/docs/res_200.pdf?r=false> TE Connectivity/Holsworthy RN73 Series <https://www.mouser.com/datasheet/2/418/4/NG_DS_1773270_M-604713.pdf> Vishay Dale D/CRCW e3 <https://www.mouser.com/datasheet/2/427/dcrcwe3-1762152.pdf> Ohmite B20 <https://www.ohmite.com/assets/docs/res_200.pdf?r=false>; DKPN: RHM4.99KAICT-ND; MANUFACTURER: Rohm Semiconductor; MOPN: 755-KTR18EZPF4991; MPN: KTR18EZPF4991; POWER: 0.25W; RESISTANCE: 4.99k; TOLERANCE: 1%; VOLTAGE_CONTINUOUS: 35.32V; VOLTAGE_MAX: 500V
U5 = HyTechDevices:RELAY_SOLIDSTATE_NO_*: AQY214EHA Normally Open Solid State Relay Datasheet <https://www.datasheetq.com/datasheet-download/287654/1/Panasonic/AQY214EH> Crydom CMX Series Solid State Normally Open Relay Datasheet <https://www.mouser.com/datasheet/2/657/cmx_series_dc_pcb_mount-1370813.pdf> AB38S-Q Datasheet <https://comus-intl.com/wp-content/uploads/2016/09/AB38S-Q.pdf> CPC1020NTR Datasheet <https://www.mouser.com/datasheet/2/240/CPC1020N-1546163.pdf>; DKPN: 1835-1216-ND; MANUFACTURER: Comus International; MPN: AB38S-Q; VOLTAGE: 600V
U6 = HyTechDevices:LT8315: LT8315 560VIN Micropower No-Opto Isolated Flyback Converter with 630V/300mA Switch Datasheet <https://www.analog.com/media/en/technical-documentation/data-sheets/8315fa.pdf>; DKPN: 505-LT8315HFE#PBF-ND; MANUFACTURER: Analog Devices Inc.; MOPN: 584-LT8315HFEPBF; MPN: LT8315HFE#PBF
U7 U8 = HyTechDevices:AMC3330*: AMC3330 ±1-V input, precision voltage sensing reinforced isolated amplifier with integrated DC/DC Datasheet <https://www.ti.com/lit/gpn/amc3330>; DKPN: 296-AMC3330QDWERQ1TR-ND; MANUFACTURER: Texas Instruments; MOPN: 595-AMC3330QDWERQ1; MPN: AMC3330QDWERQ1
U10 = HyTechDevices:LTC6994-*: Analog Devices Inc Delay IC 1us to 33.6s Datasheet <https://www.mouser.com/datasheet/2/609/LTC6994_1_6994_2-1270043.pdf>

## Board
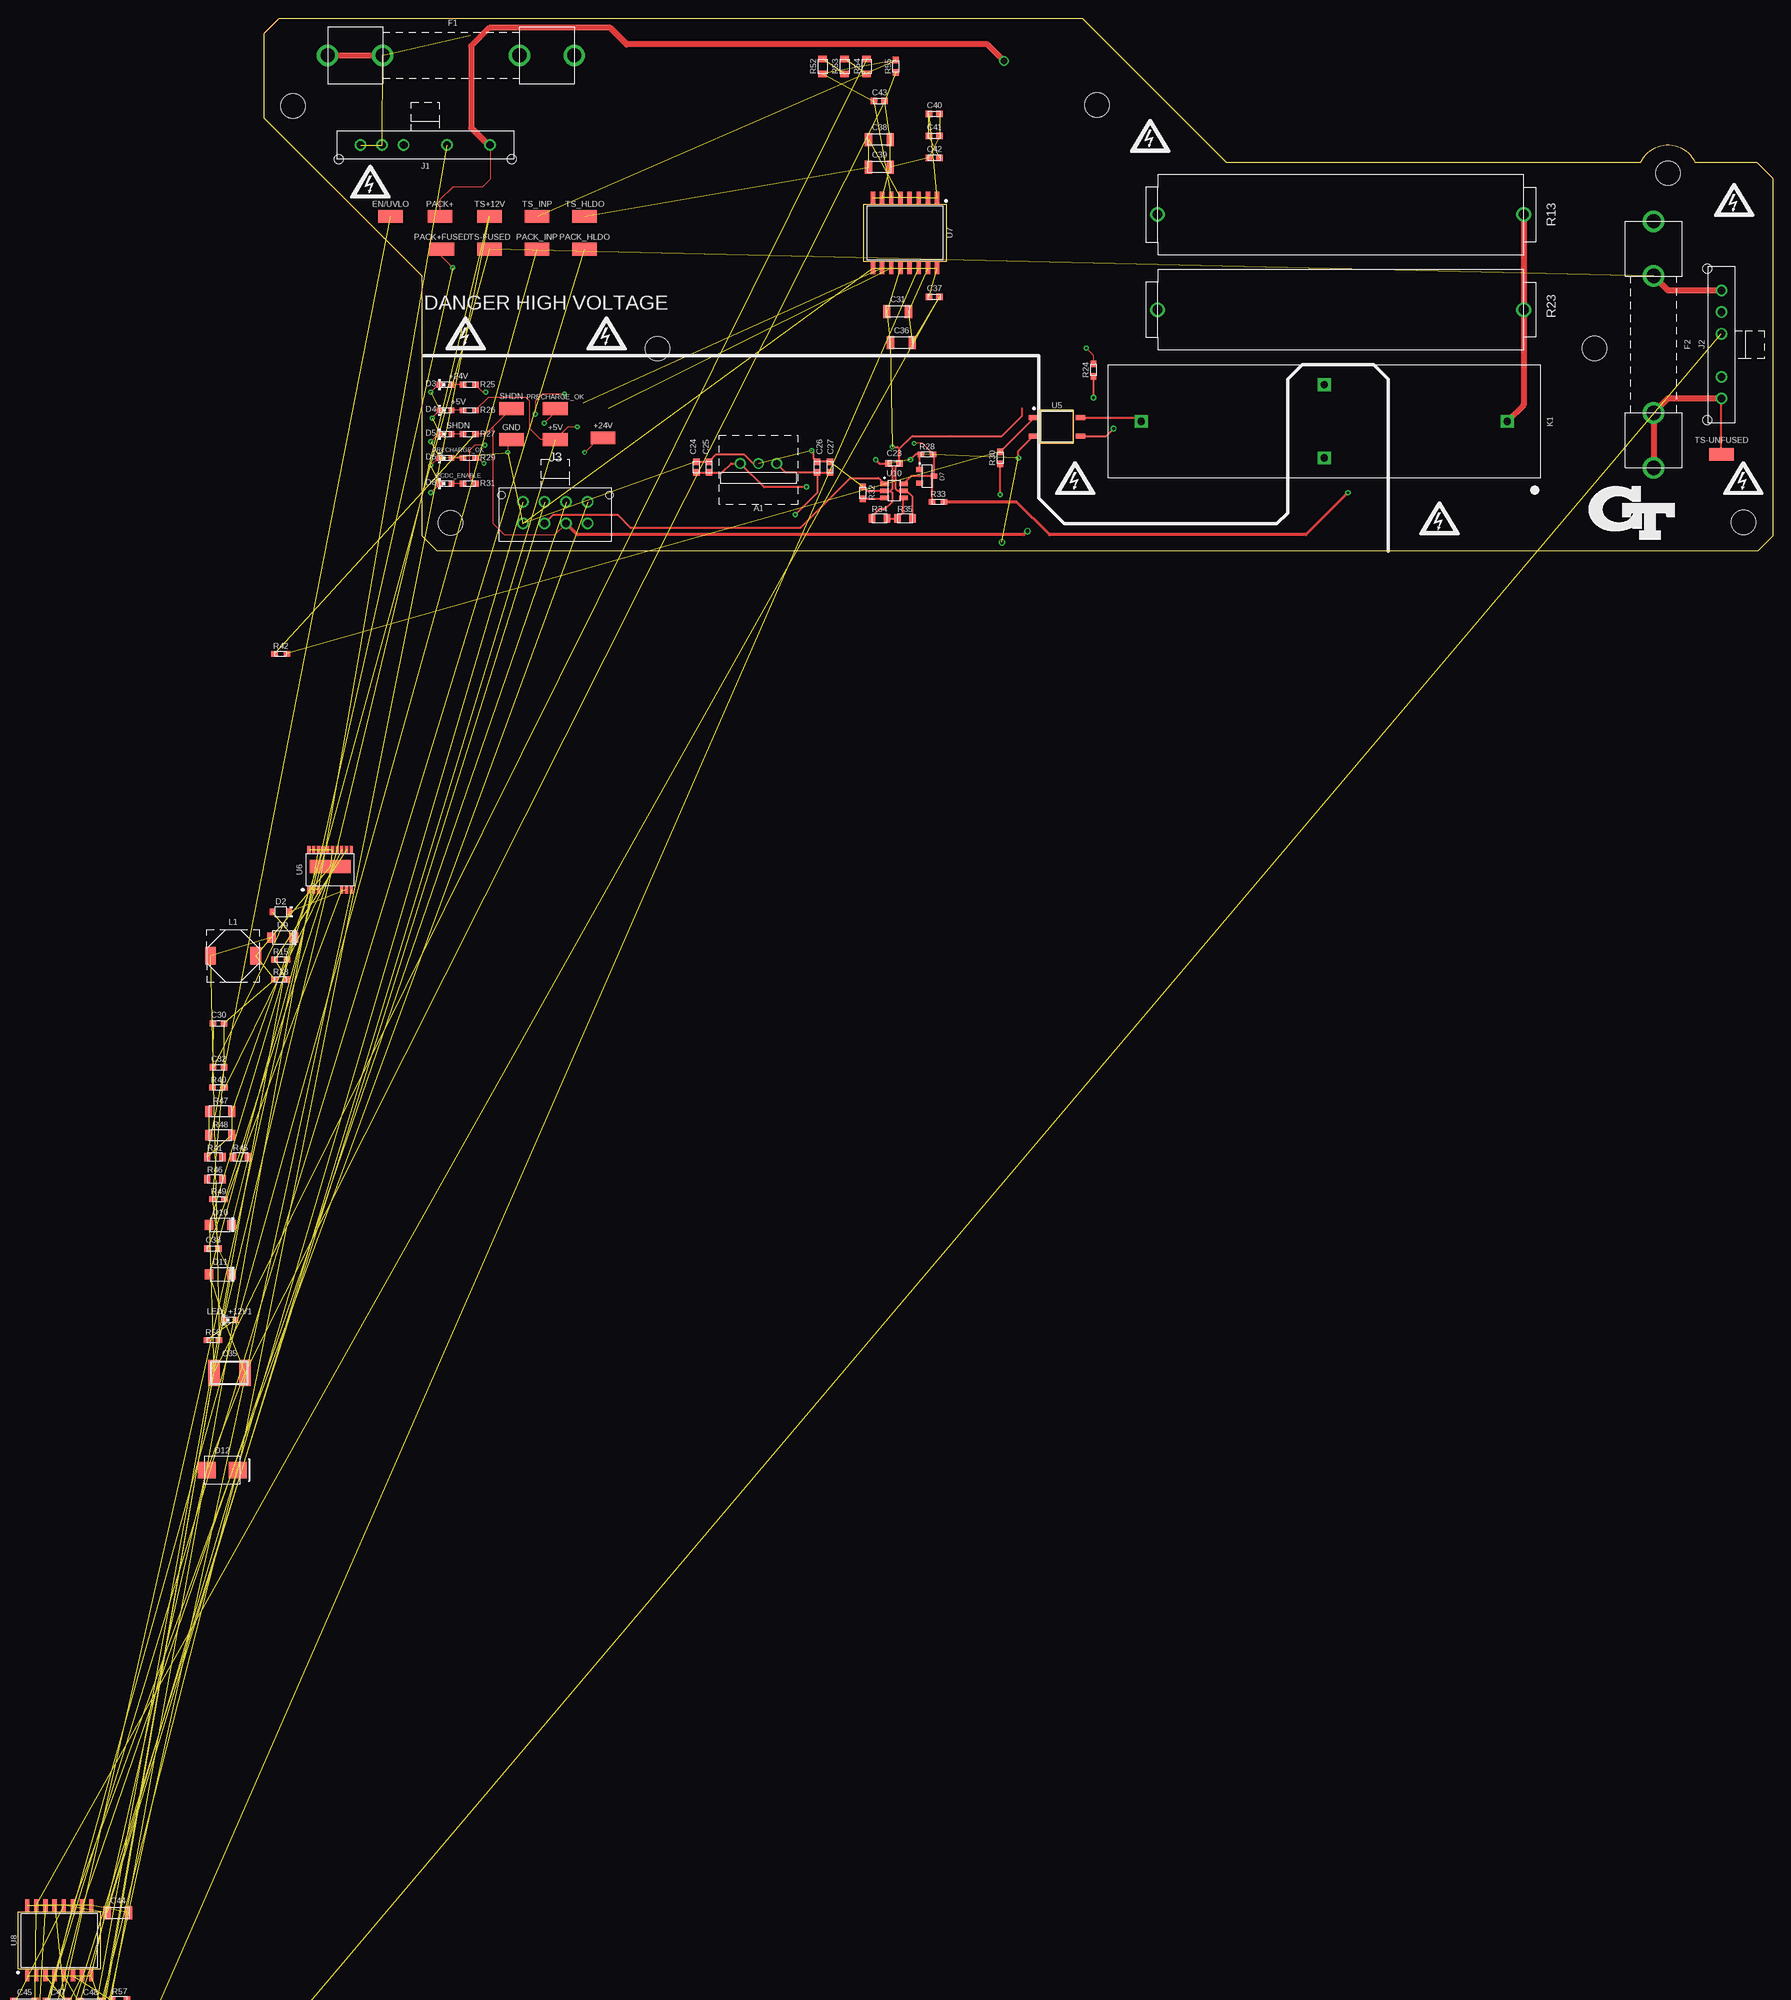
[diagram p3: board, top side]
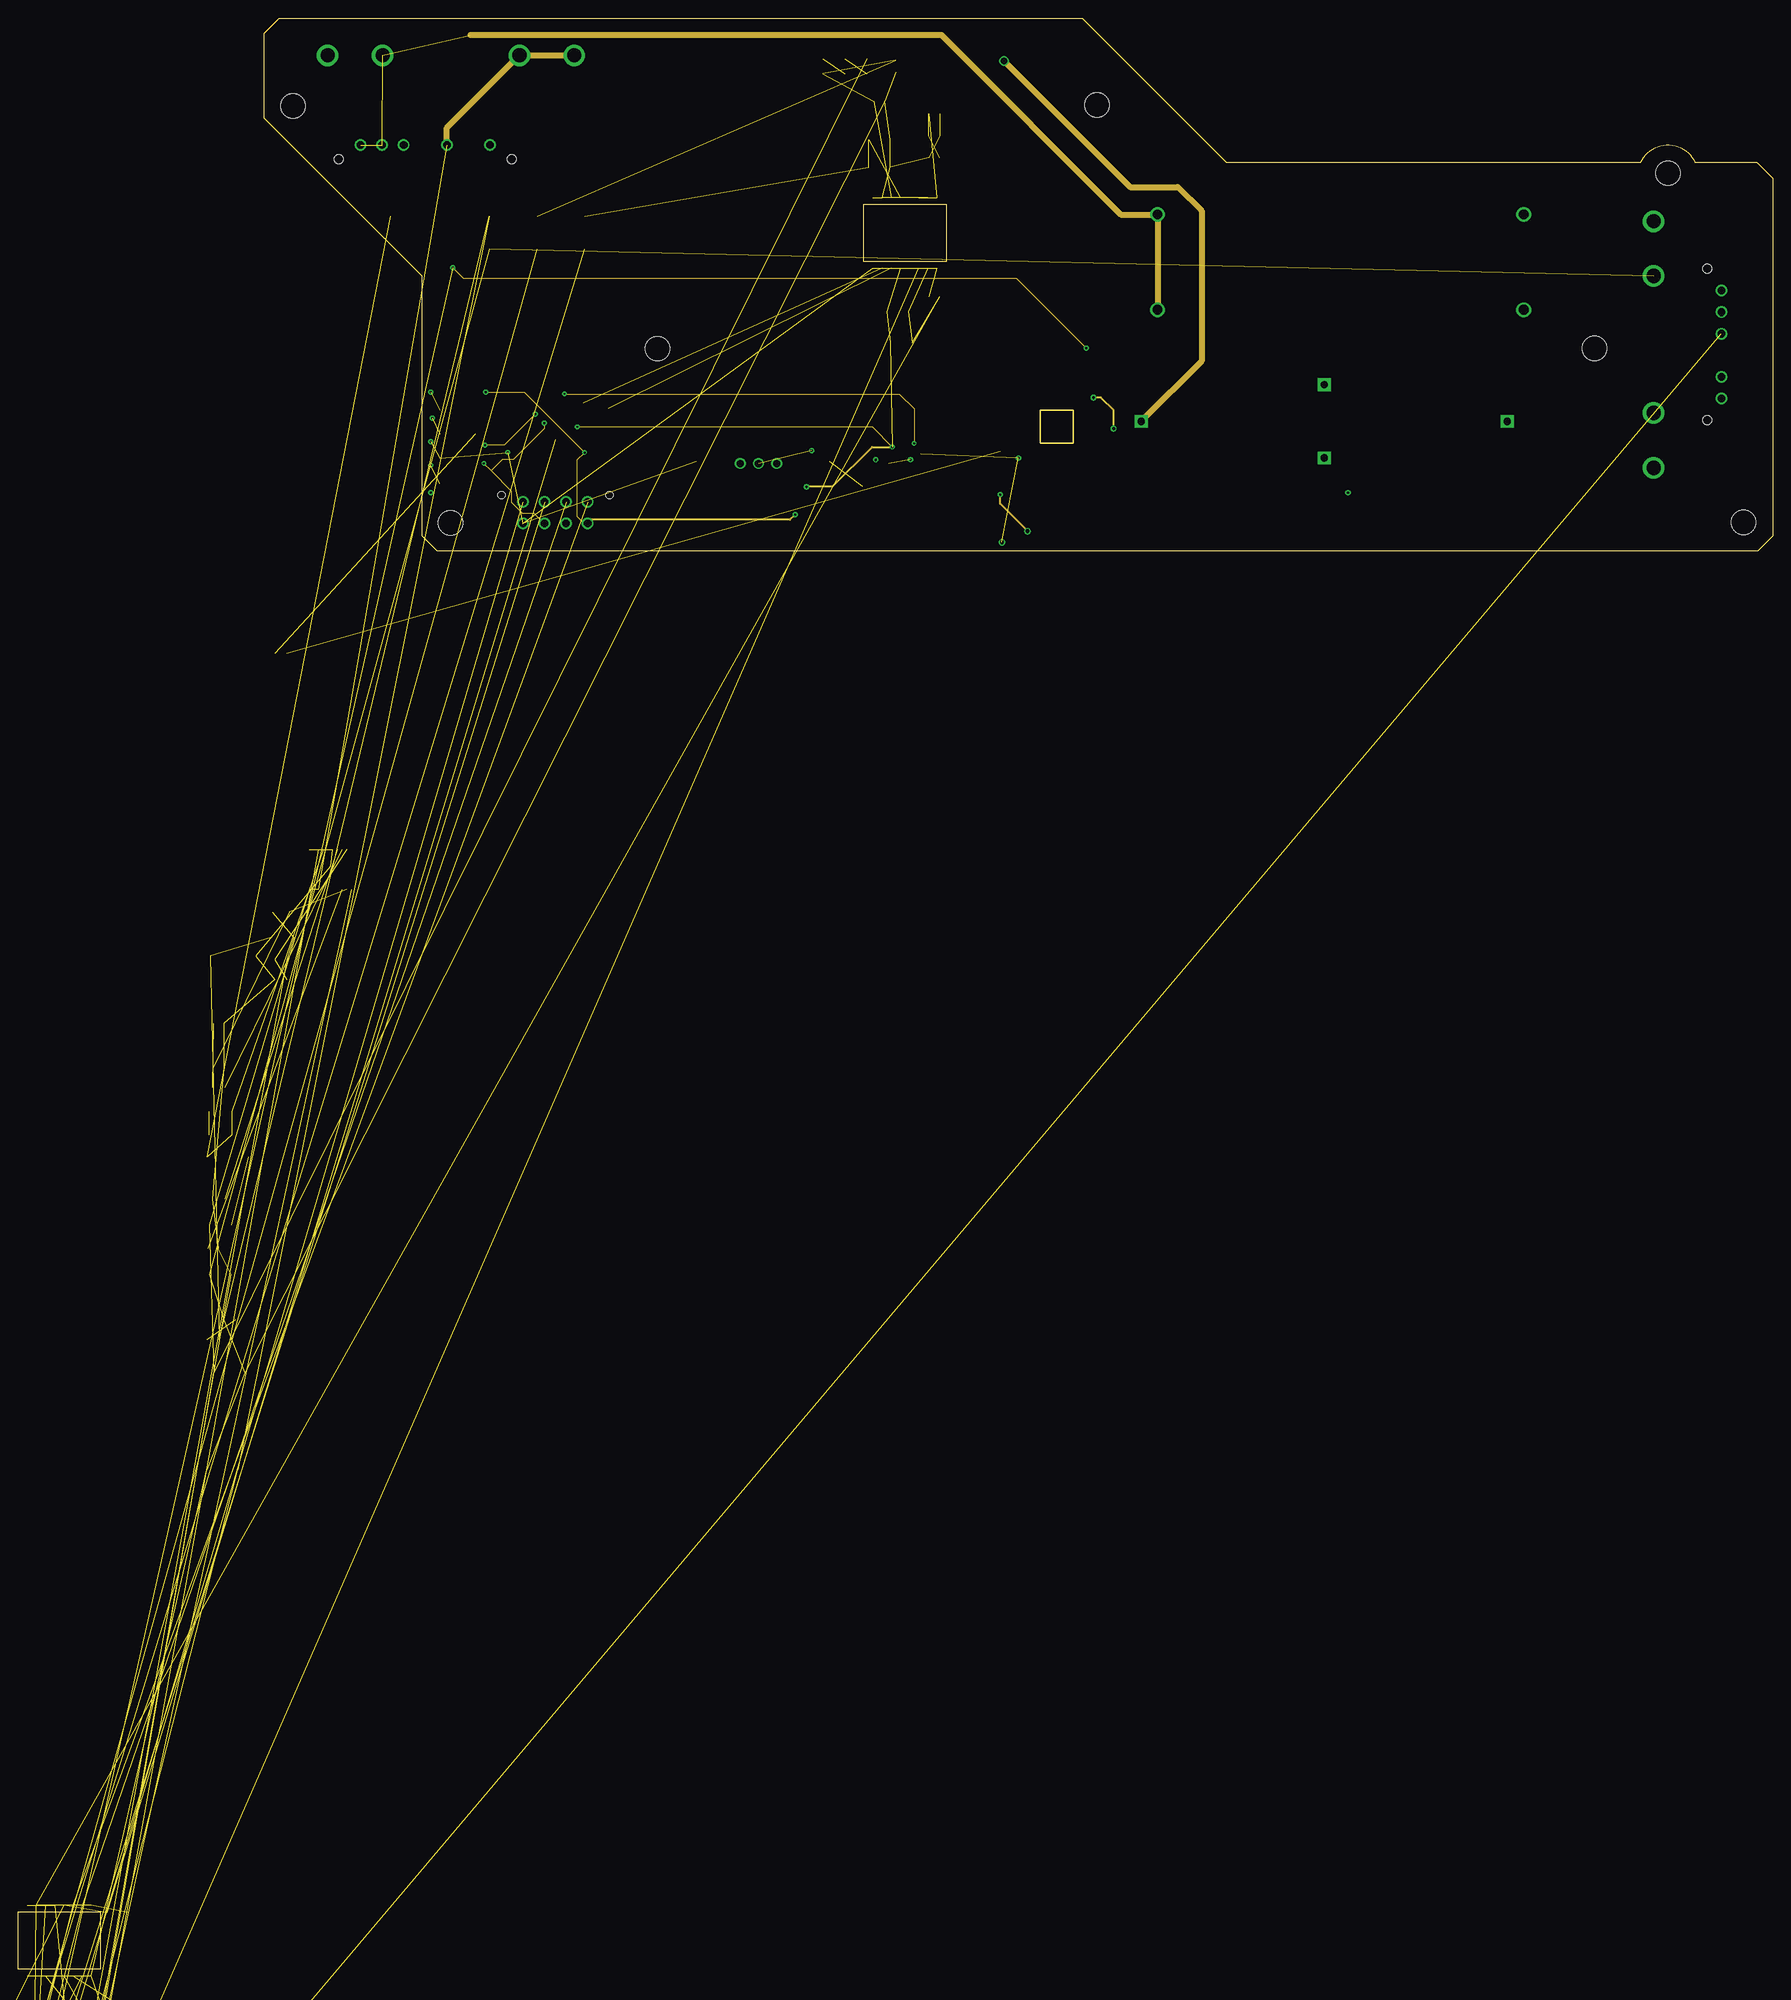
[diagram p4: board, inner layer Route2]
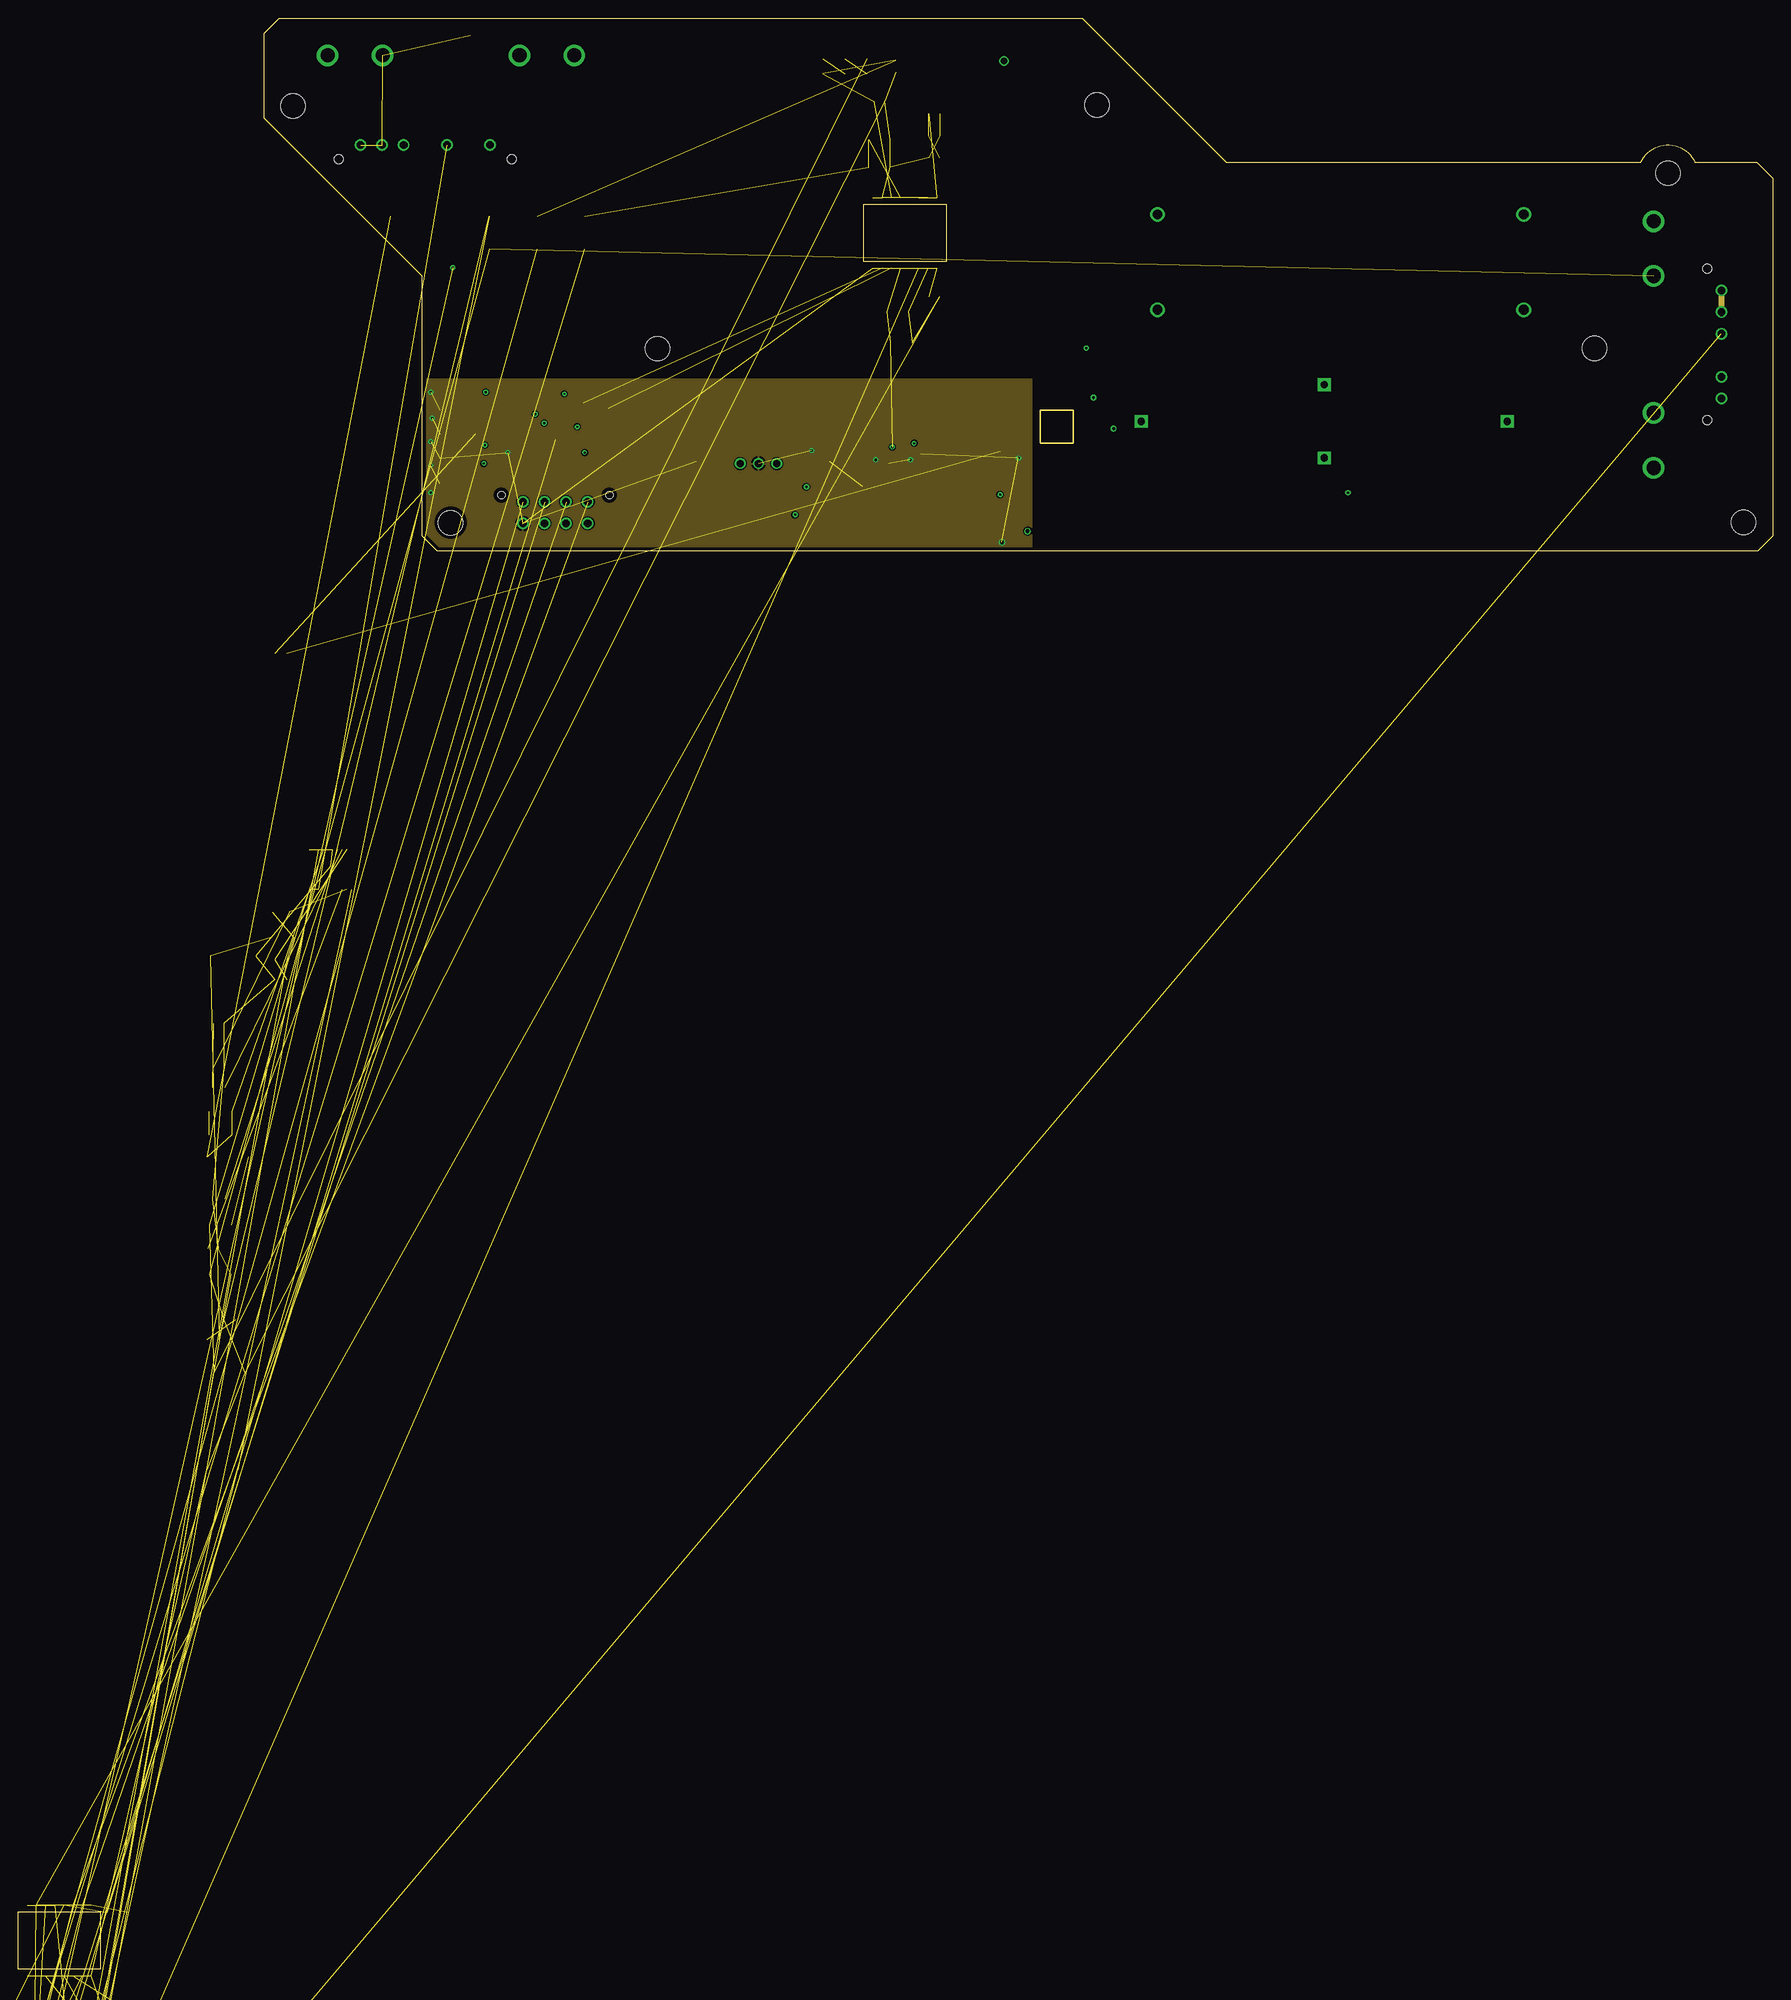
[diagram p5: board, inner layer Route15]
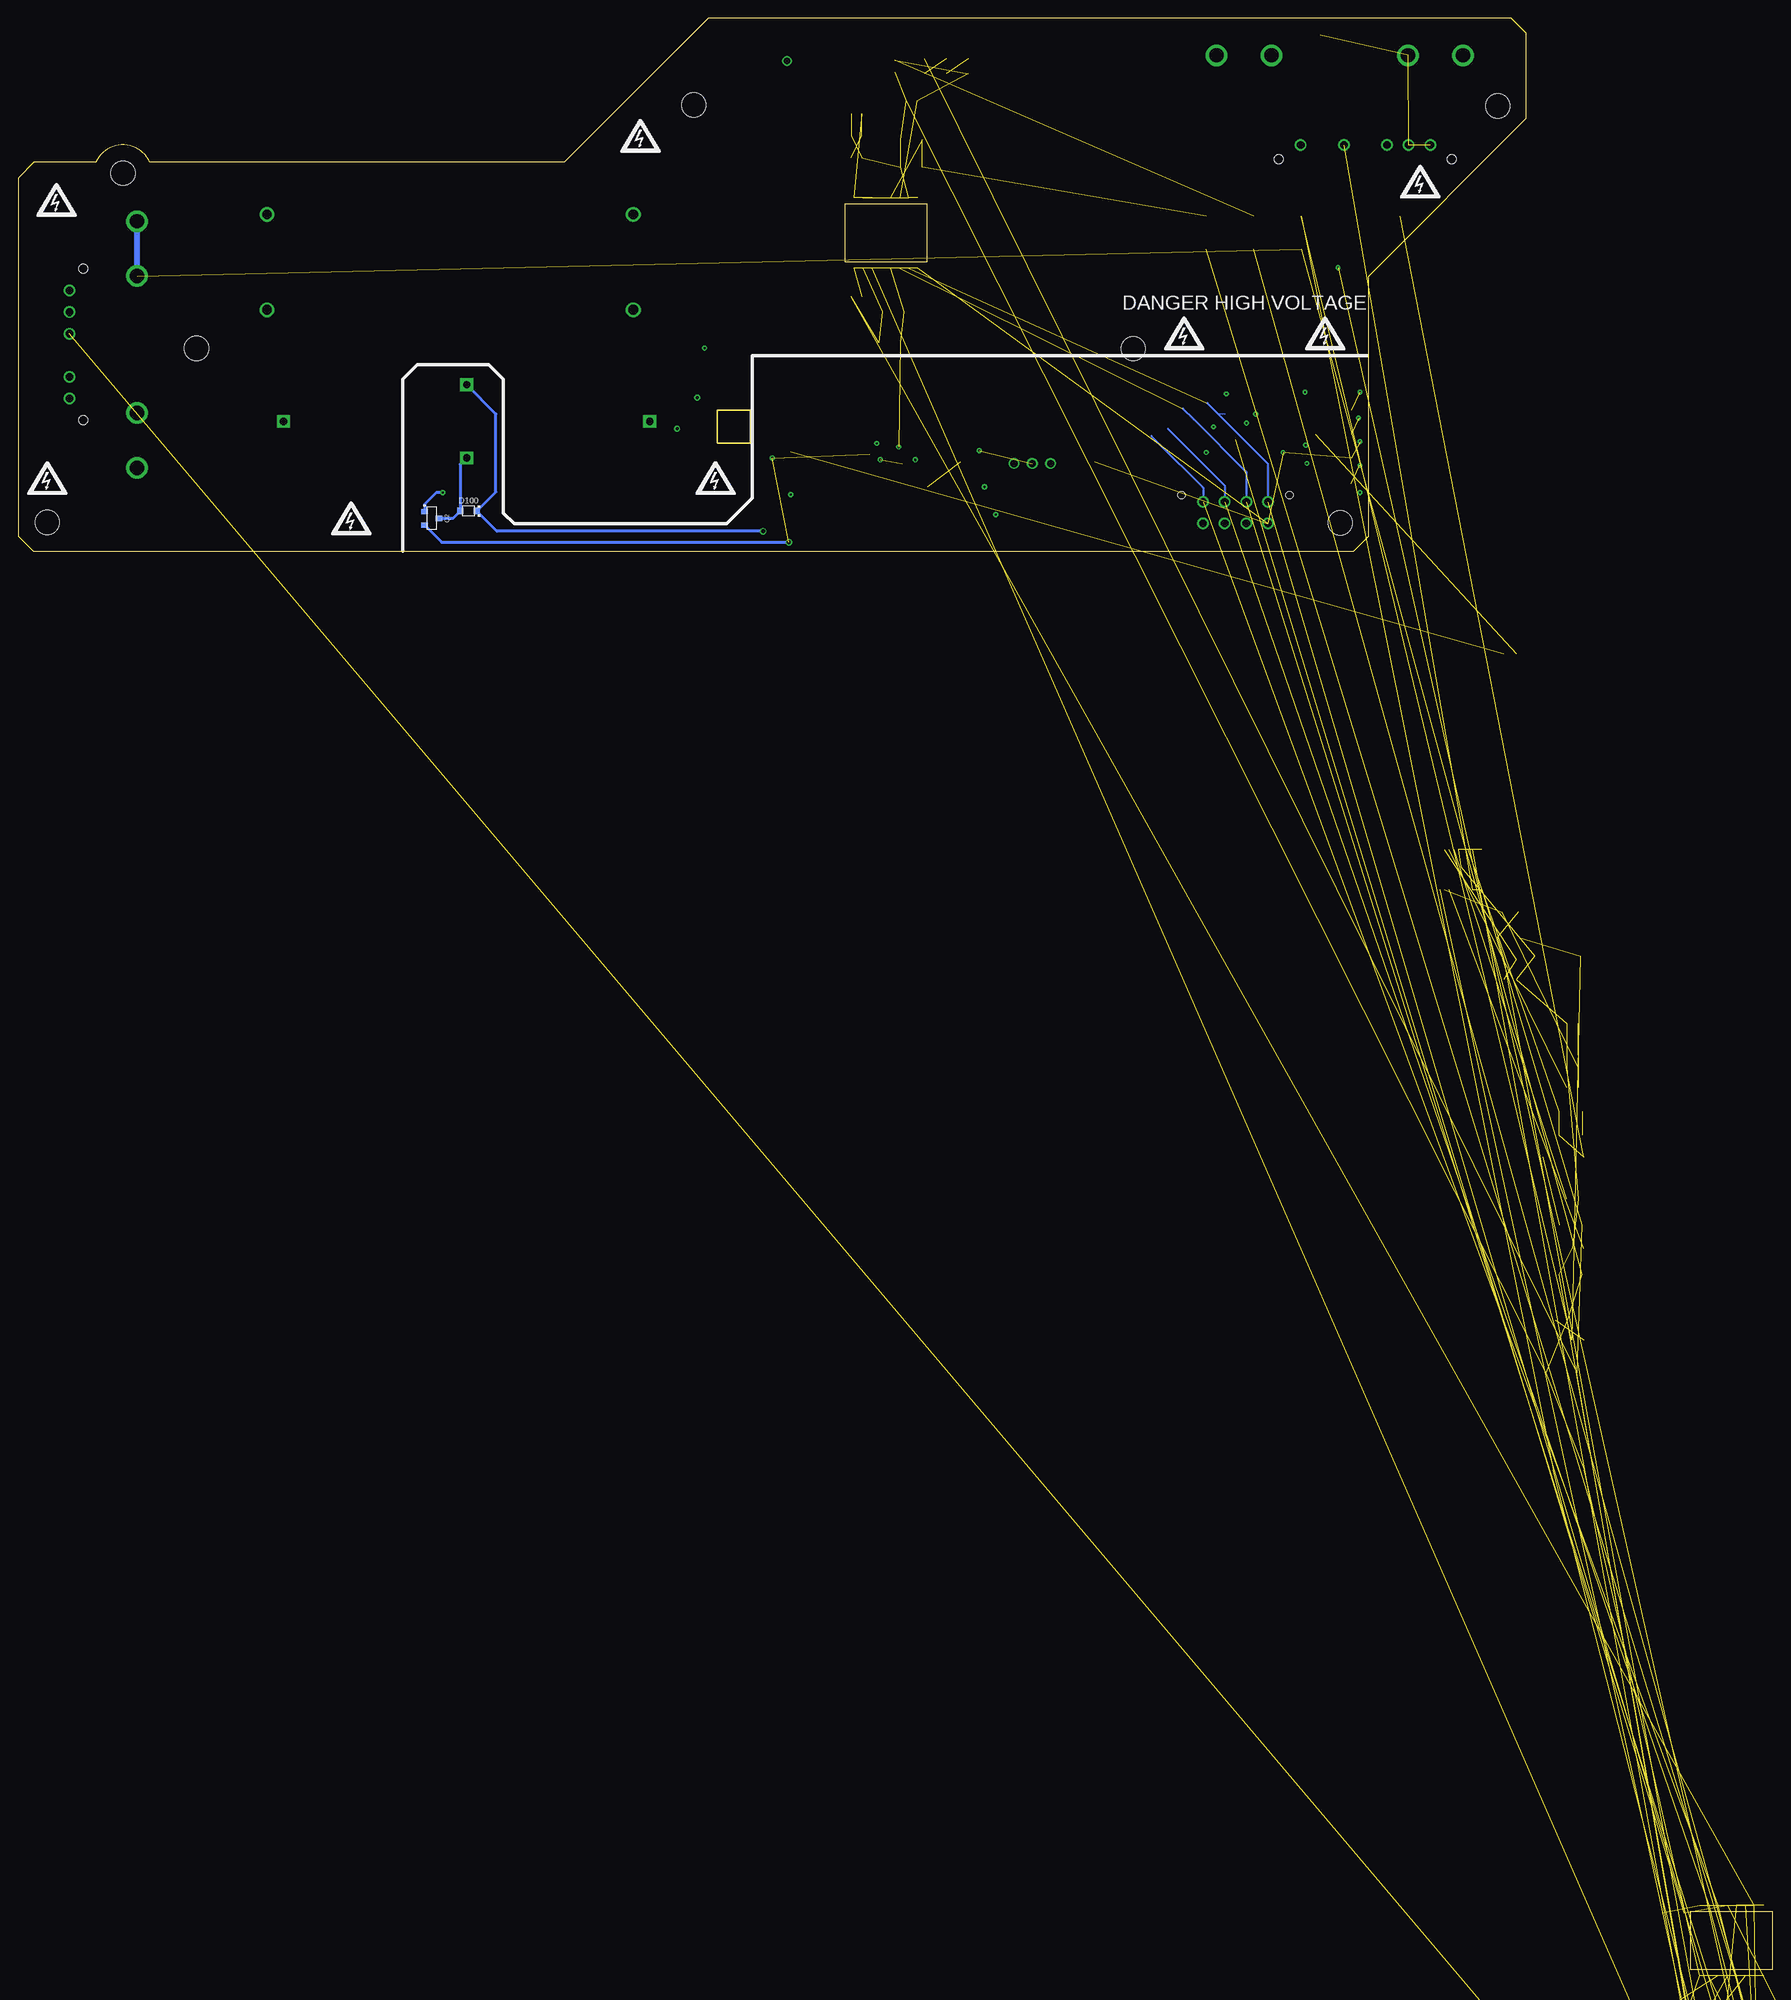
[diagram p6: board, bottom side, seen from below]

Size 209.3 x 74 mm. Coordinates in mm from the lower left corner, seen from the top.
Outline: 2.1,74 113.5,74 133.5,54 191,54 arc-130 198.5,54 207.1,54 209.3,51.8 209.3,2.1 207.2,0 24,0 21.9,2.1 21.9,38.2 0,60.1 0,71.9 2.1,74
Copper layers (1+2*15+16): Top 0.035mm / dielectric 0.2mm / Route2 0.0175mm / dielectric 1.065mm / Route15 0.0175mm / dielectric 0.2mm / Bottom 0.035mm
Design rules "HyTech Default (4 Layer)": minimum track width 6mil, minimum drill 10mil, track to track 6mil, track to pad 6mil, pad to pad 6mil, via to via 20mil, smd to smd 6mil, copper to edge 20mil, drill to drill 21mil, minimum pad ring 8mil, minimum via ring 8mil, stop-mask expansion 3mil, vias tented up to drill 30mil, thermal gap 10mil

### Footprints (pad centres in the part's own frame; a part is rotated, then mirrored left to right if it is on the bottom)
MOUNTING_M3 = hole 3.4: 0,0
5015 = smd 3.429 x 1.778: 1 0,0
OKI-78SR = drill 0.991: 1 -2.54,0; 2 0,0; 3 2.54,0
2220-CAP = smd 1.05 x 5.3: 1 -2.775,0; 2 2.775,0
0603-CAP = smd 0.9 x 0.9: 1 -0.75,0; 2 0.75,0
1206-CAP = smd 1 x 1.8: 1 -1.5,0; 2 1.5,0
1812-CAP = smd 1.6 x 3.6: 1 -2.15,0; 2 2.15,0
SOD-323 = smd 0.8 x 0.9: A -1.15,0; C 1.15,0
0603-LED = smd 0.8 x 0.8: 1 -0.825,0; 2 0.825,0
SOT-23 = smd 0.711 x 0.889: 1 -0.94,-1.003; 2 0.94,-1.003; 3 0,1.003
SOD-123FA = smd 1.2 x 1.4: A -1.55,0; C 1.55,0
SMB(DO-214AA) = smd 2.5 x 2.3: A -2.15,0; C 2.15,0
122 = drill 1.981: 1 -17.107,0; 2 -9.474,0; 3 9.5,0; 4 17.107,0
MOLEX_MICROFIT_PTH_VERTICAL_07_SINGLE_SPACED = drill 1.067: 1 -8.992,0; 2 -5.994,0; 3 -2.997,0; 4 2.997,0; 5 8.992,0 | hole 1.27: 12.002,-1.956; -12.002,-1.956
MOLEX_MICROFIT_PTH_VERTICAL_06_SINGLE_SPACED = drill 1.067: 1 -7.493,0; 2 -4.496,0; 3 -1.499,0; 4 4.496,0; 5 7.493,0 | hole 1.27: 10.503,-1.956; -10.503,-1.956
MOLEX_MICROFIT_PTH_VERTICAL_08_DUAL = drill 1.067: 1 4.496,-2.997; 2 1.499,-2.997; 3 -1.499,-2.997; 4 -4.496,-2.997; 5 4.496,0; 6 1.499,0; 7 -1.499,0; 8 -4.496,0 | hole 1.067: 7.493,0.94; -7.493,0.94
D = drill 1 pad 1.778 square: 1 -25.4,0; 2 25.4,0; 3 0,5.08; 4 0,-5.08
SRR0745A-102M = smd 1.5 x 2.4: 1 -3.15,0; 2 3.15,0
B20-SHORTENED = drill 1.35: 1 25.4,0; 2 -25.4,0
0603-RES = smd 0.9 x 0.8: 1 -0.85,0; 2 0.85,0
0805-RES = smd 0.9 x 1.2: 1 -1.05,0; 2 1.05,0
1206-RES = smd 1 x 1.5: 1 -1.6,0; 2 1.6,0
SOP-04-AIRGAP = smd 0.7 x 1.3: 1 -1.27,-3.25; 2 1.27,-3.25; 3 1.27,3.25; 4 -1.27,3.25
TSSOP-20(16) = smd 0.45 x 1.05: 1 -2.925,-2.775; 2 -2.275,-2.775; 3 -1.625,-2.775; 8 1.625,-2.775; 9 2.275,-2.775; 10 2.925,-2.775; 11 2.925,2.775; 12 2.275,2.775; 13 1.625,2.775; 14 0.975,2.775; 15 0.325,2.775; 16 -0.325,2.775; 17 -0.975,2.775; 18 -1.625,2.775; 19 -2.275,2.775; 20 -2.925,2.775 | smd 5.68 x 1.78: THERMAL 0,0.47
SOIC-16W-AIRGAP = smd 0.6 x 1.65: 1 -4.445,-4.875; 2 -3.175,-4.875; 3 -1.905,-4.875; 4 -0.635,-4.875; 5 0.635,-4.875; 6 1.905,-4.875; 7 3.175,-4.875; 8 4.445,-4.875; 9 4.445,4.875; 10 3.175,4.875; 11 1.905,4.875; 12 0.635,4.875; 13 -0.635,4.875; 14 -1.905,4.875; 15 -3.175,4.875; 16 -4.445,4.875
SOT-23-6 = smd 0.62 x 1.22: 1 -0.95,-1.31; 2 0,-1.31; 3 0.95,-1.31; 4 -0.95,1.31; 5 0,1.31; 6 0.95,1.31

### Placement (x,y rotation side)
$$U$1  [HV_MEDIUM]  14.72,51.29 0 top
$$U$2  [MOUNTING_M3]  115.55,61.95 0 top
$$U$3  [MOUNTING_M3]  4,61.8 0 top
$$U$4  [HV_MEDIUM]  122.93,57.64 0 top
$$U$5  [MOUNTING_M3]  194.75,52.45 0 top
$$U$6  [HV_MEDIUM]  203.95,48.75 0 top
$$U$8  [HV_MEDIUM]  27.93,30.21 0 top
$$U$104  [HV_MEDIUM]  27.93,30.21 0 bottom
$$U$105  [HV_MEDIUM]  203.95,48.75 0 bottom
$$U$106  [HV_MEDIUM]  122.93,57.64 0 bottom
$$U$107  [HV_MEDIUM]  14.72,51.29 0 bottom
+5V  40.38,15.48 0 top
+24V  46.98,15.73 0 top
A1  68.57,12.18 180 top
C3  -35.32,-286.02 0 top  (outside the outline)
C23  87.37,12.18 180 top
C24  59.93,11.67 90 top
C25  61.71,11.67 90 top
C26  76.7,11.67 90 top
C27  78.48,11.67 90 top
C30  -6.36,-65.55 0 top  (outside the outline)
C31  87.87,33.26 0 top
C32  -6.36,-71.64 0 top  (outside the outline)
C33  -7.12,-96.79 0 top  (outside the outline)
C35  -4.84,-114.06 0 top  (outside the outline)
C36  88.38,28.94 0 top
C37  92.95,35.29 0 top
C38  85.33,57.14 0 top
C39  85.33,53.33 0 top
C40  92.95,60.69 0 top
C41  92.95,57.64 0 top
C42  92.95,54.6 0 top
C43  85.33,62.47 0 top
C44  -20.33,-188.99 0 top  (outside the outline)
C45  -33.28,-201.69 0 top  (outside the outline)
C46  -26.68,-204.99 0 top  (outside the outline)
C47  -28.71,-201.69 0 top  (outside the outline)
C48  -24.14,-201.69 0 top  (outside the outline)
C49  -23.89,-204.99 0 top  (outside the outline)
C50  -21.09,-204.99 0 top  (outside the outline)
C51  -34.05,-208.04 0 top  (outside the outline)
C52  -31.25,-208.04 0 top  (outside the outline)
C54  -36.59,-263.41 0 top  (outside the outline)
C55  -36.59,-274.84 0 top  (outside the outline)
C56  -36.59,-278.14 0 top  (outside the outline)
D2  2.28,-50.05 0 top  (outside the outline)
D3  25.14,23.1 0 top
D4  25.14,19.54 0 top
D5  25.14,16.24 0 top
D6  25.14,12.94 0 top
D7  91.94,10.4 270 top
D8  25.14,9.38 0 top
D9  2.53,-53.61 0 top  (outside the outline)
D10  -6.11,-93.49 0 top  (outside the outline)
D11  -6.11,-100.34 0 top  (outside the outline)
D12  -5.85,-127.52 0 top  (outside the outline)
D100  146.8,5.57 0 bottom
EN/UVLO  17.52,46.47 0 top
F1  25.9,68.82 0 top
F2  192.78,28.69 90 top
GND  34.28,15.48 0 top
IP+  -34.3,-219.22 0 top  (outside the outline)
IP-  -34.3,-223.03 0 top  (outside the outline)
IT+  -34.3,-226.84 0 top  (outside the outline)
IT-  -34.3,-230.65 0 top  (outside the outline)
J1  22.34,56.37 0 top
J2  202.17,28.69 270 top
J3  40.38,6.84 0 top
K1  147.06,18.02 180 top
L1  -4.33,-56.15 0 top  (outside the outline)
LED_+12V1  -4.84,-106.69 0 top  (outside the outline)
PACK+  24.37,46.47 0 top
PACK+FUSED  24.63,41.9 0 top
PACK_HLDO  44.44,41.9 0 top
PACK_INP  37.84,41.9 0 top
PACK_ISO_DIAG  -34.05,-249.95 0 top  (outside the outline)
PRECHARGE_OK  40.38,19.8 0 top
Q2  151.88,4.56 270 bottom
R13  149.34,46.72 0 top
R15  2.28,-56.66 0 top  (outside the outline)
R18  2.28,-59.45 0 top  (outside the outline)
R20  -36.59,-253 0 top  (outside the outline)
R23  149.34,33.51 0 top
R24  115.05,25.13 90 top
R25  28.44,23.1 0 top
R26  28.44,19.54 180 top
R27  28.44,16.24 0 top
R28  91.94,13.45 0 top
R29  28.44,12.94 0 top
R30  102.1,12.94 90 top
R31  28.44,9.38 0 top
R32  83.05,8.11 270 top
R33  93.46,6.84 0 top
R34  85.33,4.56 0 top
R35  88.89,4.56 0 top
R40  -6.36,-74.44 0 top  (outside the outline)
R41  -6.87,-84.09 0 top  (outside the outline)
R42  2.28,-14.24 0 top  (outside the outline)
R45  -3.31,-84.09 0 top  (outside the outline)
R46  -6.87,-87.14 0 top  (outside the outline)
R47  -6.11,-77.74 0 top  (outside the outline)
R48  -6.11,-81.04 0 top  (outside the outline)
R49  -6.36,-89.93 0 top  (outside the outline)
R50  -7.12,-109.49 0 top  (outside the outline)
R51  -36.59,-280.94 0 top  (outside the outline)
R52  77.46,67.3 90 top
R53  80.51,67.3 90 top
R54  83.56,67.3 90 top
R55  87.62,67.3 90 top
R56  -36.59,-291.1 0 top  (outside the outline)
R57  -20.08,-201.18 0 top  (outside the outline)
R58  -33.54,-204.99 0 top  (outside the outline)
R59  -29.98,-204.99 0 top  (outside the outline)
R60  -25.16,-207.79 0 top  (outside the outline)
R61  -36.59,-294.4 0 top  (outside the outline)
SHDN  34.28,19.8 0 top
TS+12V  31.23,46.47 0 top
TS-FUSED  31.23,41.9 0 top
TS-UNFUSED  202.17,13.45 0 top
TS_HLDO  44.44,46.47 0 top
TS_INP  37.84,46.47 0 top
TS_ISO_DIAG  -34.05,-246.14 0 top  (outside the outline)
U5  109.97,17.26 270 top
U6  9.13,-44.21 0 top  (outside the outline)
U7  88.89,44.18 180 top
U8  -28.46,-192.8 0 top  (outside the outline)
U10  87.37,8.37 270 top
U$7  [DANGER_HIGH_VOLTAGE]  39.11,34.53 0 top
U$9  [HV_MEDIUM]  47.49,30.21 0 top
U$10  [LOGO_HYTECH_MEDIUM]  56.42,83.11 0 top  (outside the outline)
U$11  [MOUNTING_M3]  184.55,28.15 0 top
U$12  [MOUNTING_M3]  54.55,28.1 0 top
U$13  [HV_MEDIUM]  205.22,10.15 0 top
U$14  [HV_MEDIUM]  112.51,10.15 0 top
U$15  [HV_MEDIUM]  163.06,4.56 0 top
U$16  [MOUNTING_M3]  205.25,4 0 top
U$17  [MOUNTING_M3]  25.85,3.95 0 top
U$18  [LOGO_GT_MEDIUM]  189.73,5.32 0 top
U$100  [HV_MEDIUM]  163.06,4.56 0 bottom
U$101  [HV_MEDIUM]  112.51,10.15 0 bottom
U$102  [HV_MEDIUM]  205.22,10.15 0 bottom
U$103  [HV_MEDIUM]  47.49,30.21 0 bottom

### Tracks (layer width: path | path; a pad name or v marks a point on that pad's centre or on a via)
+5V  (via drill 0.25, 0.35)  (6 unrouted)
  Top 0.152: v43.42,17.26 42.15,17.26 +5V.1 38.34,15.48 36.82,17 36.82,20.81 36.31,21.32 31.07,21.32 R26.1
  Top 0.254: R35.2 89.94,7.57 89.14,8.37 U10.5 87.87,8.37 87.62,8.62 87.62,11.68 C23.1 88.12,14.2 88.13,14.21 | 88.13,14.21 89.91,15.99 95.24,15.99 102.35,15.99 105.15,18.78 105.15,19.79 | v87.11,14.46 87.87,14.46 88.13,14.21 | C24.1 C25.1 63.5,10.92 64.76,12.18 A1.3 69.33,8.88 75.14,8.88 v75.2,8.94
  Route2 0.152: v43.42,17.26 84.32,17.26 v87.11,14.46
  Route2 0.254: v75.2,8.94 78.79,8.94 84.32,14.46 v87.11,14.46
+24V  (via drill 0.25, 0.3)
  Top 0.152: v44.44,13.7 46.47,15.73 +24V.1 | R25.2 30.3,22.08 v30.72,22.08
  Top 0.254: C26.1 76.7,8.11 v73.65,5.07 | C26.1 72.37,10.92 A1.1 | C26.1 C27.1
  Route2 0.152: v30.72,22.08 36.06,22.08 v44.44,13.7 43.42,12.69 43.42,4.79 44.36,3.85 J3.1
  Route2 0.254: v73.65,5.07 72.94,4.36 45.38,4.36 J3.1
AIL+  (1 unrouted)
DCDC_ENABLE  (via drill 0.25)
  Top 0.152: v90.16,14.97 91.26,14.97 R28.2 | v41.65,21.83 38.6,21.83 37.58,20.81 v37.58,19.04 | v30.62,14.72 29.2,14.72 28.44,13.96 28.44,10.23 R31.2
  Top 0.254: D7.3 92.61,10.07 R33.1 | D7.3 92.94,13.3 R28.2 | D7.3 89.76,10.4 U10.4
  Route2 0.152: v41.65,21.83 88.13,21.83 90.16,19.8 v90.16,14.97 | v37.58,19.04 33.26,14.72 v30.62,14.72
EN/UVLO  (4 unrouted)
GND  (via drill 0.25, 0.3, 0.51)  (22 unrouted)
  Top 0.152: D3.1 24.12,23.1 v23.1,22.08 | D6.1 24.12,12.94 v23.1,11.92 | D5.1 24.12,16.24 v23.1,15.22 | D4.1 23.3,18.53 v23.3,18.47 | GND.1 33.77,14.97 v33.77,13.7 | D8.1 24.31,9.32 v23.1,8.11
  Top 0.254: 86.86,8.37 U10.2 83.64,8.37 R32.1 | 86.86,8.37 87.11,8.62 87.11,11.68 C23.2 85.33,12.18 v84.83,12.69 | 86.86,8.37 87.11,8.11 87.11,6.84 86.1,5.83 85.33,5.83 84.28,4.78 R34.1 | D7.1 90.94,13.3 R28.1 90.41,13.45 v89.65,12.69 | v75.94,13.96 76.19,13.7 76.19,12.93 C26.2 C27.2 | v104.64,12.94 104.64,13.9 U5.2 | C24.2 C25.2 62.74,13.45 66.54,13.45 67.81,12.18 A1.2
  Bottom 0.406: Q2.2 150.52,1.26 v102.35,1.26
  pour Route15: 21.88,23.86 106.42,23.86 106.42,-0.25 21.88,-0.25
IP+  (2 unrouted)
  Bottom 0.254: 52.06,15.99 51.17,15.1 44.87,8.8 J3.5
IP-  (2 unrouted)
  Bottom 0.254: 49.77,17 41.88,9.11 J3.6
IT+  (2 unrouted)
  Bottom 0.254: 47.69,19.8 46.19,18.3 38.88,10.98 J3.7
IT-  (2 unrouted)
  Bottom 0.152: 42.84,19.11 41.82,19.11
  Bottom 0.254: 44.29,20.56 42.84,19.11 35.88,12.15 J3.8
N$2
  Top 0.152: R27.1 D5.2
N$3  (via drill 0.3)
  Top 0.406: v150.36,8.11 144.52,2.27 108.96,2.27 104.38,6.84 R33.2
  Bottom 0.406: v150.36,8.11 151.29,8.11 152.89,6.51 Q2.1
N$10
  Top 0.254: R32.2 85.9,7.26 U10.3
N$11
  Top 0.254: R34.2 R35.1 88.68,5.39 U10.6
N$22
  Top 0.152: R29.1 D6.2
N$24
  Top 0.152: R31.1 D8.2
N$25
  Top 0.152: R25.1 D3.2
N$30
  Top 0.152: R26.2 D4.2
N$33  (2 unrouted)
N$34  (1 unrouted)
N$35  (1 unrouted)
N$36  (1 unrouted)
N$37  (1 unrouted)
N$38  (1 unrouted)
N$40
  Bottom 0.406: K1.3 147.95,12.04 D100.A 148.97,4.56 Q2.3
N$41  (1 unrouted)
N$43  (1 unrouted)
N$44  (1 unrouted)
N$45  (1 unrouted)
N$46  (1 unrouted)
N$47  (1 unrouted)
N$49  (2 unrouted)
N$50
  Top 0.813: R13.1 R23.1 174.74,20.31 K1.1
N$51  (4 unrouted)
N$52  (2 unrouted)
N$53  (1 unrouted)
  Top 0.254: R30.2 106.72,18.41 U5.1
N$54  (2 unrouted)
N$55  (3 unrouted)
N$57  (via drill 0.38)
  Top 0.254: U5.3 116.83,15.99 v117.85,17 | v115.05,21.32 R24.1
  Route2 0.254: v117.85,17 117.85,19.54 116.07,21.32 v115.05,21.32
N$59  (1 unrouted)
N$60  (1 unrouted)
N$64  (4 unrouted)
N$65  (1 unrouted)
N$66  (1 unrouted)
PACK+  (via drill 0.89)
  Top 0.152: J1.5 31.33,56.12 31.33,51.65 30.22,50.53 26.15,50.53 24.37,48.75 PACK+.1
  Top 0.254: U5.4 121.15,18.53 K1.2
  Top 0.813: v102.61,68.06 100.32,70.34 50.28,70.34 48,72.63 31.23,72.63 28.69,70.09 28.69,58.76 31.33,56.12
  Route2 0.813: v102.61,68.06 120.13,50.53 126.74,50.53 130.04,47.23 130.04,26.4 K1.2
PACK+FUSED  (via drill 0.25)  (1 unrouted)
  Top 0.152: R24.2 115.05,27.16 v114.04,28.18 | v26.15,39.36 24.63,40.88 PACK+FUSED.1
  Route2 0.152: v114.04,28.18 104.38,37.83 27.68,37.83 v26.15,39.36
PACK_HLDO_OUT  (3 unrouted)
PACK_INP  (4 unrouted)
PACK_ISO_DIAG  (1 unrouted)
PRECHARGE_OK  (via drill 0.25)
  Top 0.152: PRECHARGE_OK.1 40.38,19.29 v38.85,17.77 | v30.47,12.18 29.71,12.94 R29.2
  Top 0.254: U10.1 85.23,10.15 81.27,10.15 74.41,3.29 50.79,3.29 49.01,5.07 40.1,5.07 J3.3
  Route2 0.152: 31.49,11.16 v30.47,12.18 | v38.85,17.77 38.85,17 34.53,12.69 33.01,12.69 31.49,11.16 | 31.49,11.16 34.28,8.37 34.28,6.84 35.8,5.32 37.4,5.32 J3.3
SHDN  (via drill 0.3, 0.51)  (1 unrouted)
  Top 0.152: 31.74,17.26 31.74,3.8 33.26,2.27 40.3,2.27 J3.2 | 31.74,17.26 30.72,16.24 R27.2 | 31.74,17.26 SHDN.1
  Top 0.254: v102.1,7.86 R30.1
  Top 0.406: 43.45,2.27 105.4,2.27 v105.91,2.78
  Top 0.508: 43.45,2.27 J3.2
  Route2 0.254: v105.91,2.78 102.1,6.59 v102.1,7.86
  Bottom 0.406: v105.91,2.78 142.86,2.78 D100.C 142.99,8.23 142.99,19.04 K1.4
TS+12V  (6 unrouted)
TS+FUSED  (7 unrouted)
  Route2 0.813: J1.4 25.34,58.76 F1.3 F1.4
TS+UNFUSED  (3 unrouted)
  Top 0.813: F1.1 F1.2
  Route2 0.813: 28.59,71.61 93.97,71.61 118.86,46.72 R13.2 R23.2
TS-FUSED  (28 unrouted)
  Top 0.813: J2.1 194.78,36.18 F2.3
  Route15 0.813: J2.1 J2.2
  Bottom 0.813: F2.3 F2.4
TS-FUSED1  (13 unrouted)
TS-UNFUSED
  Top 0.254: TS-UNFUSED.1 J2.5
  Top 0.813: J2.5 194.76,21.2 F2.2 F2.1
TS_HLDO_OUT  (3 unrouted)
TS_INP  (4 unrouted)
TS_ISO_DIAG  (1 unrouted)

### Text on the board
tPlace: Tractive System Board rev7 / Designed by Ethan Su, Liwei Sun, / Cody Kaminsky | +24V | +5V | SHDN | PRECHARGE_OK | DCDC_ENABLE